# EAGLE board hw_DAA (EAGLE 7.6.0), part 1 of 9
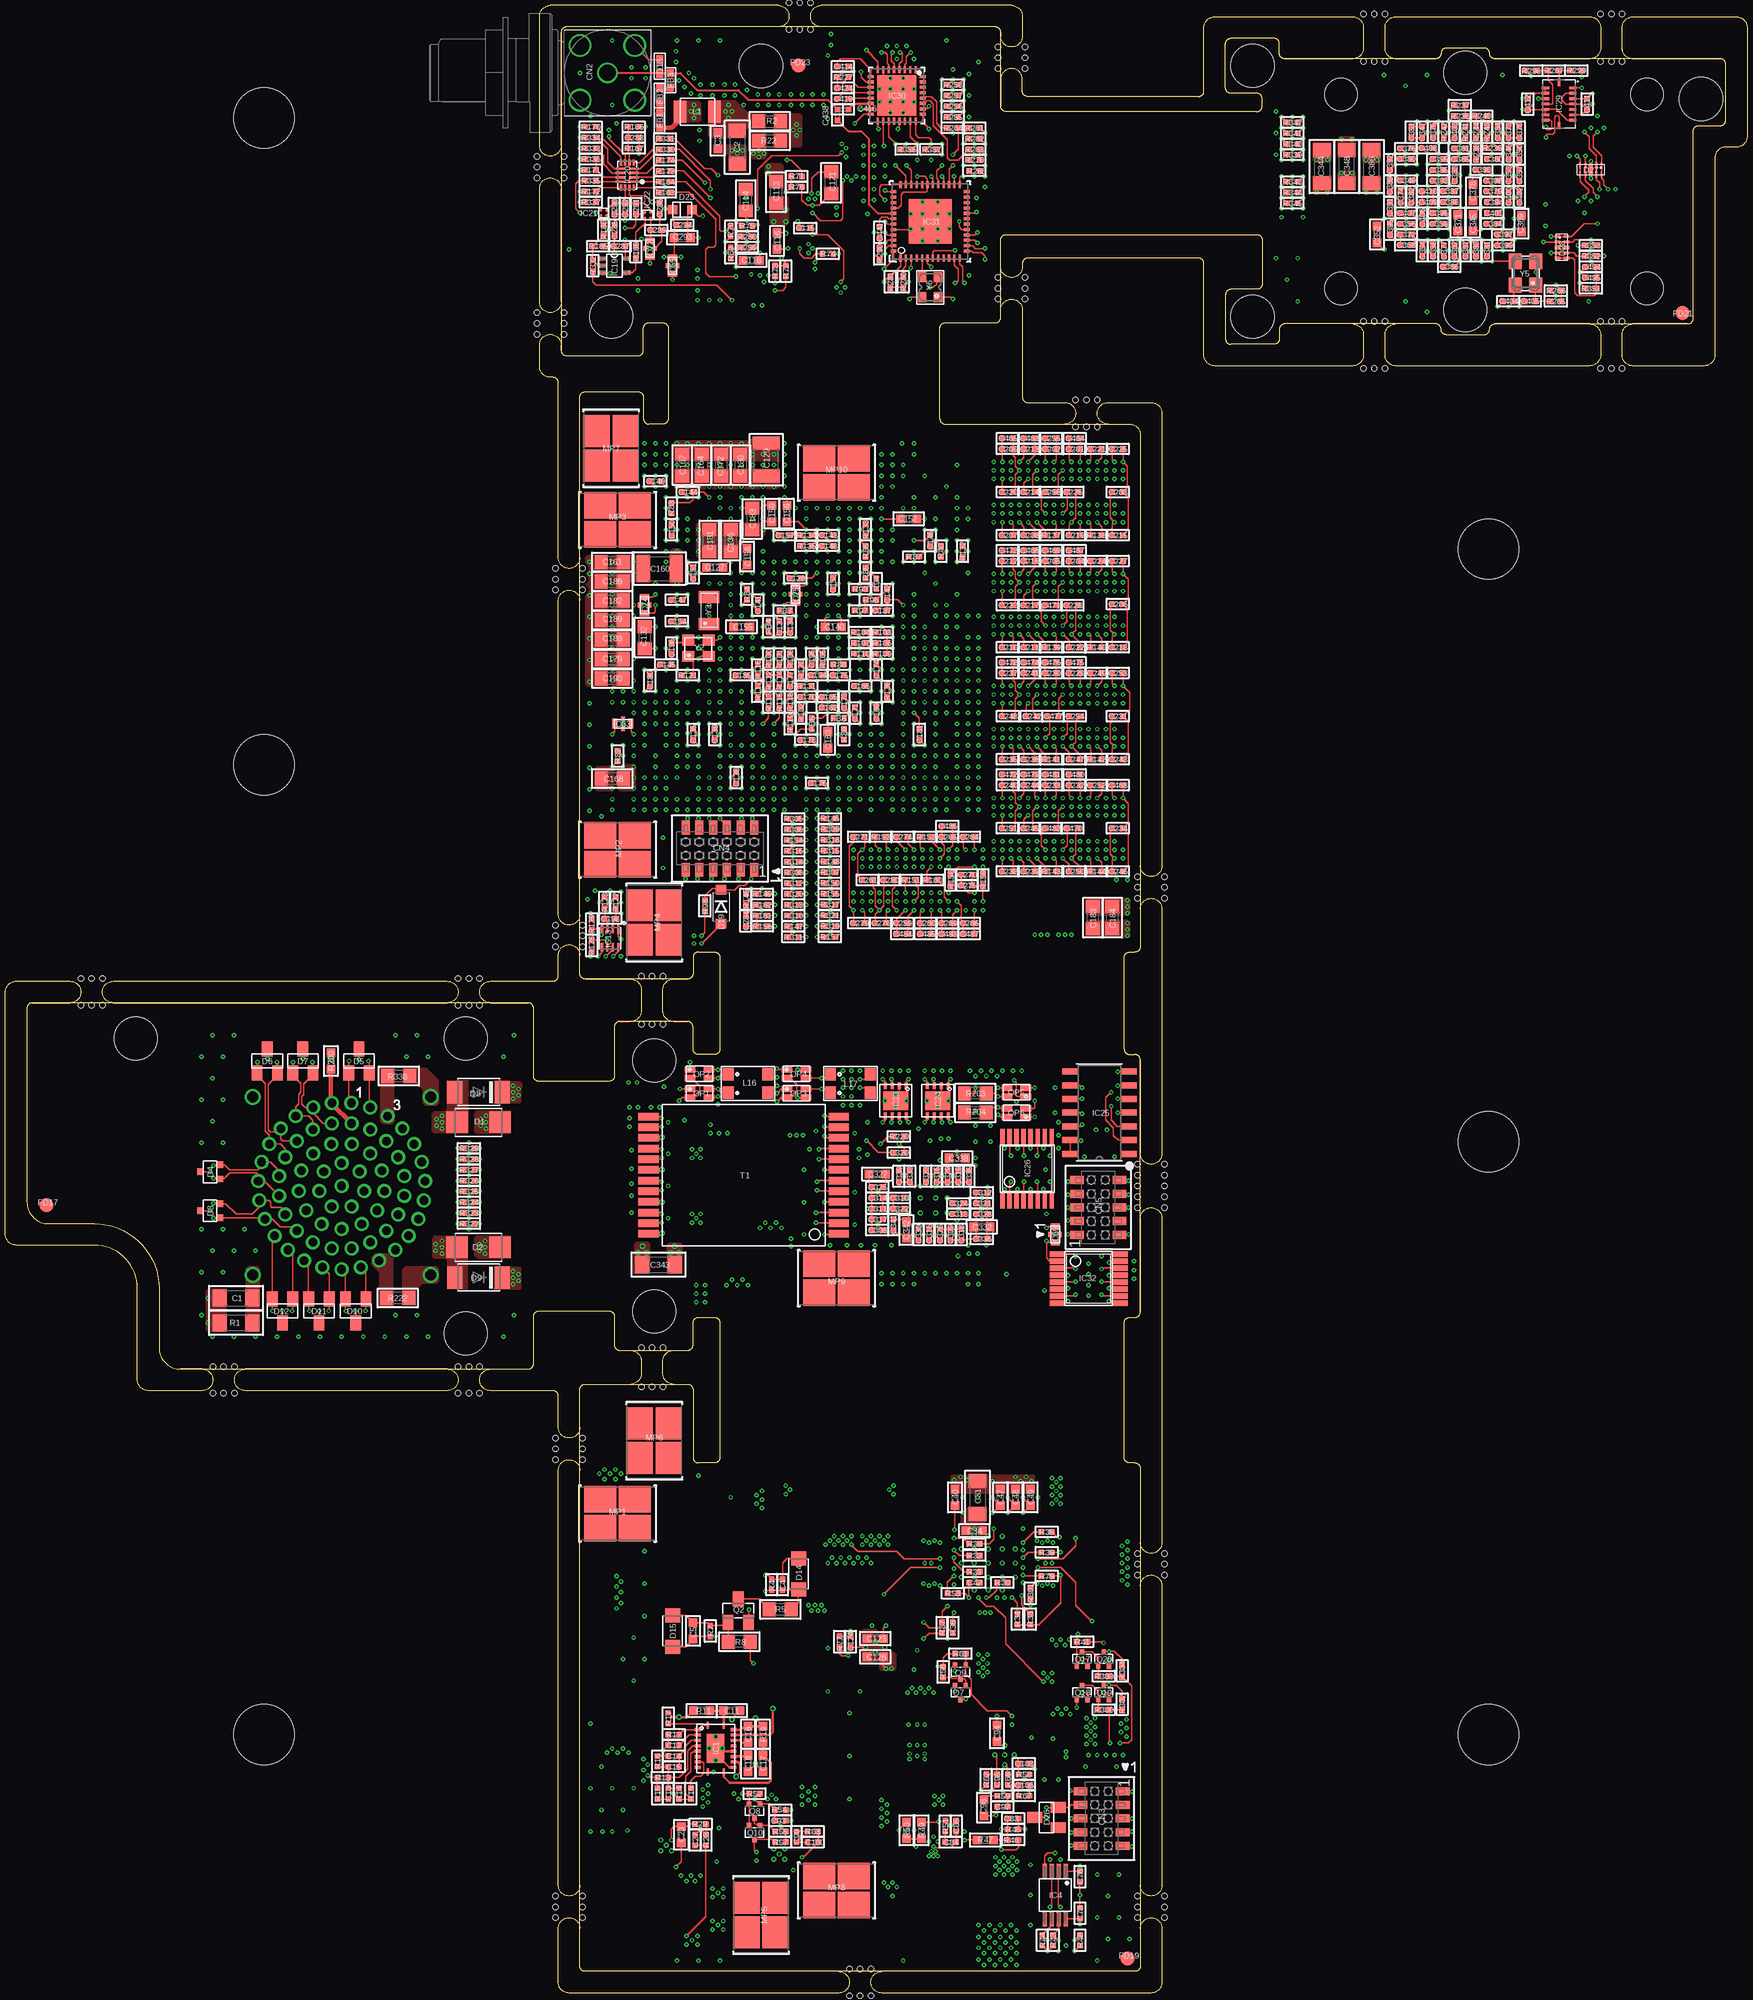
[diagram p34: board, top side]
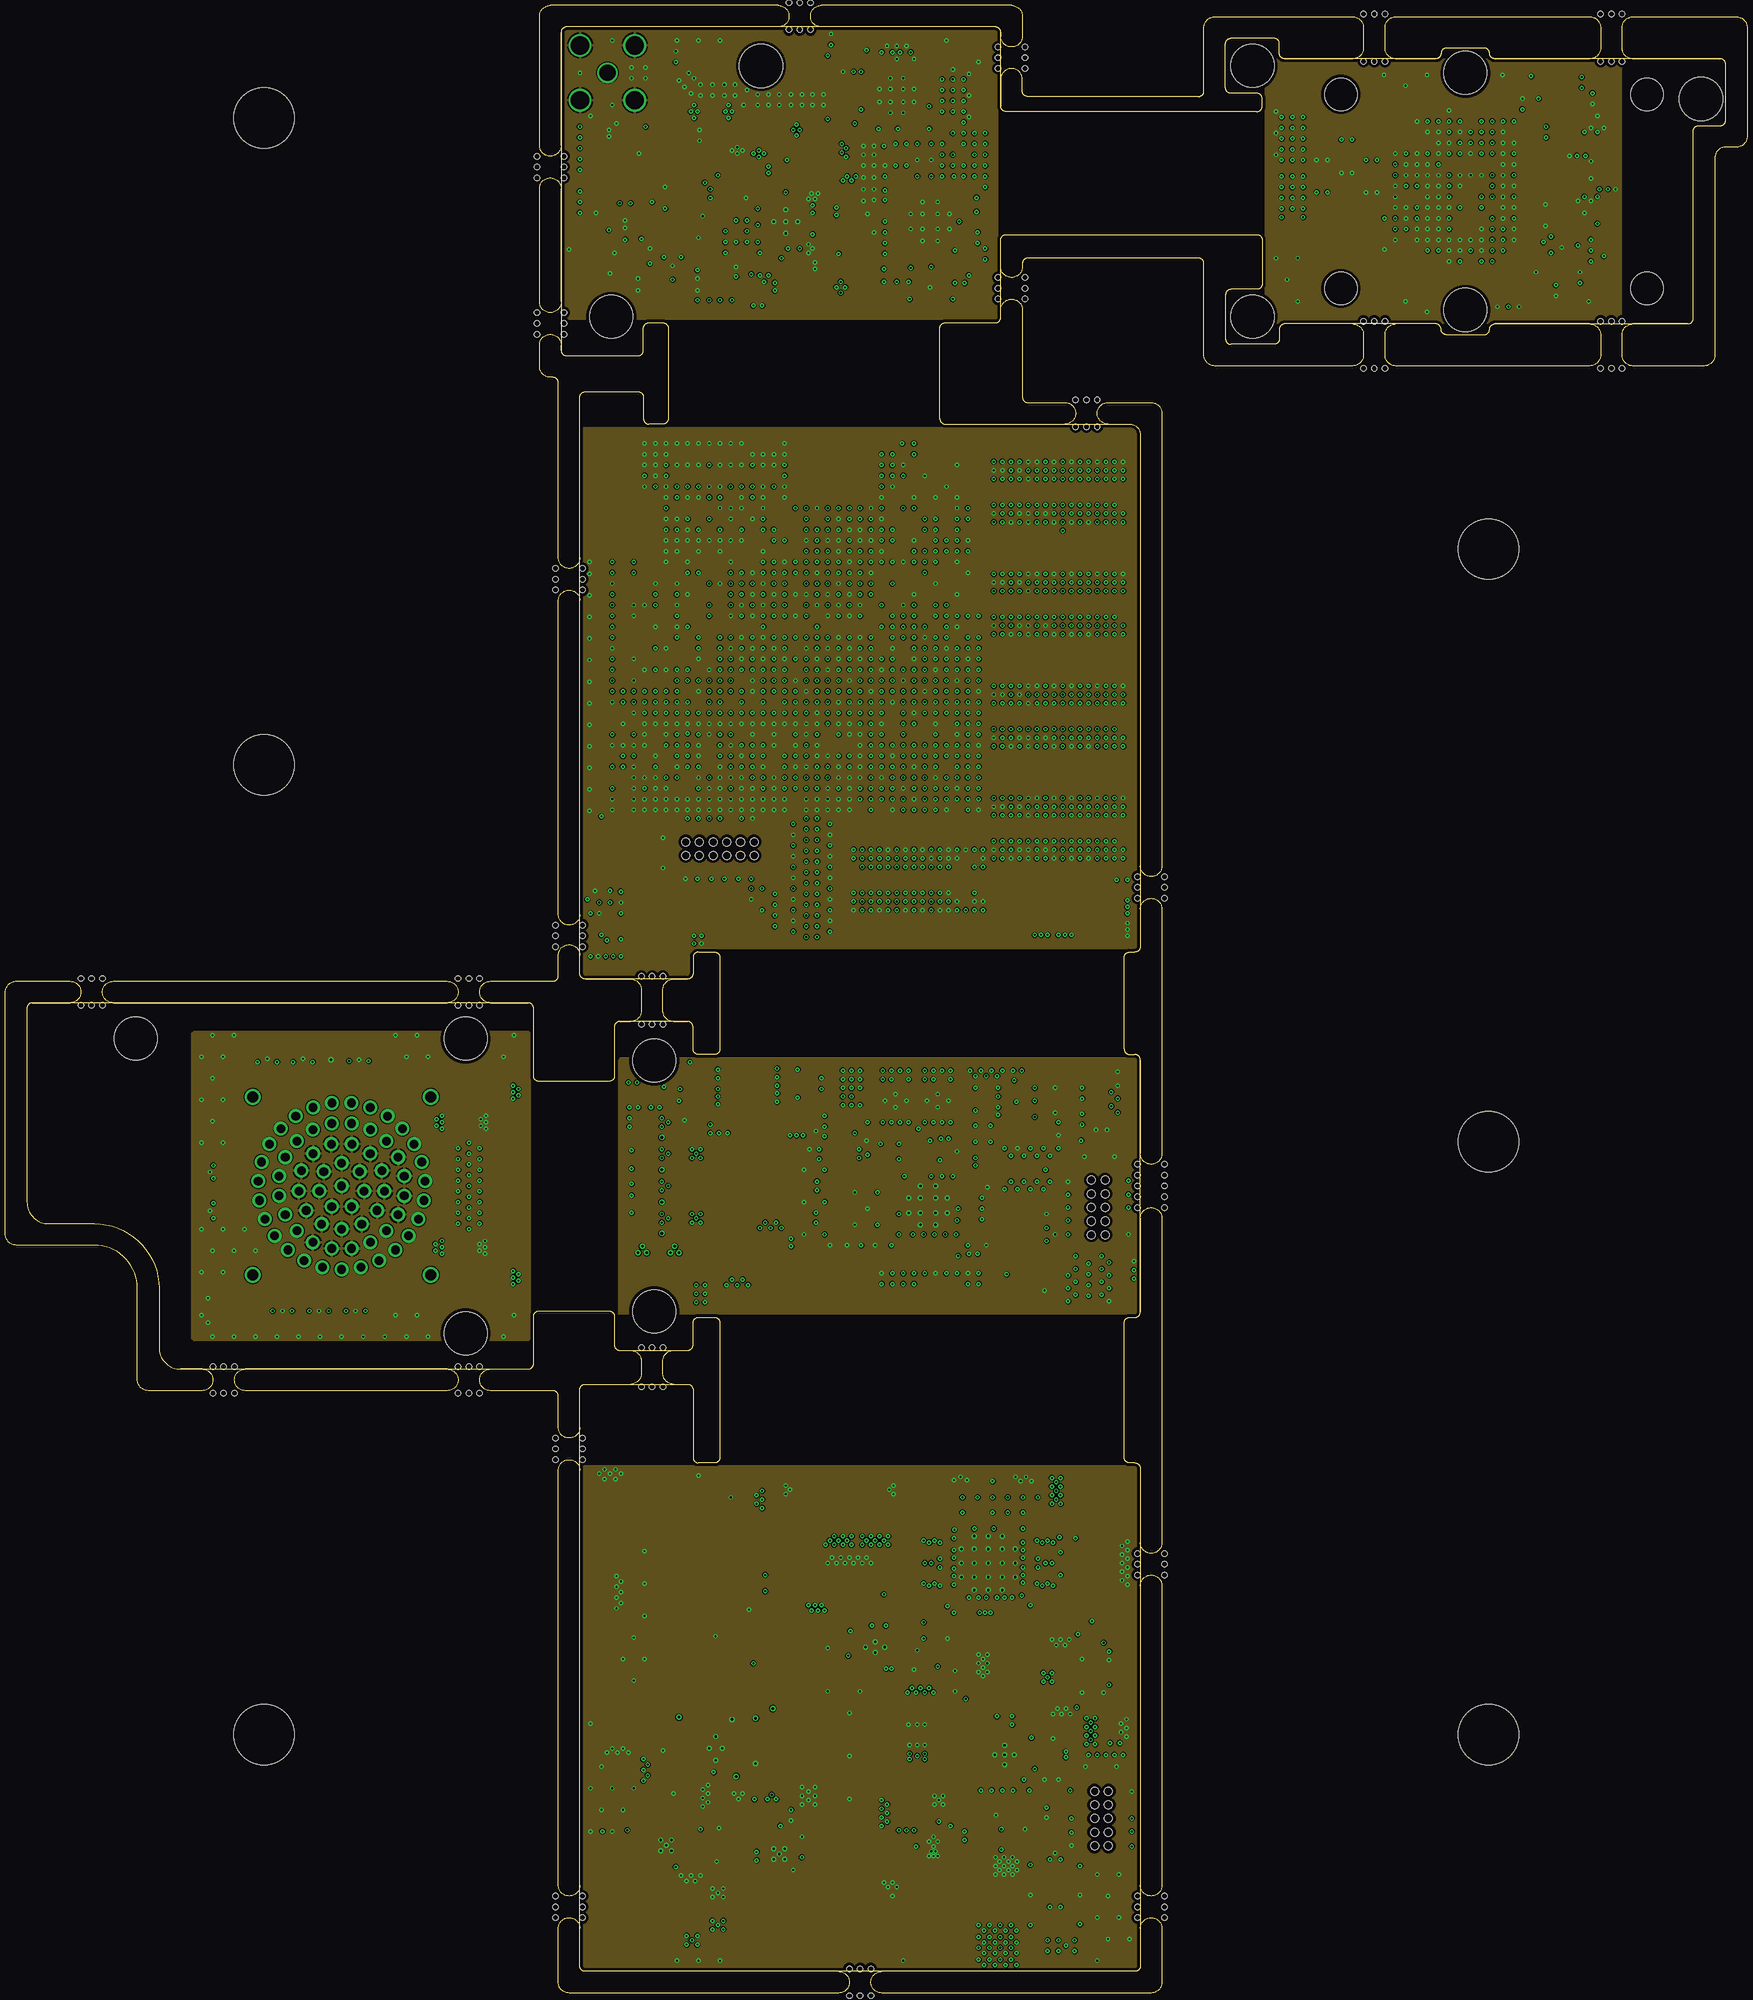
[diagram p35: board, inner layer GND2]
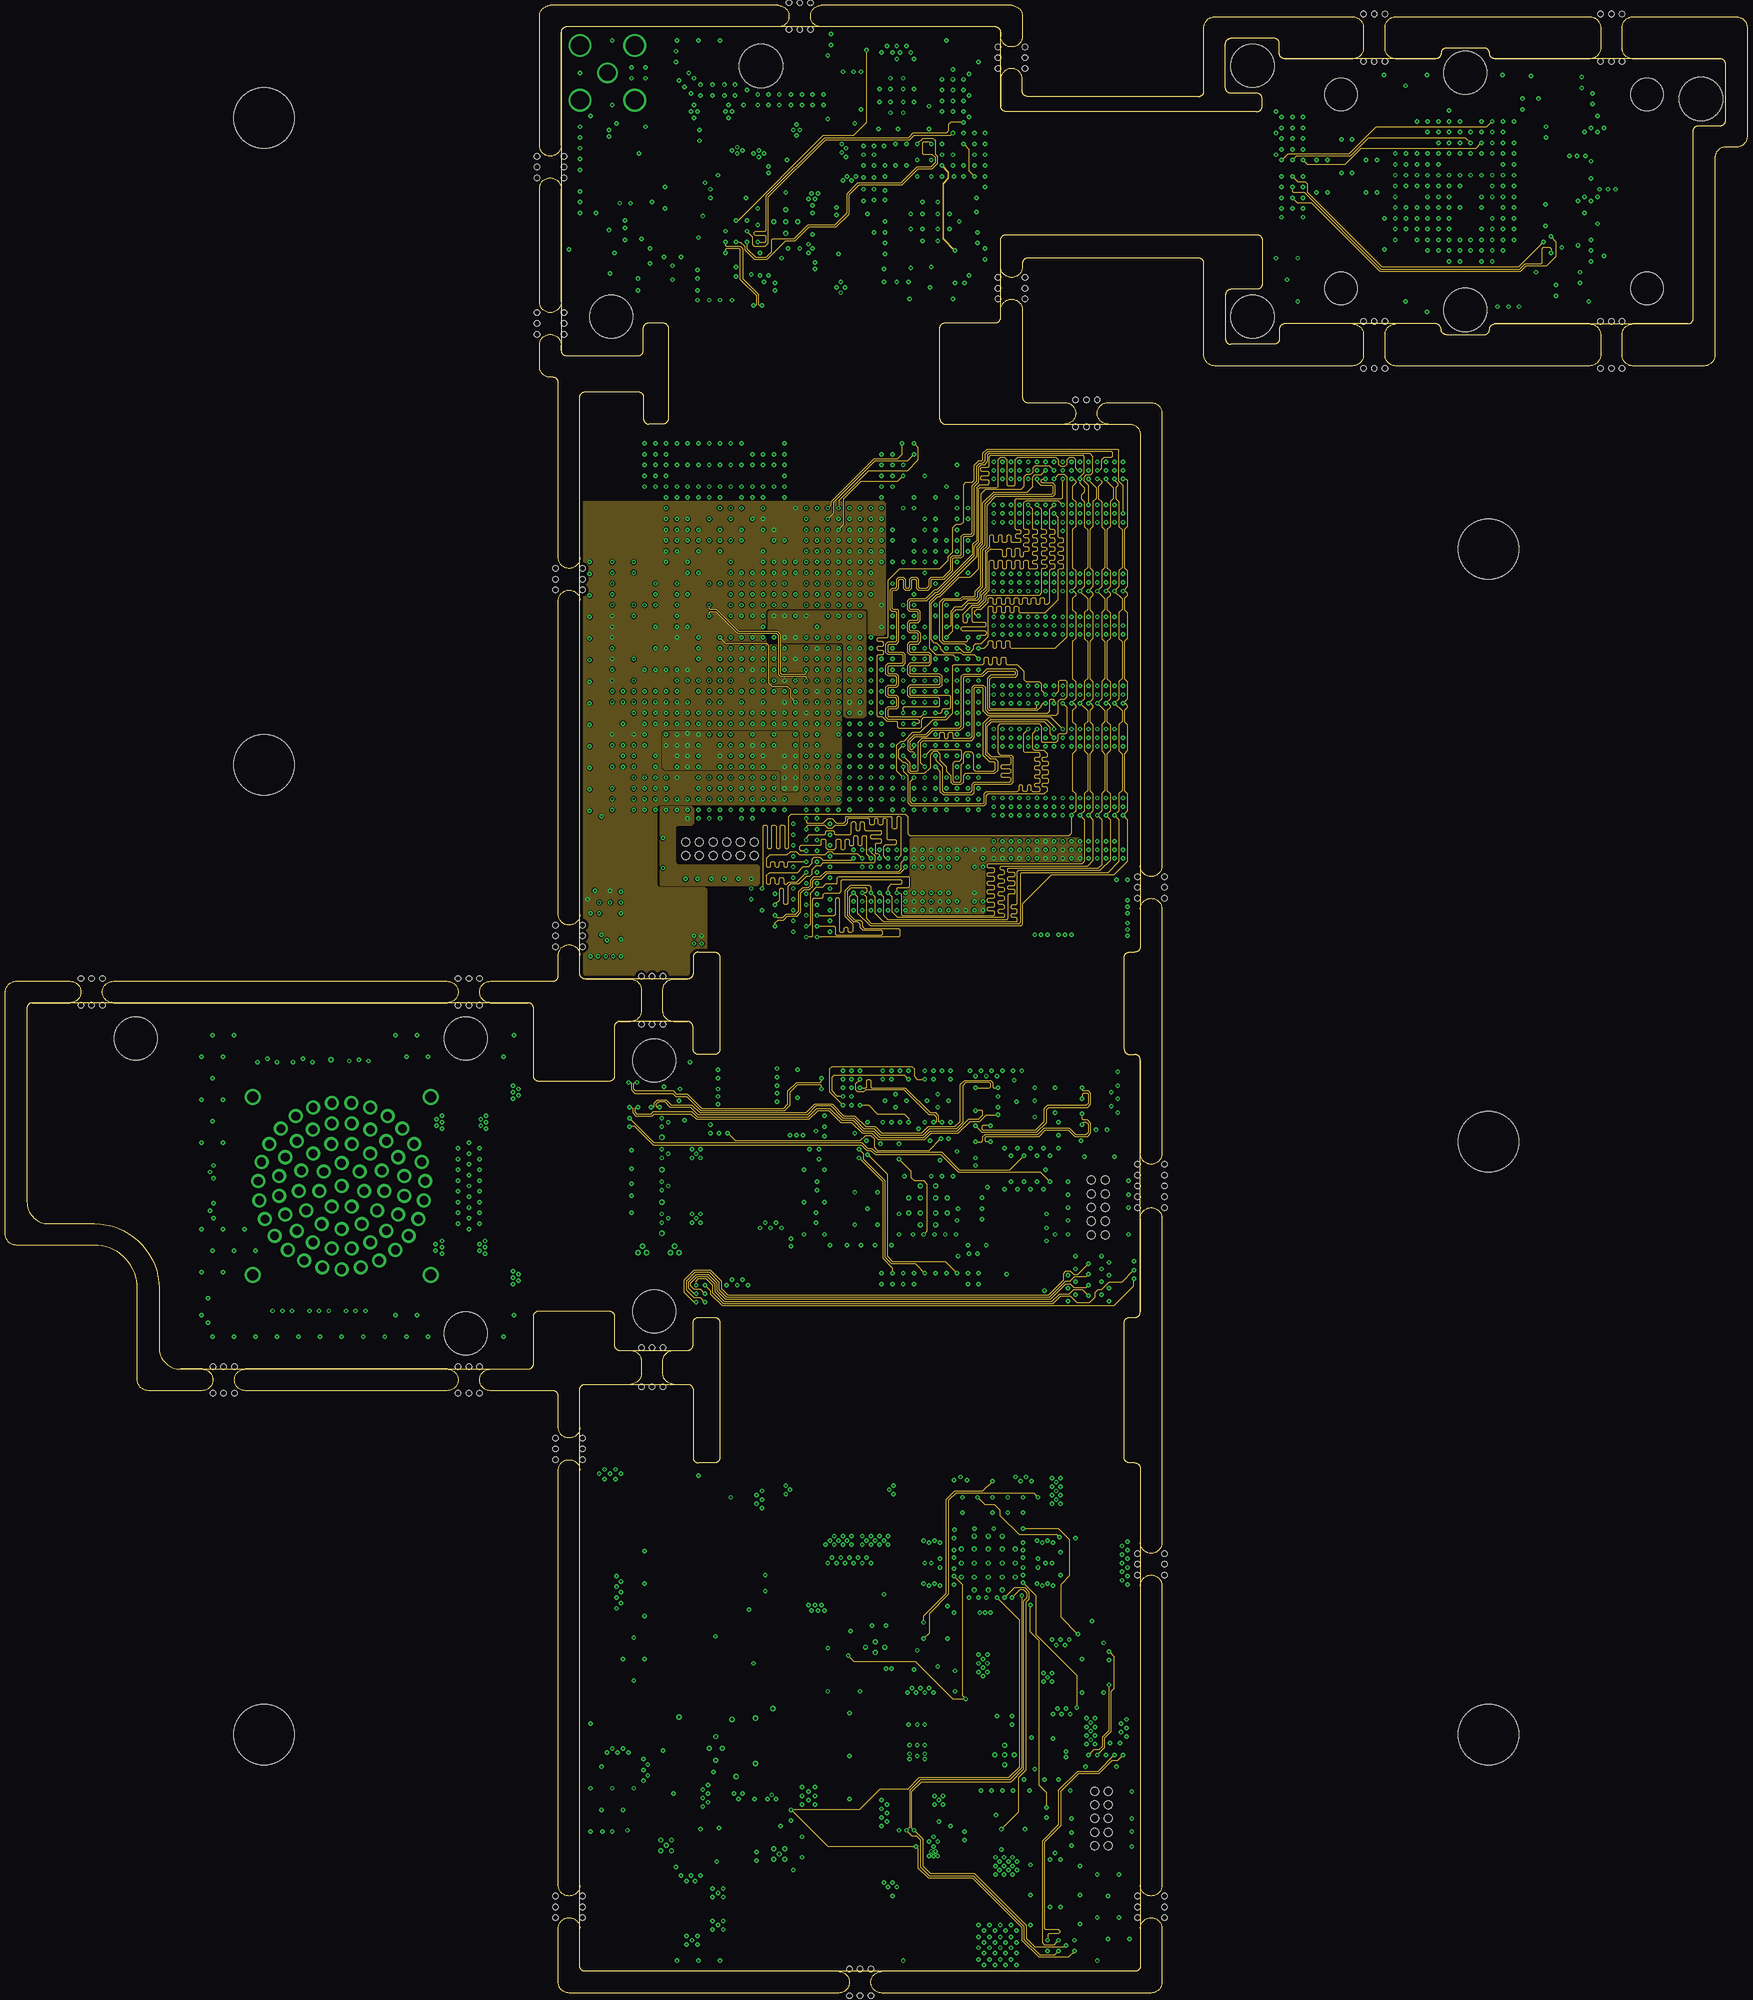
[diagram p36: board, inner layer SIG3]
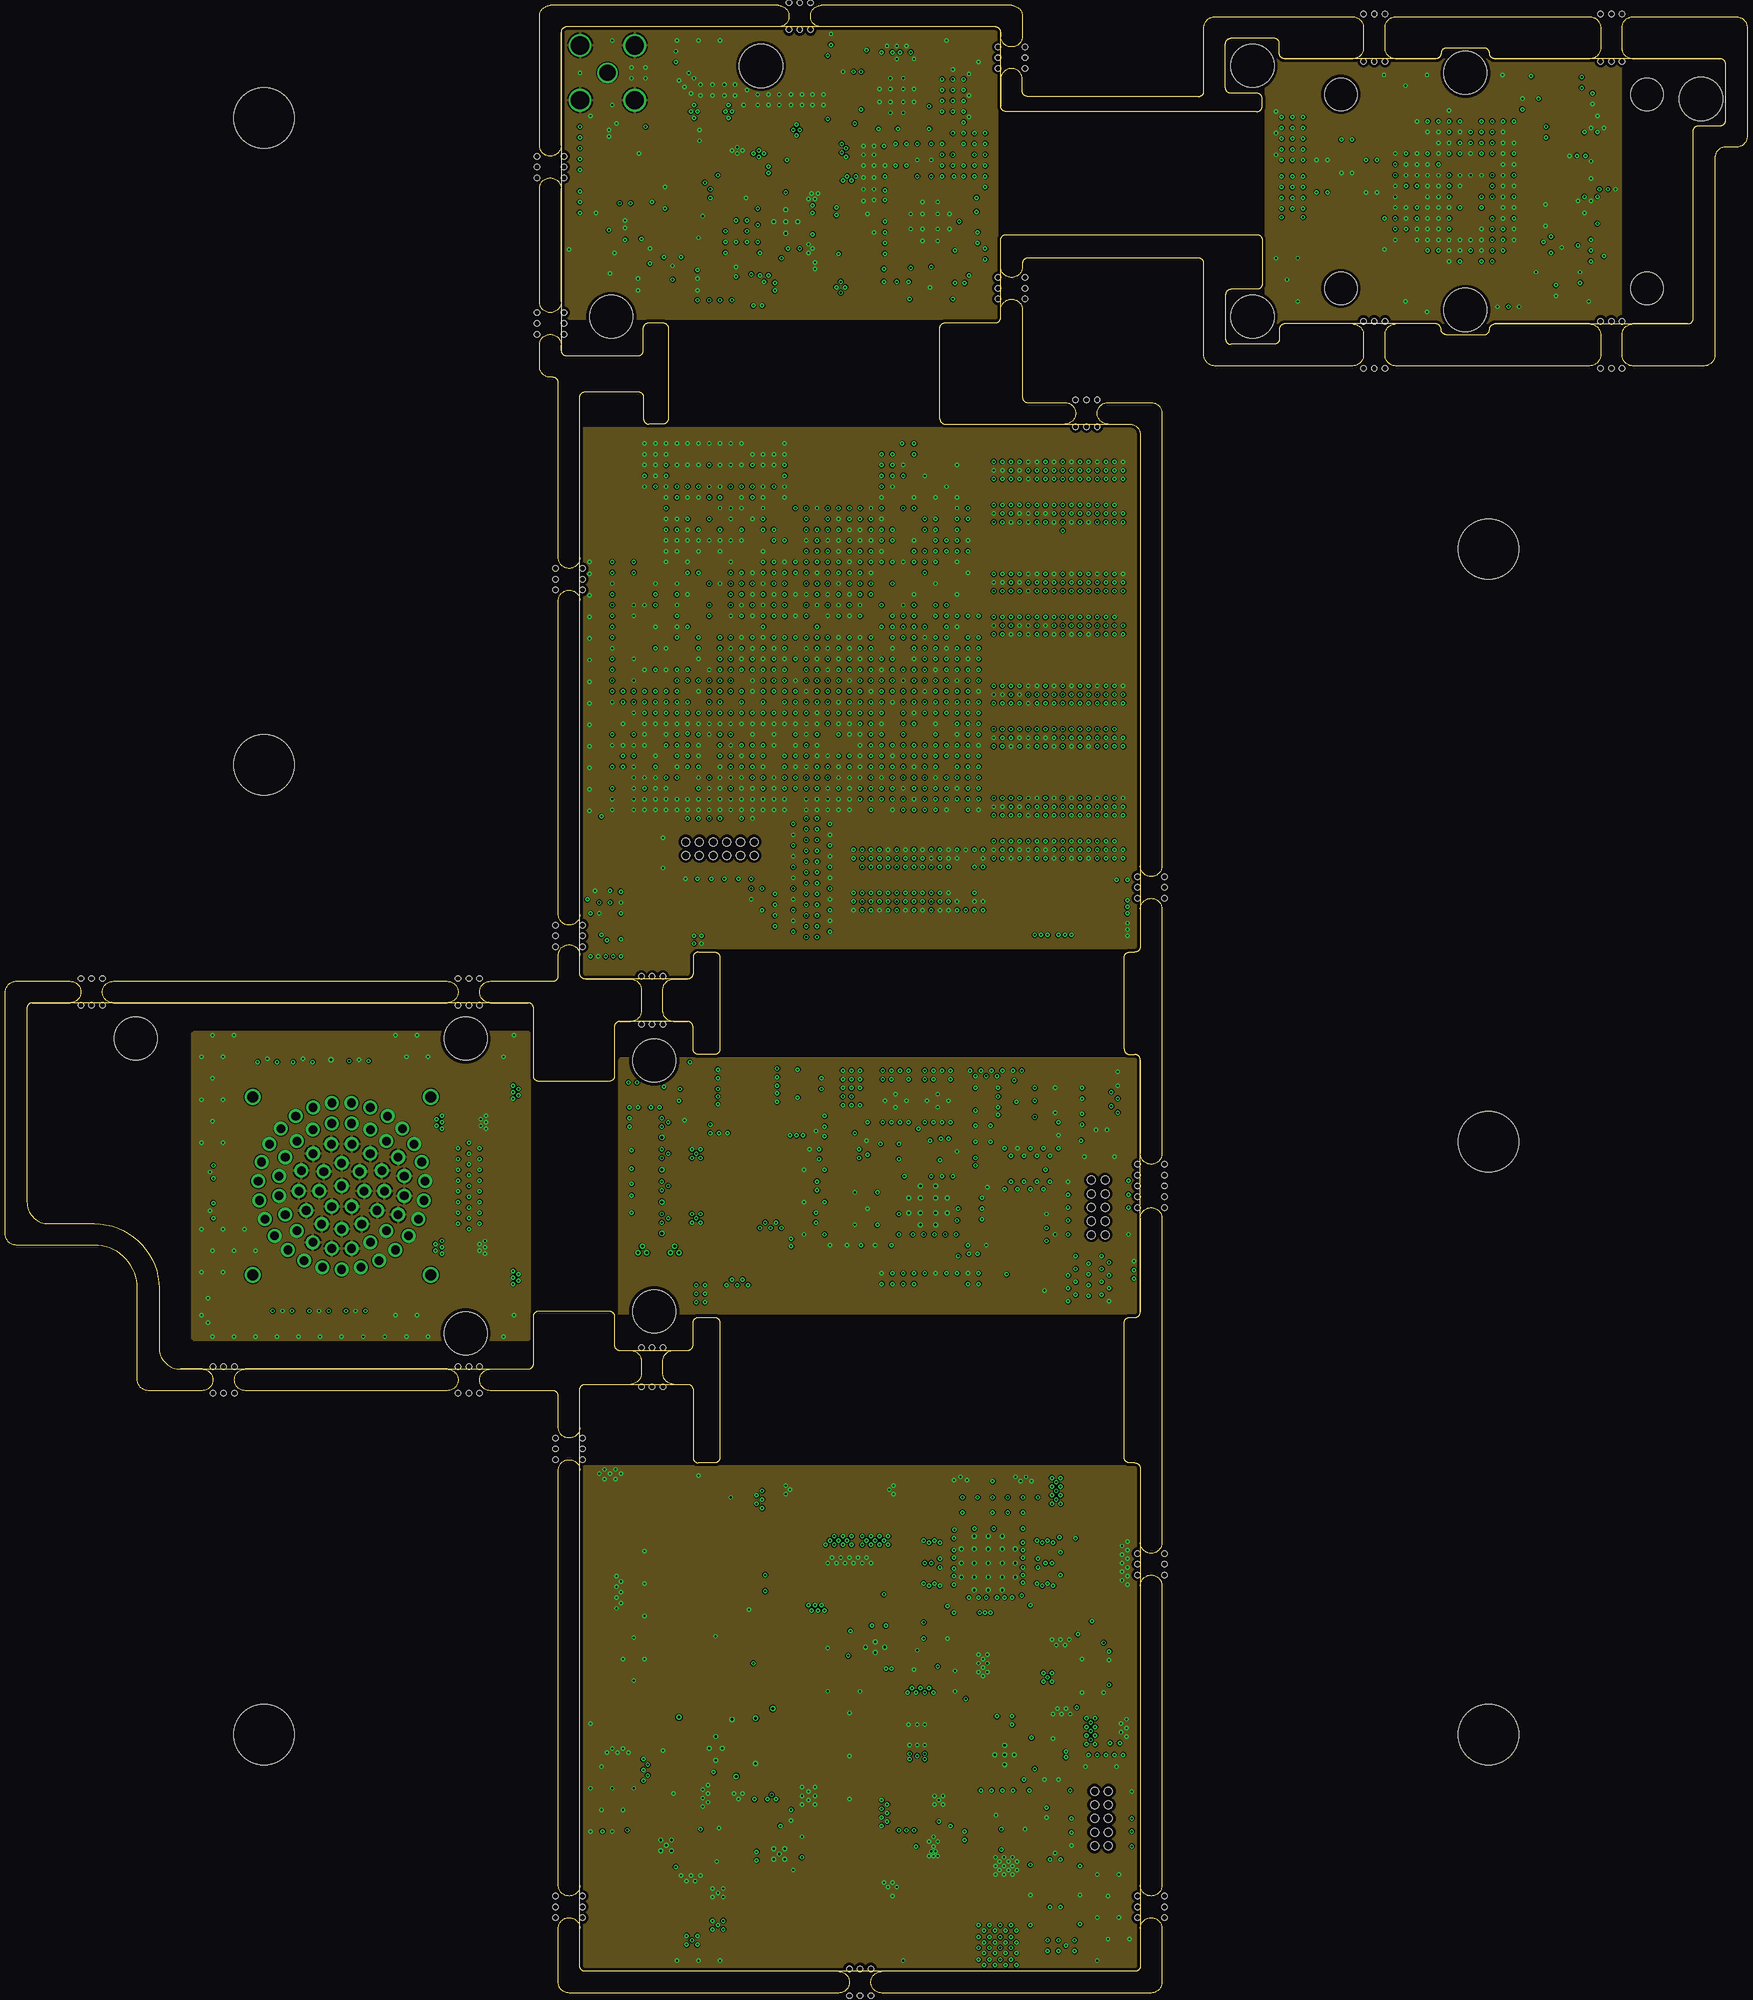
[diagram p37: board, inner layer GND4]
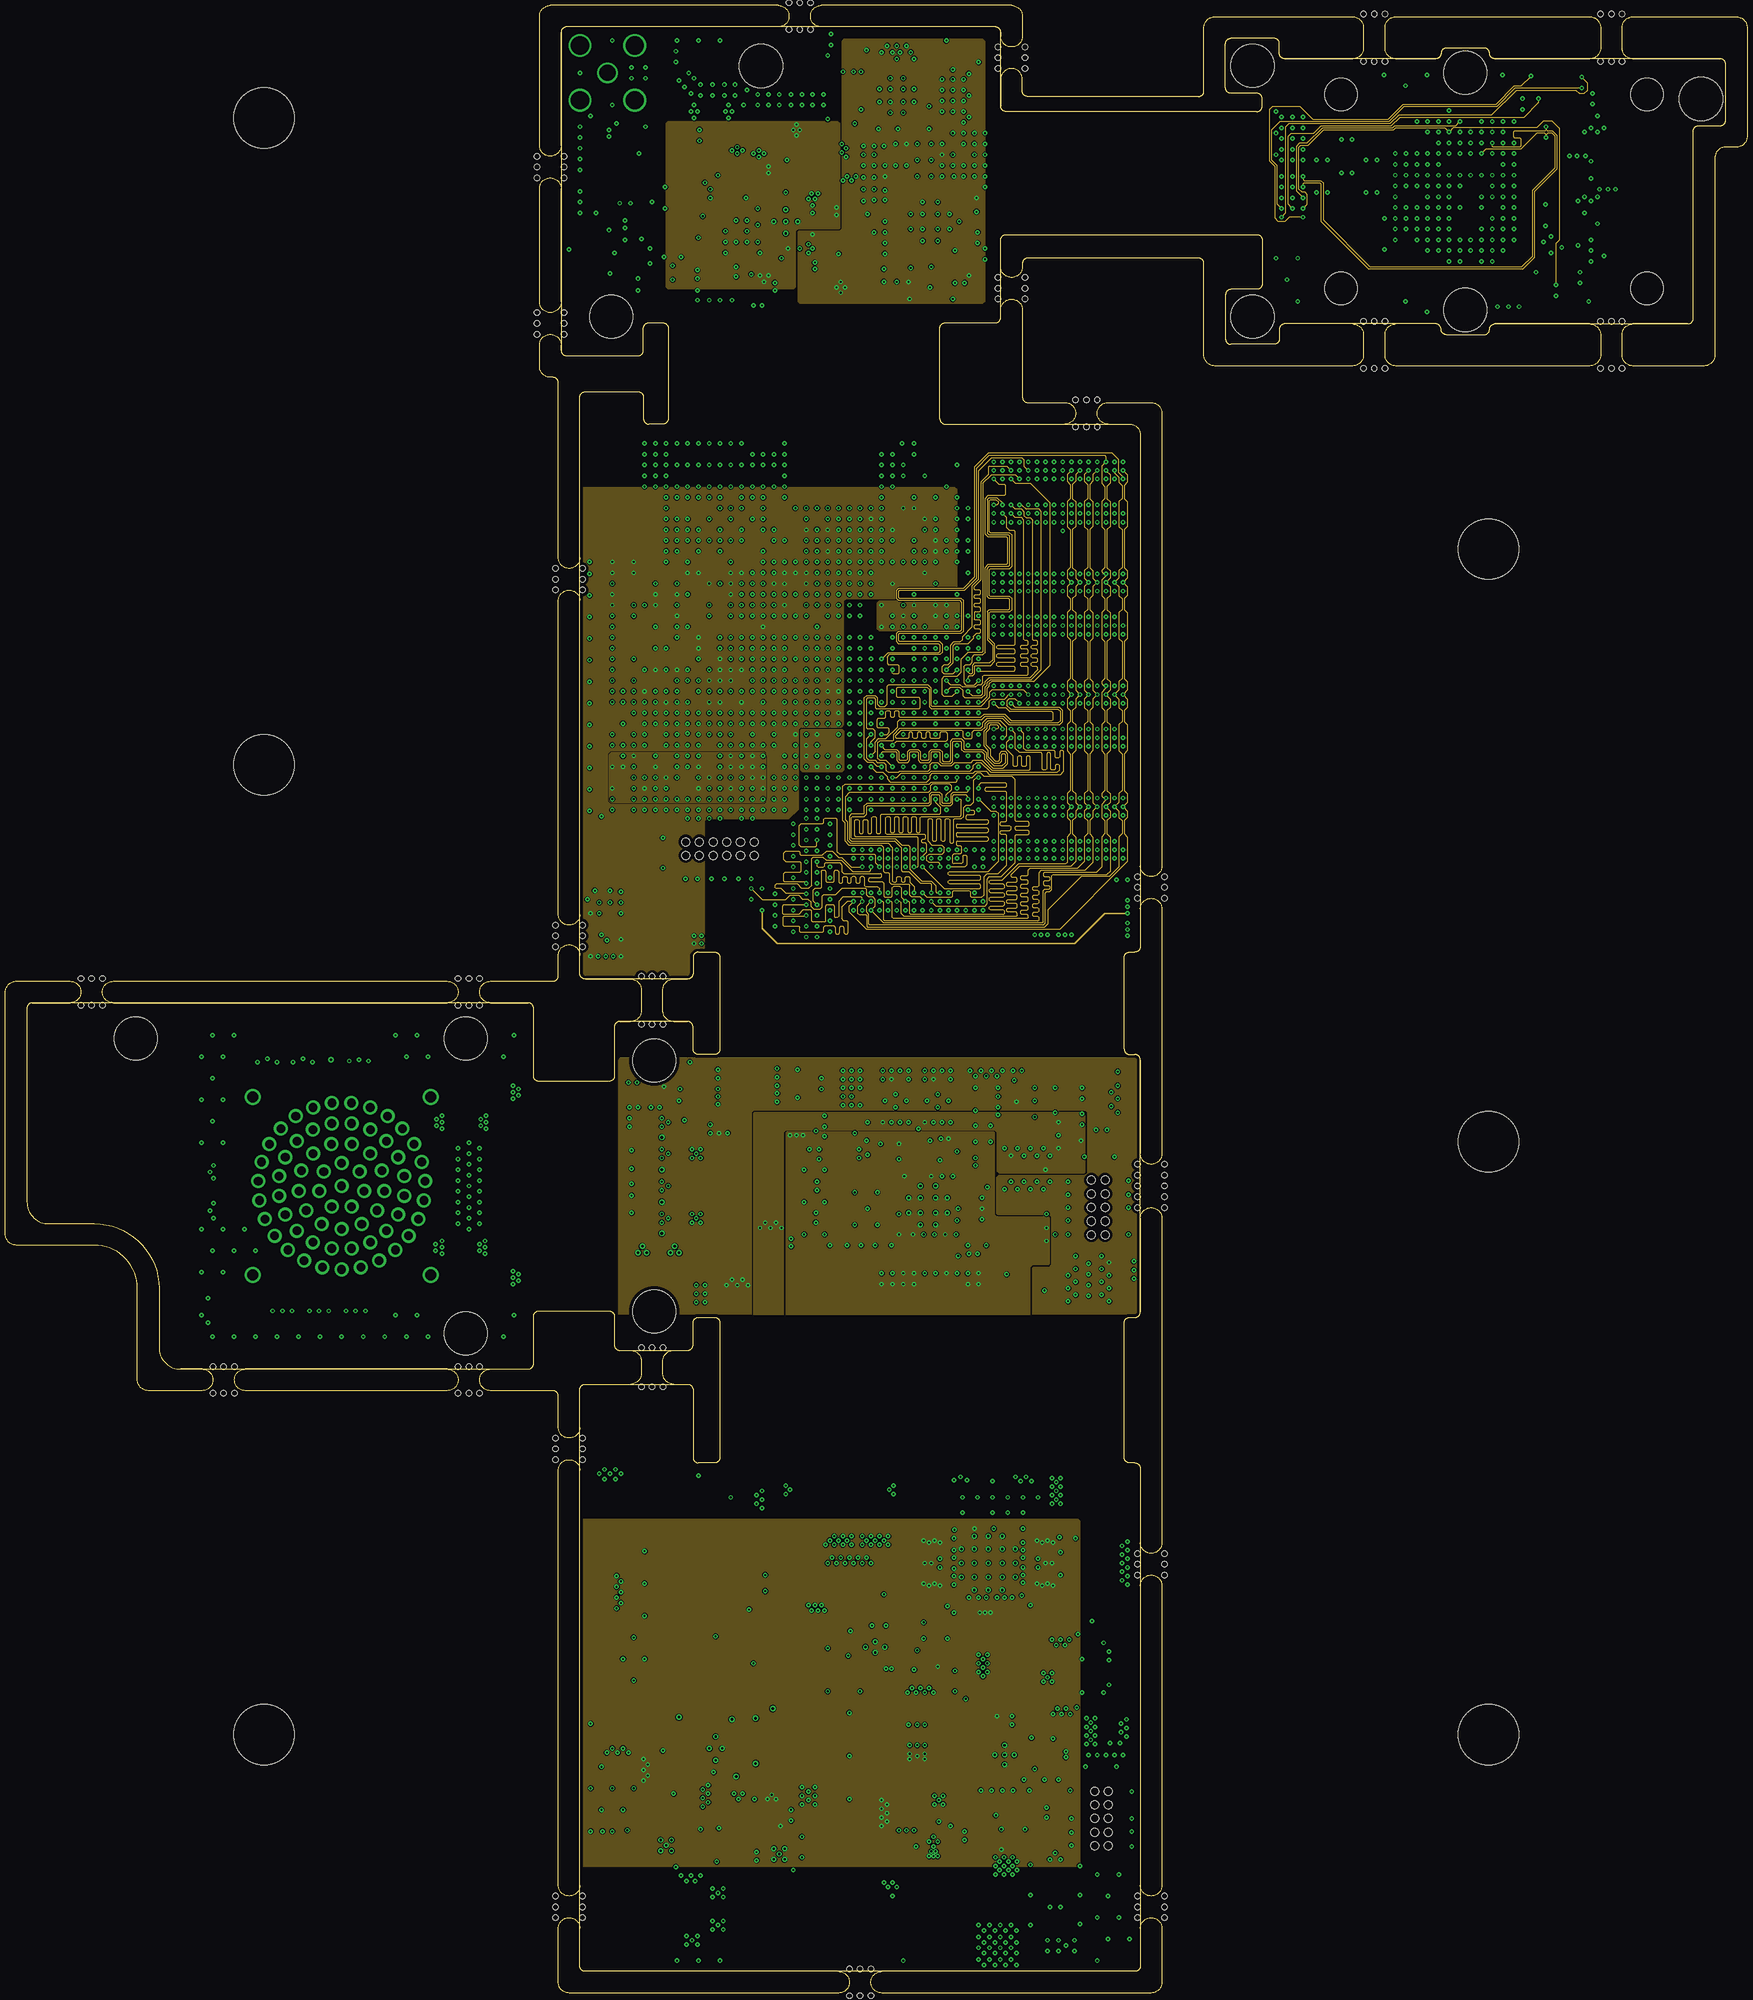
[diagram p38: board, inner layer SIG5]
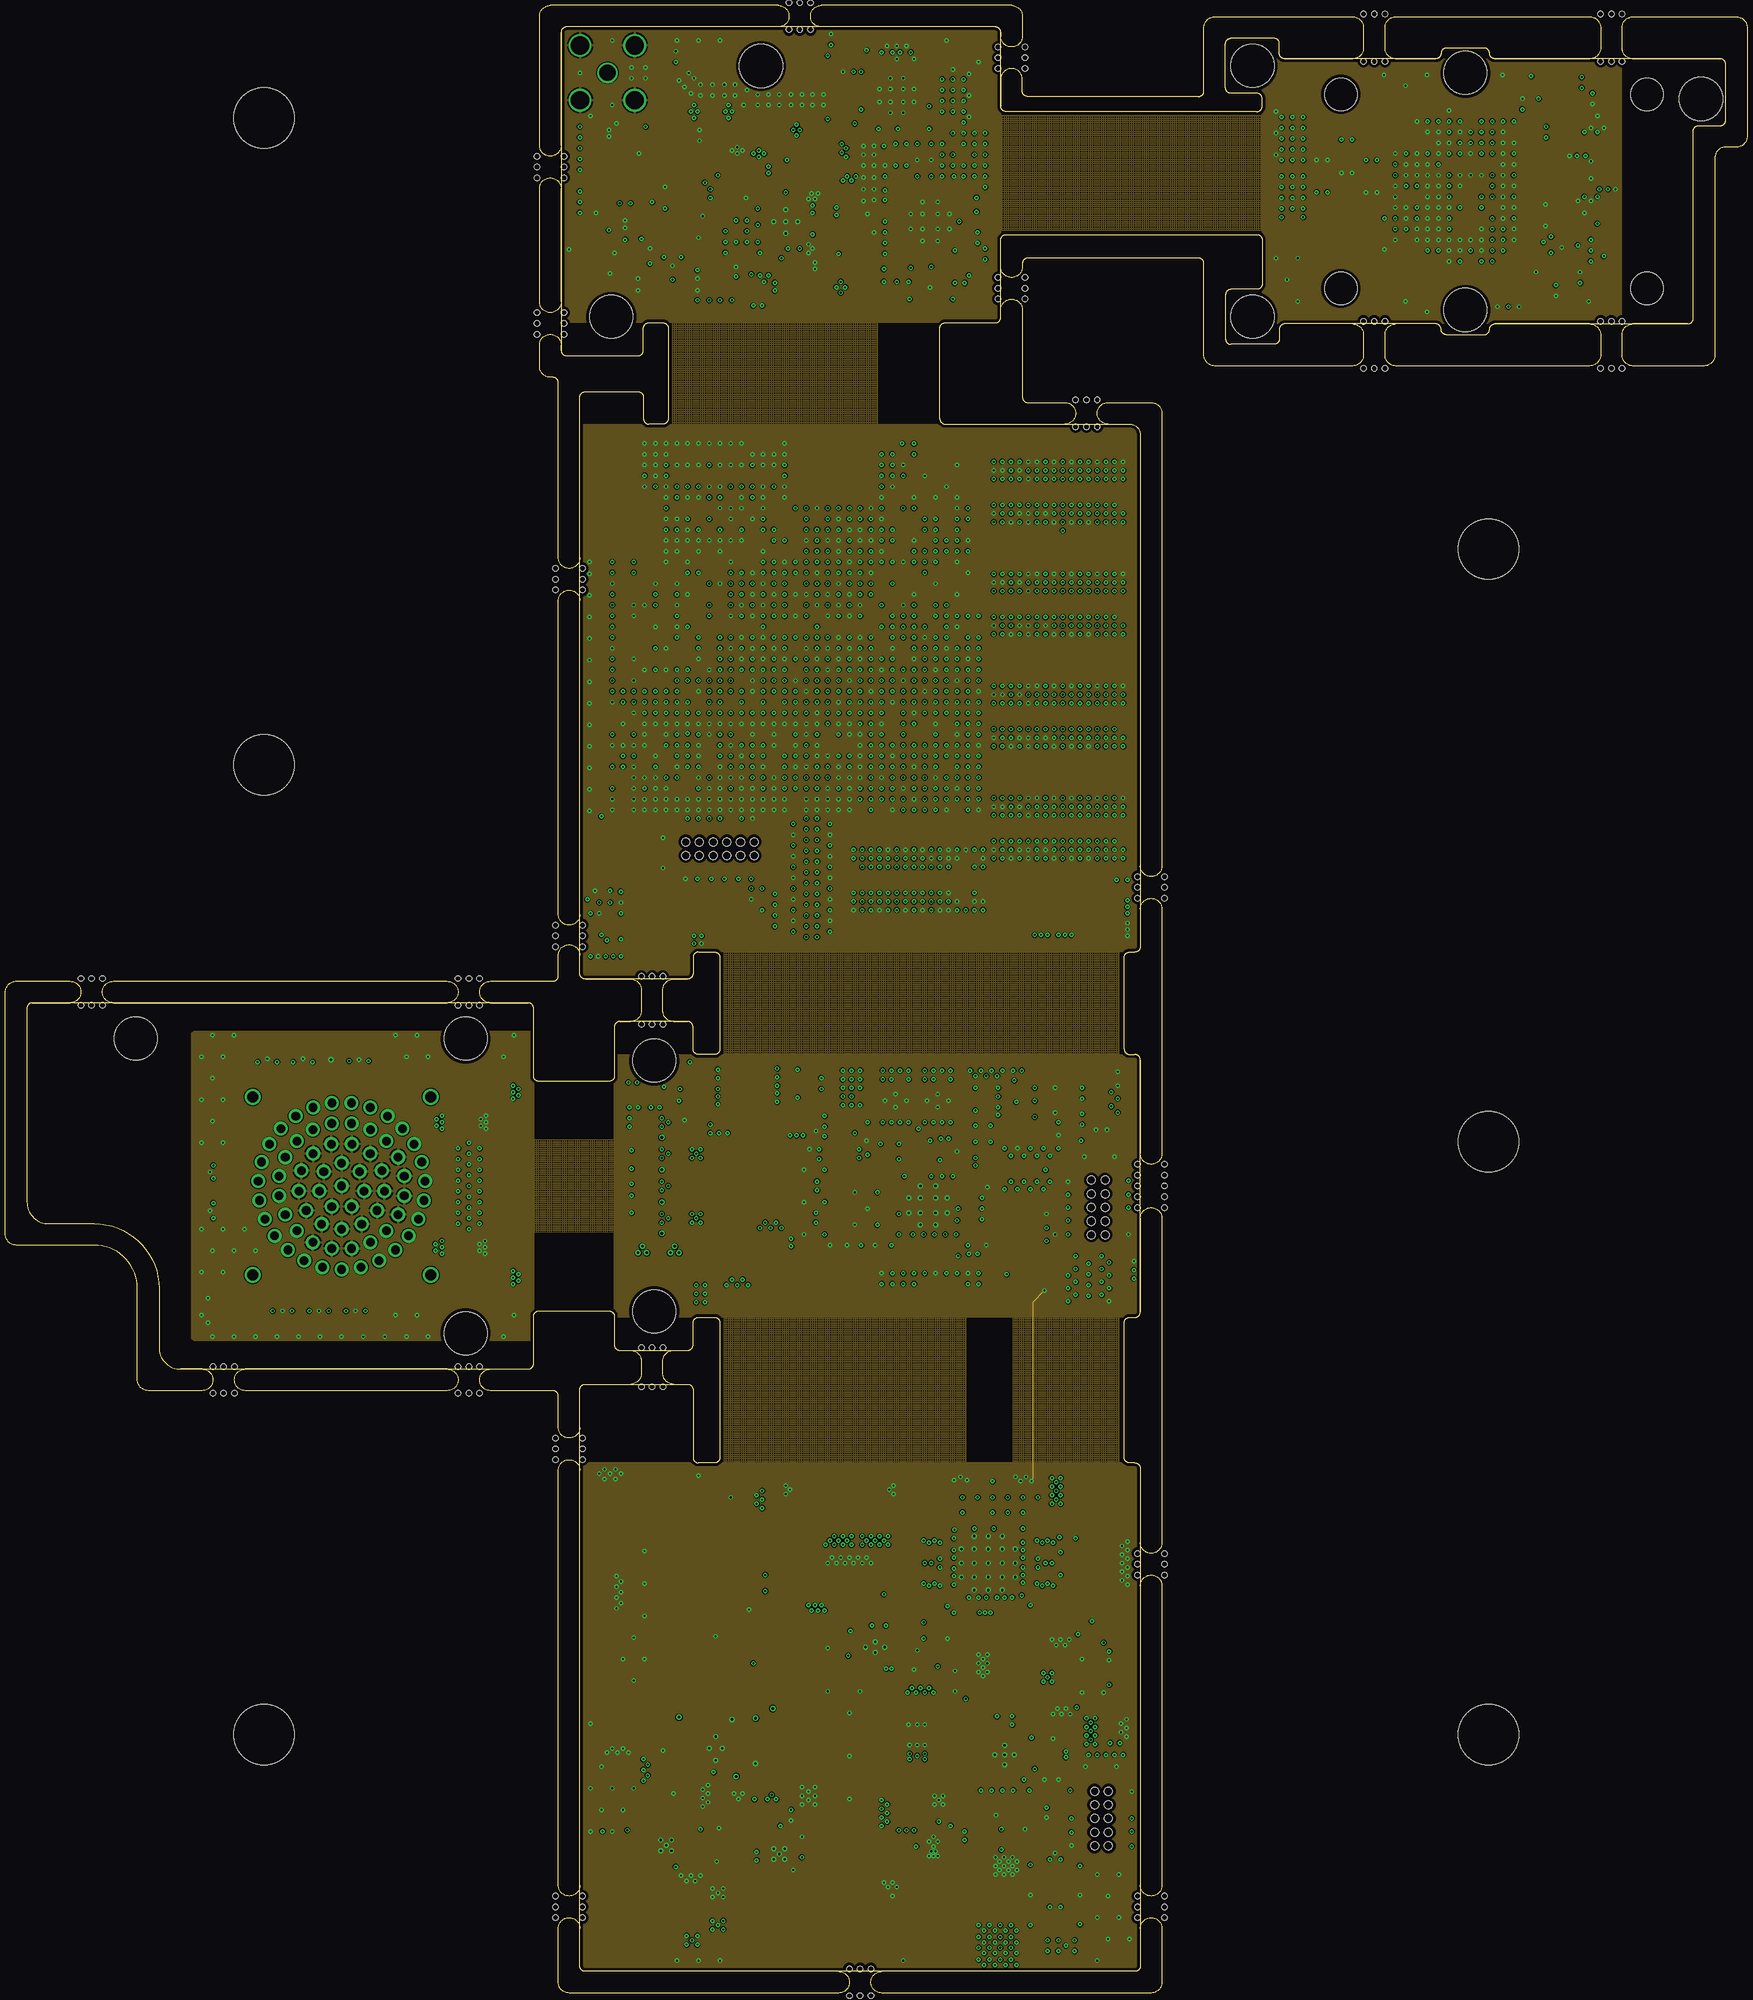
[diagram p39: board, inner layer GND6]
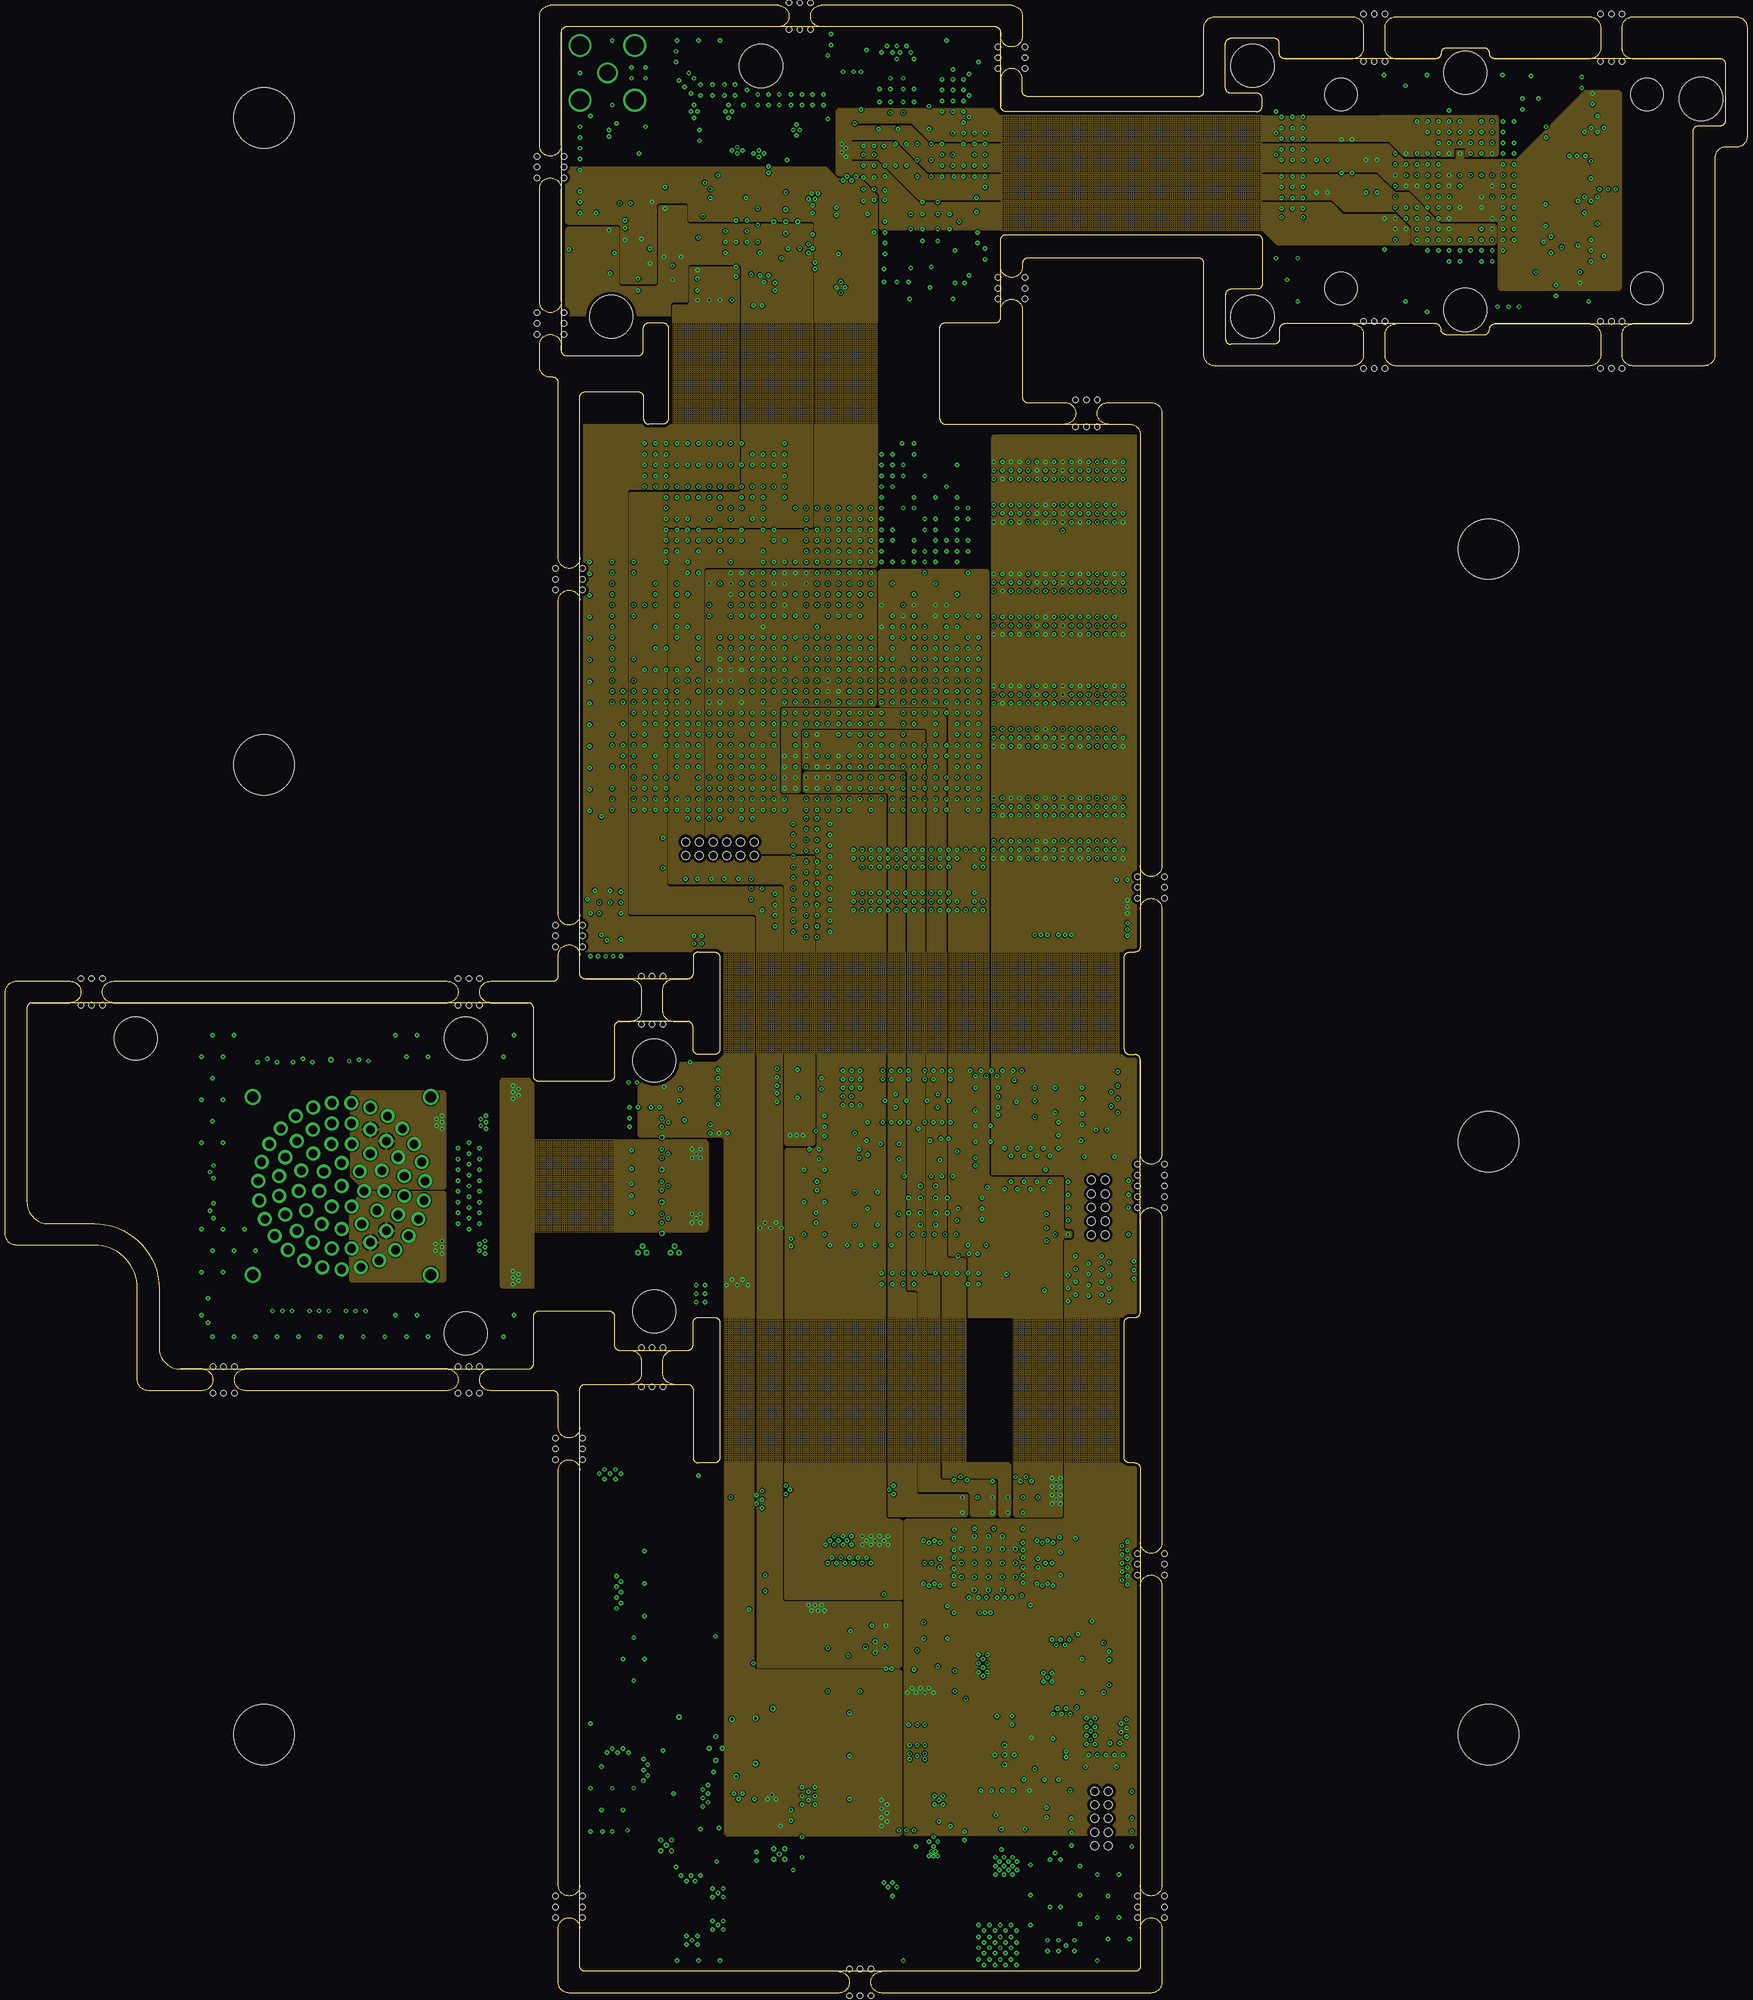
[diagram p40: board, inner layer PWR7]
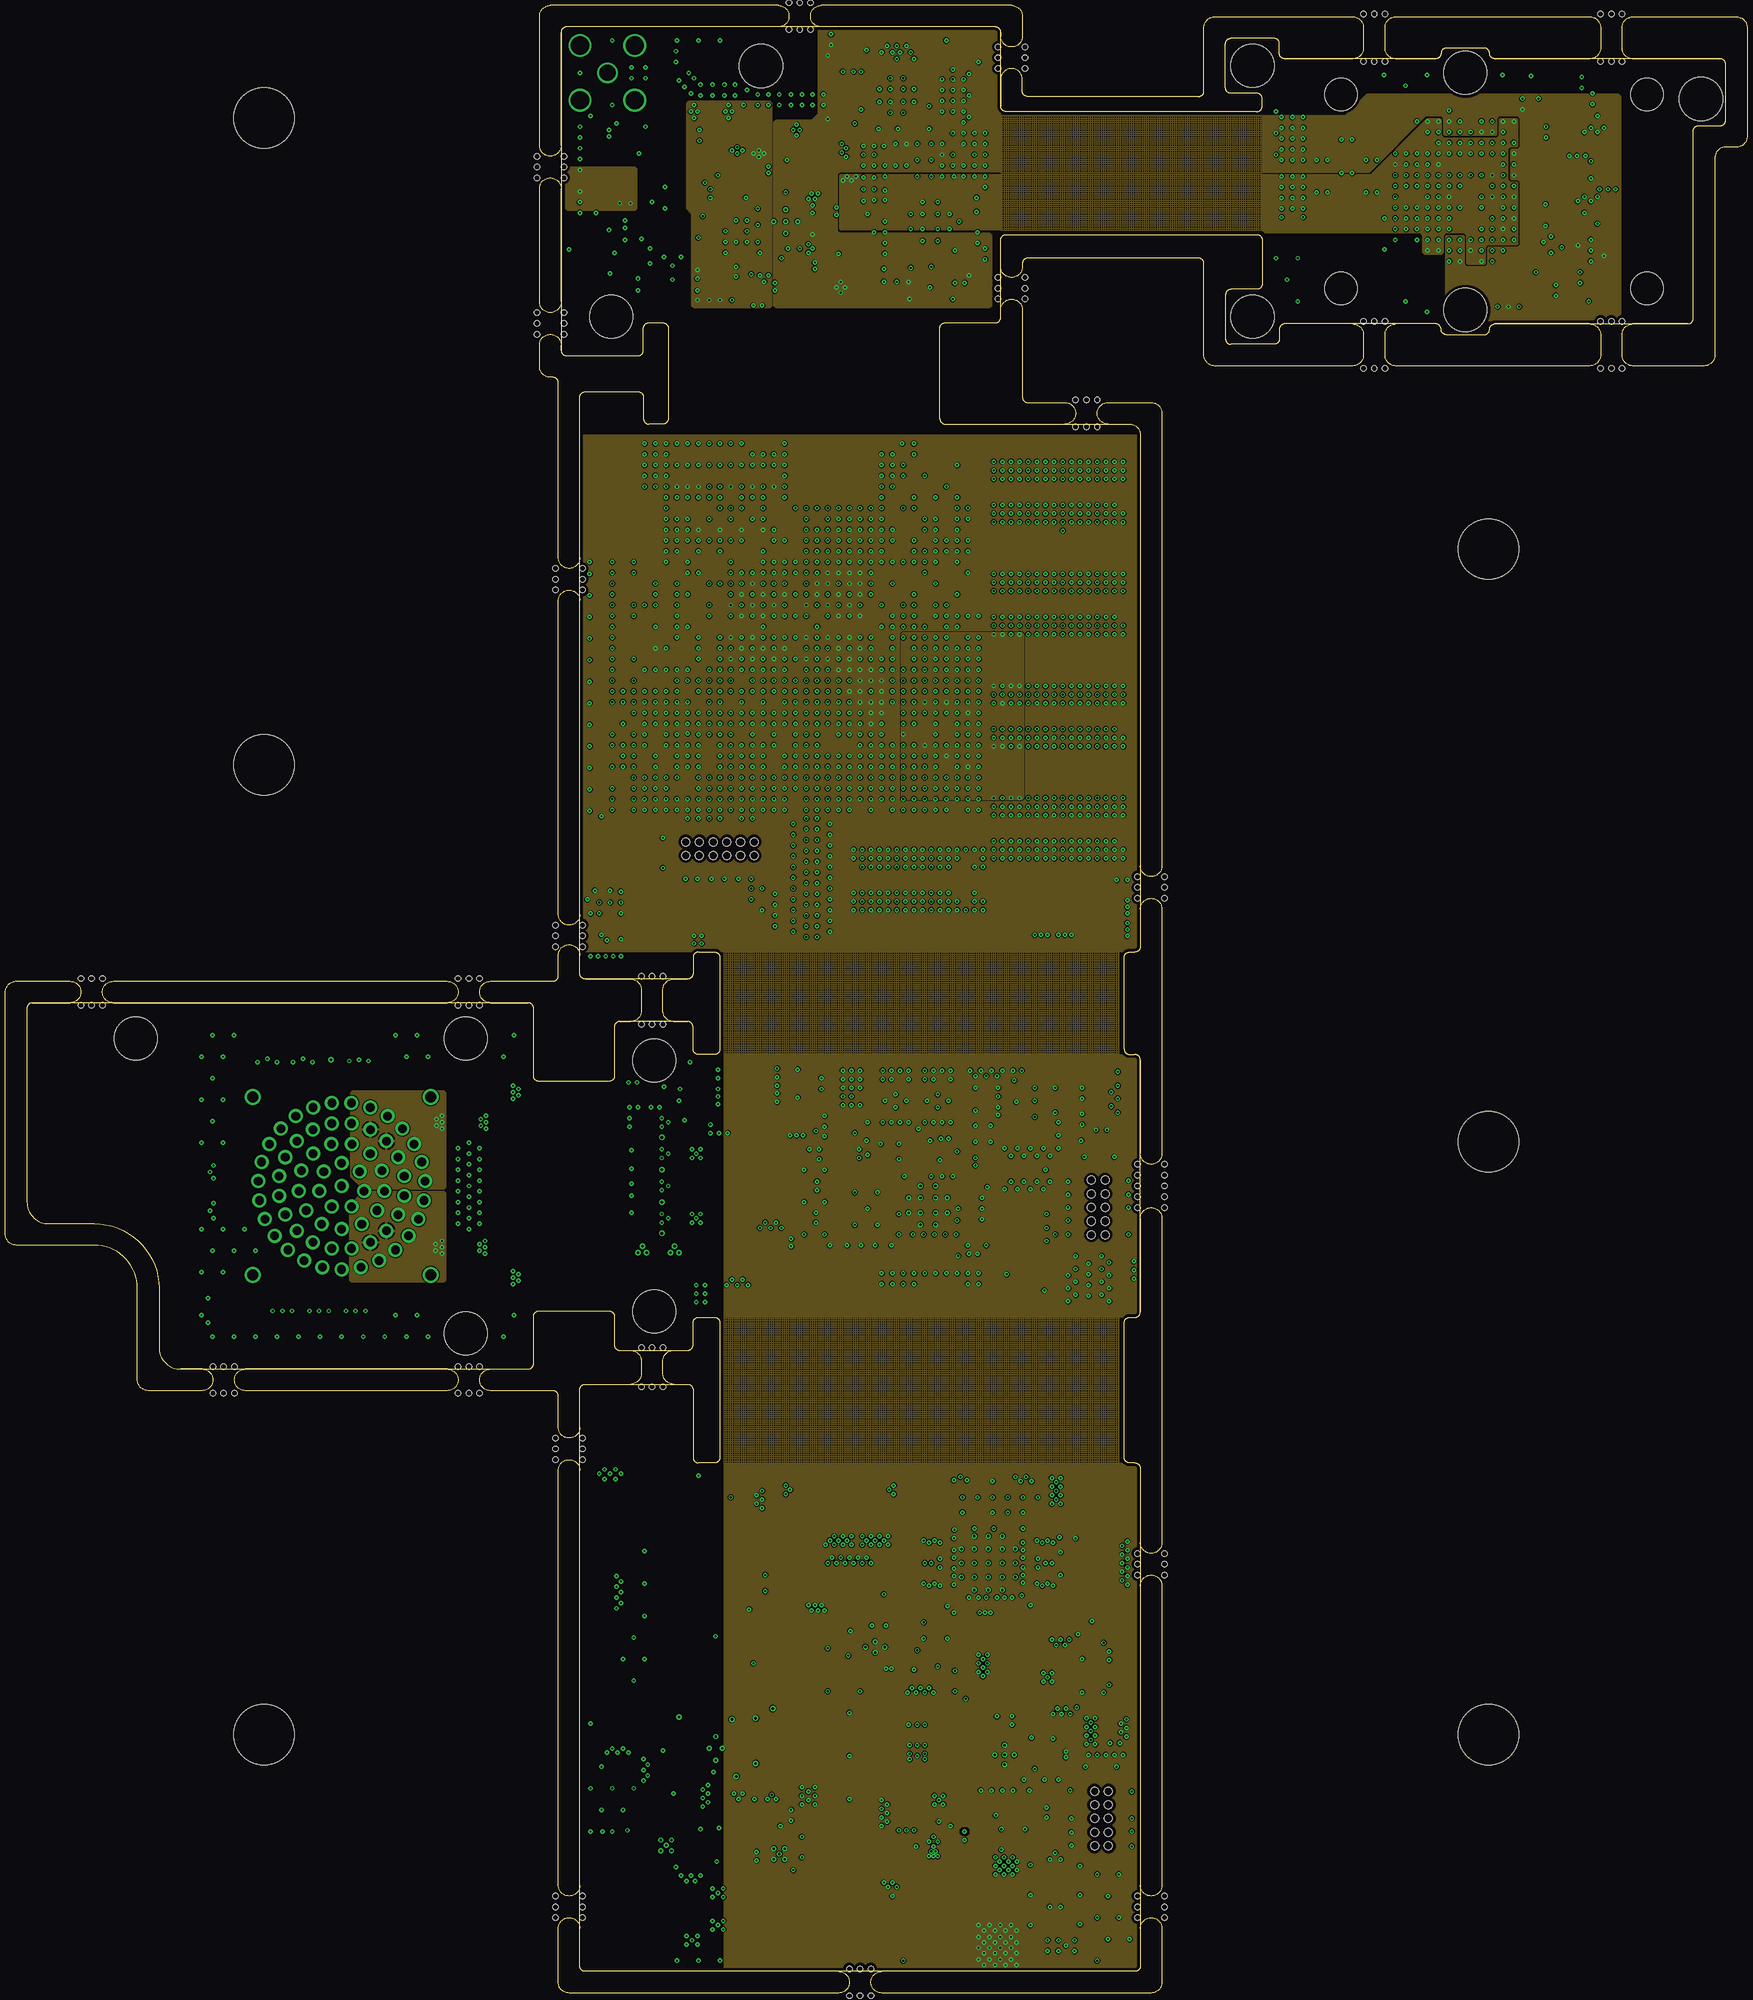
[diagram p41: board, inner layer PWR8]
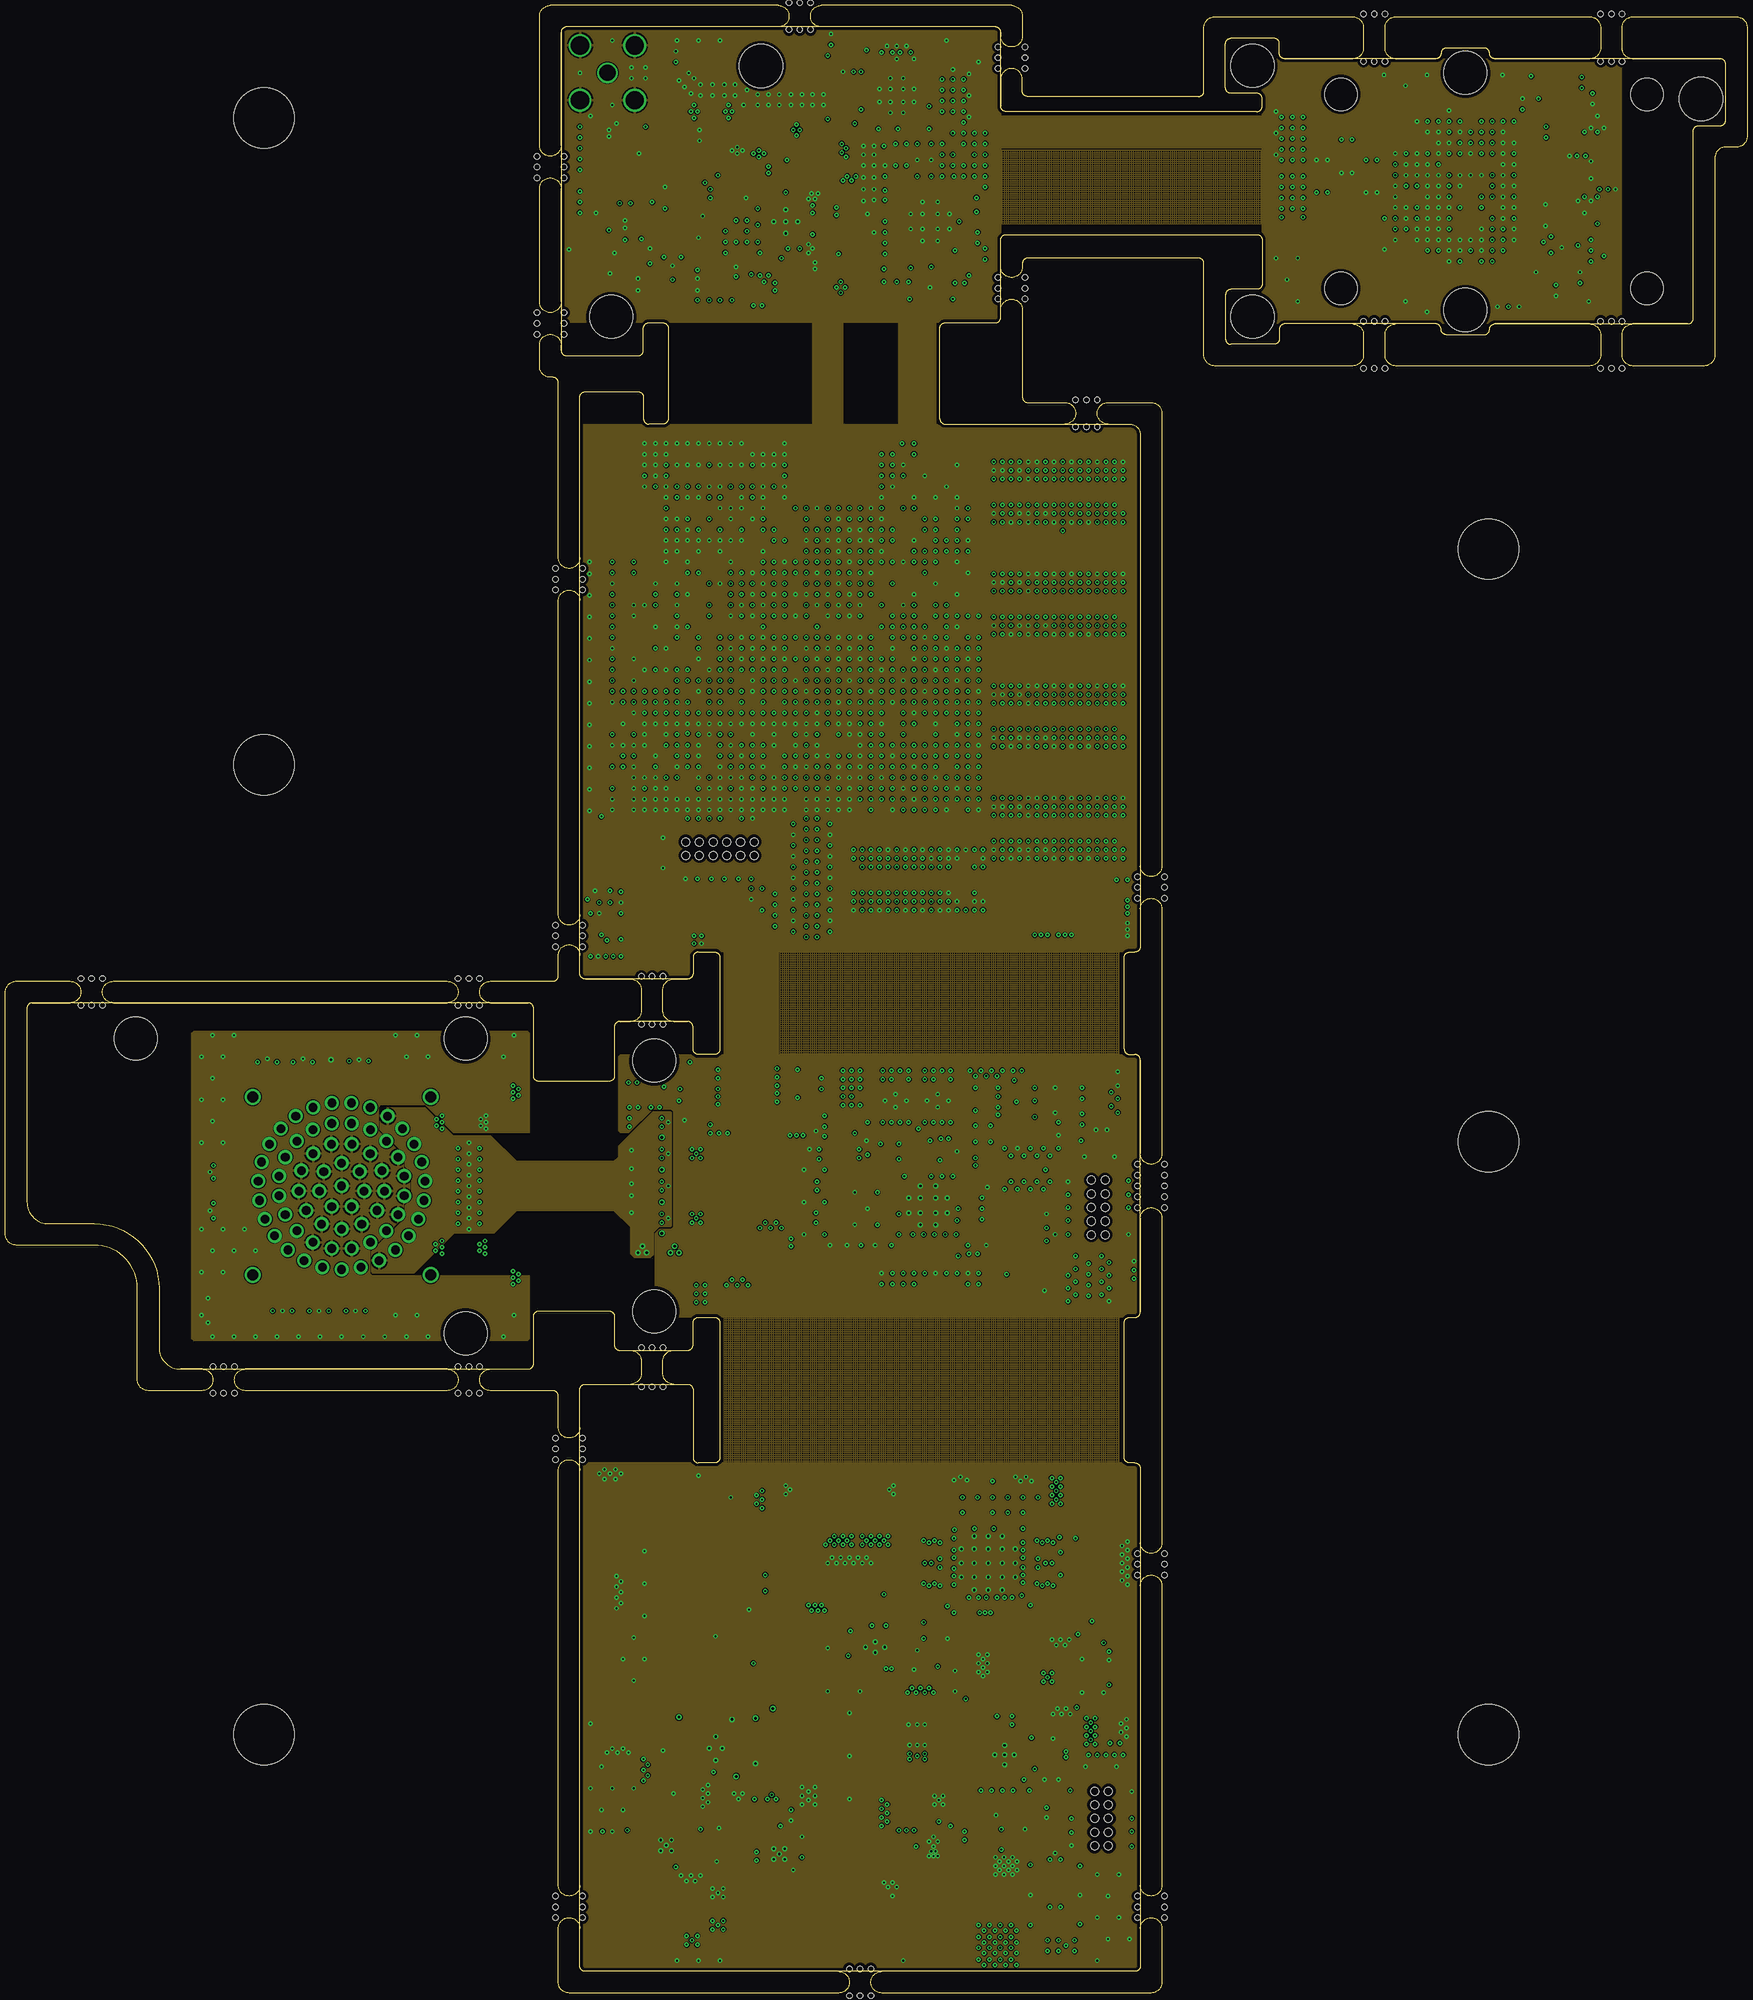
[diagram p42: board, inner layer GND9]
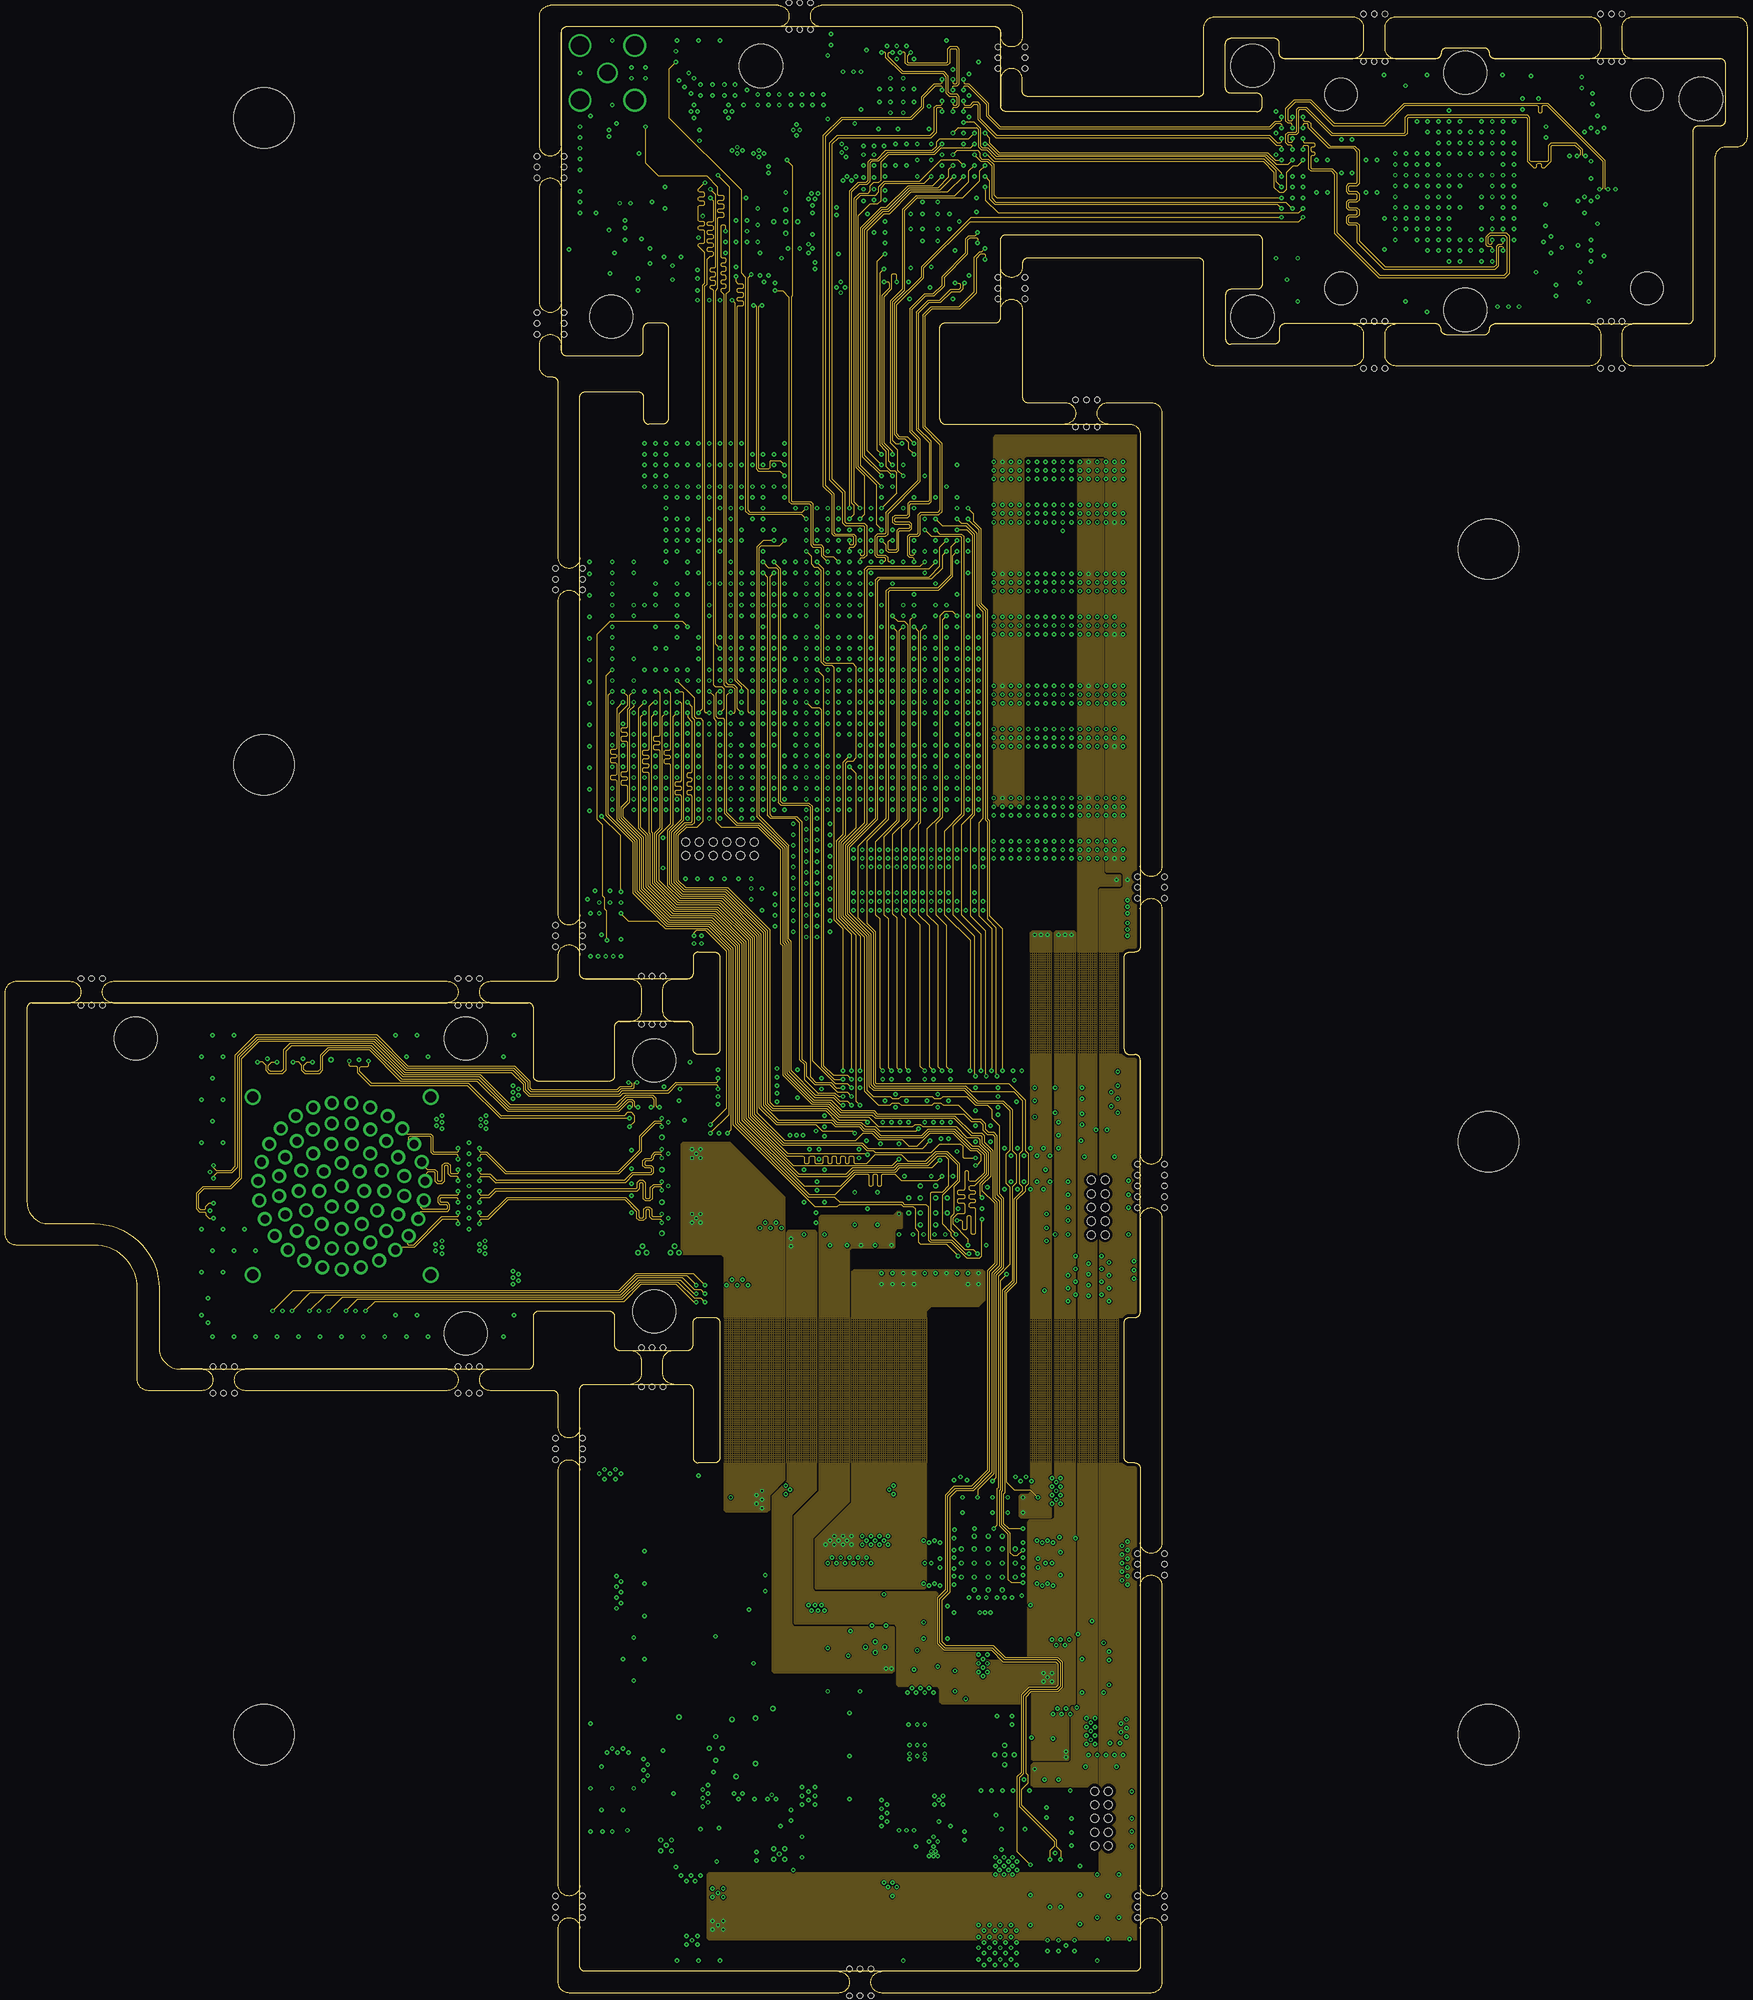
[diagram p43: board, inner layer SIG10]
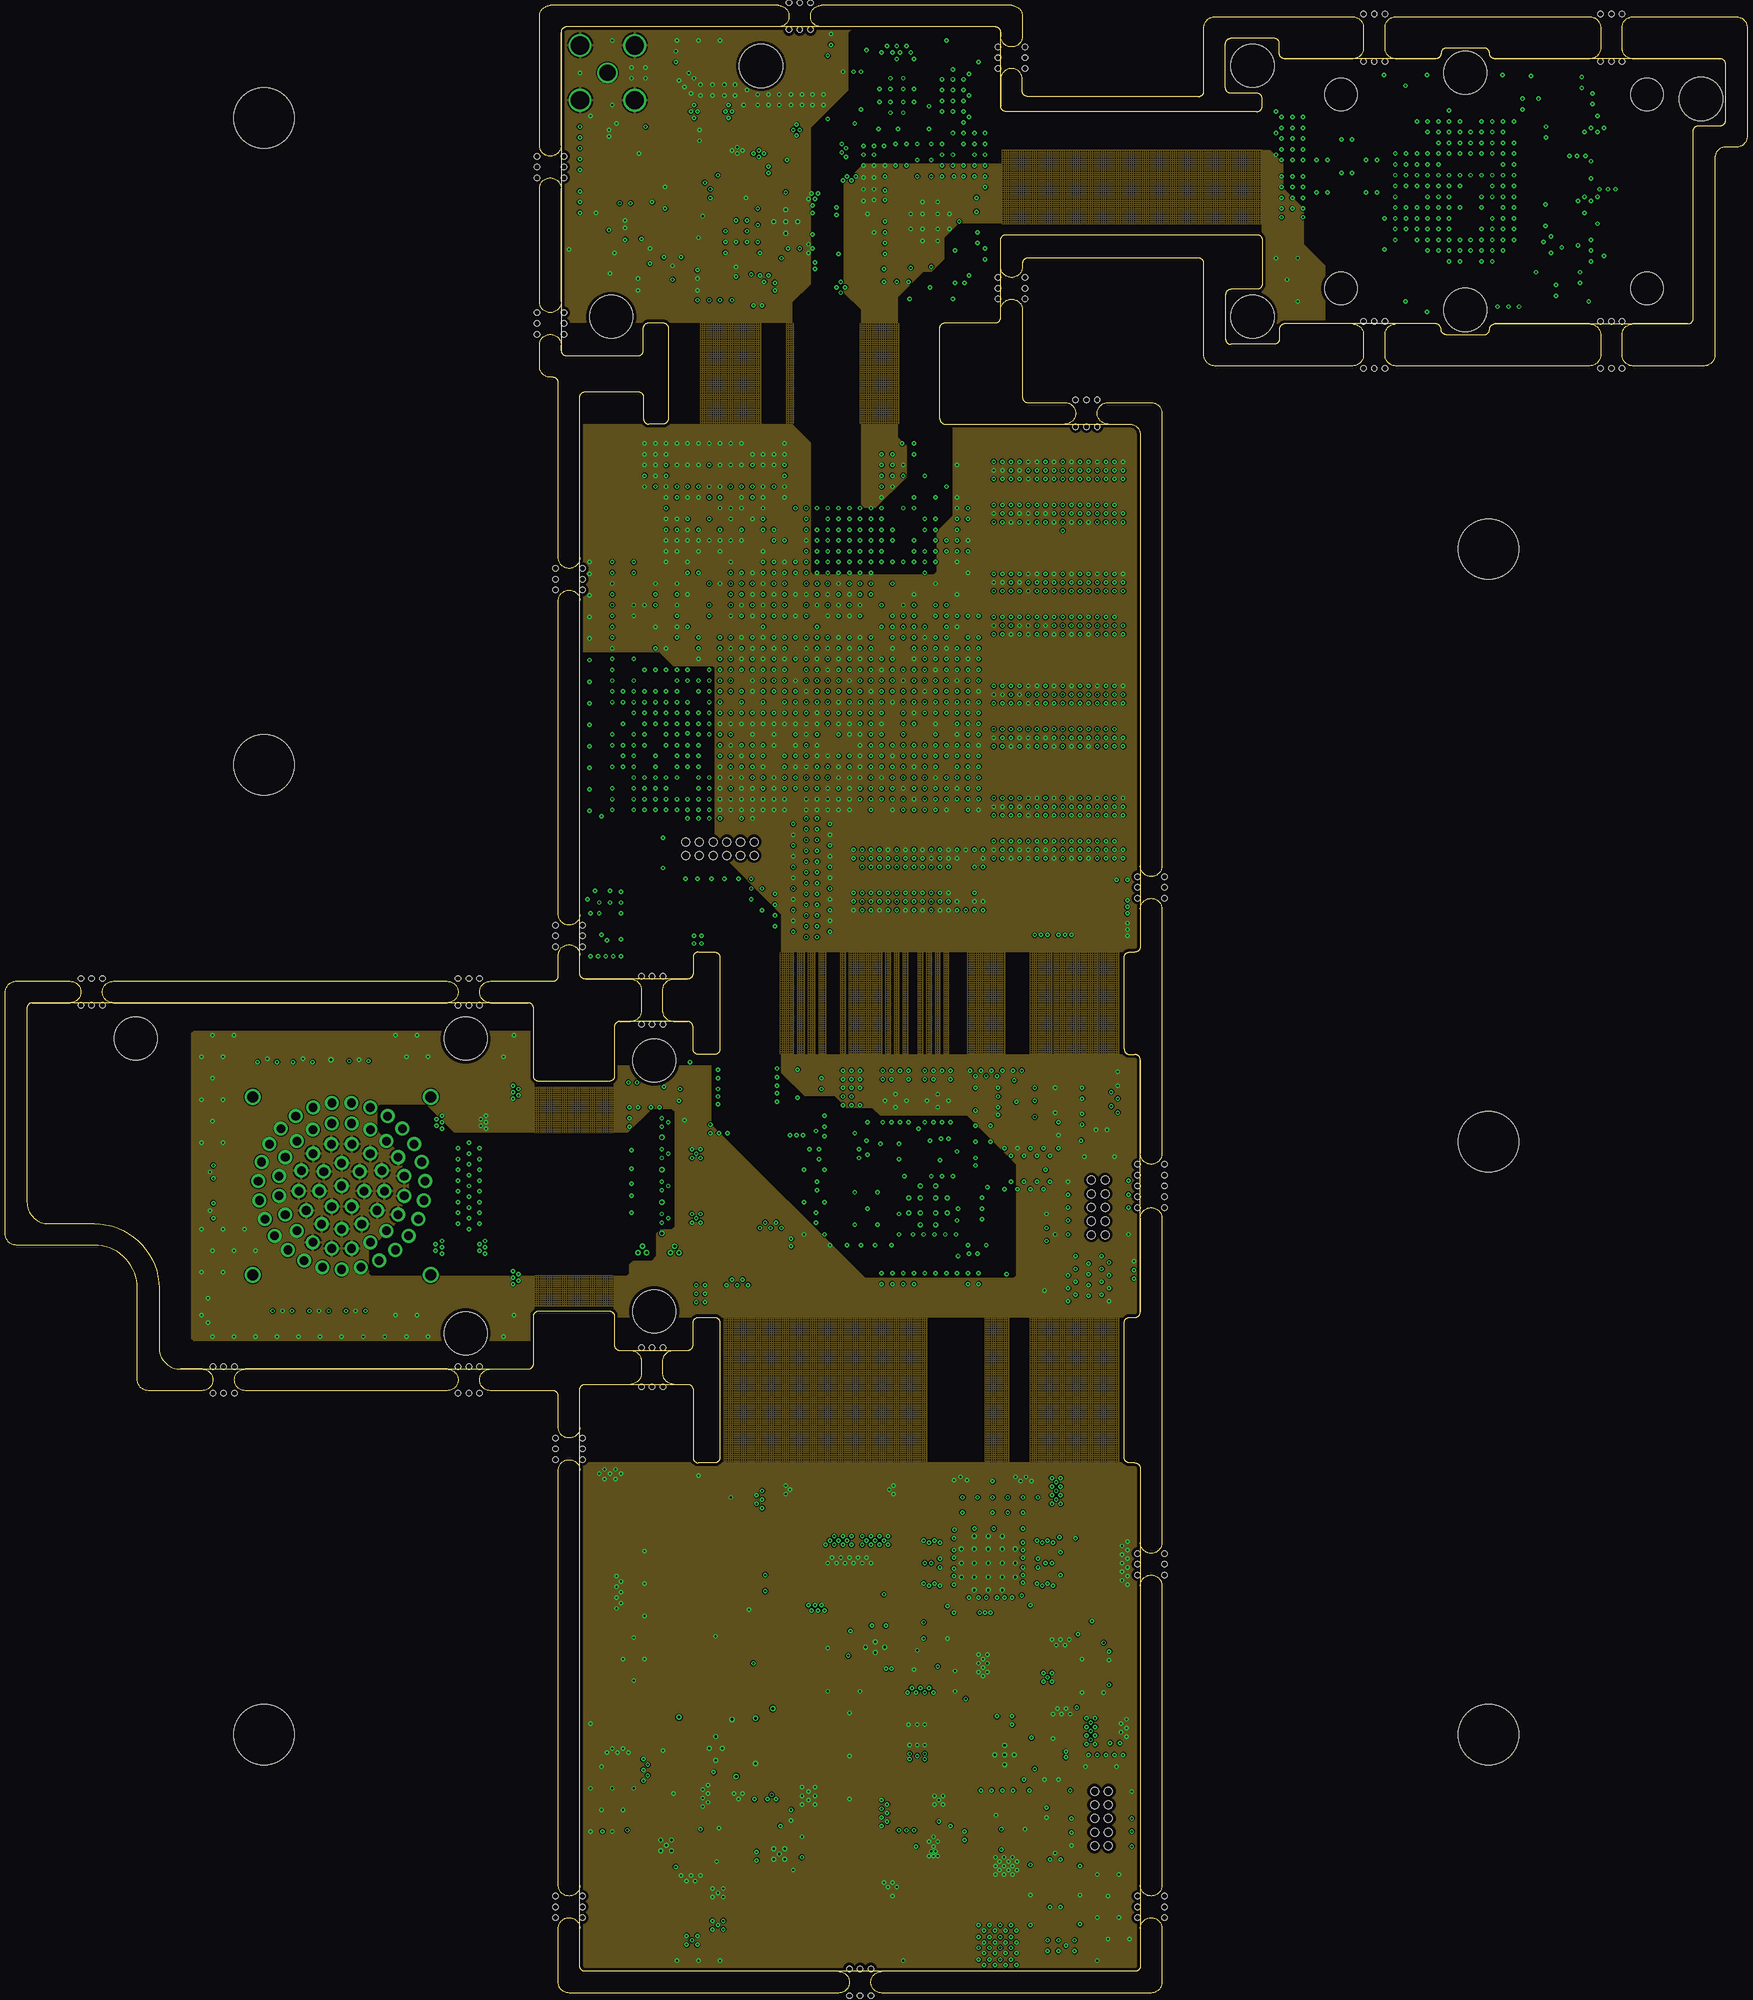
[diagram p44: board, inner layer GND11]
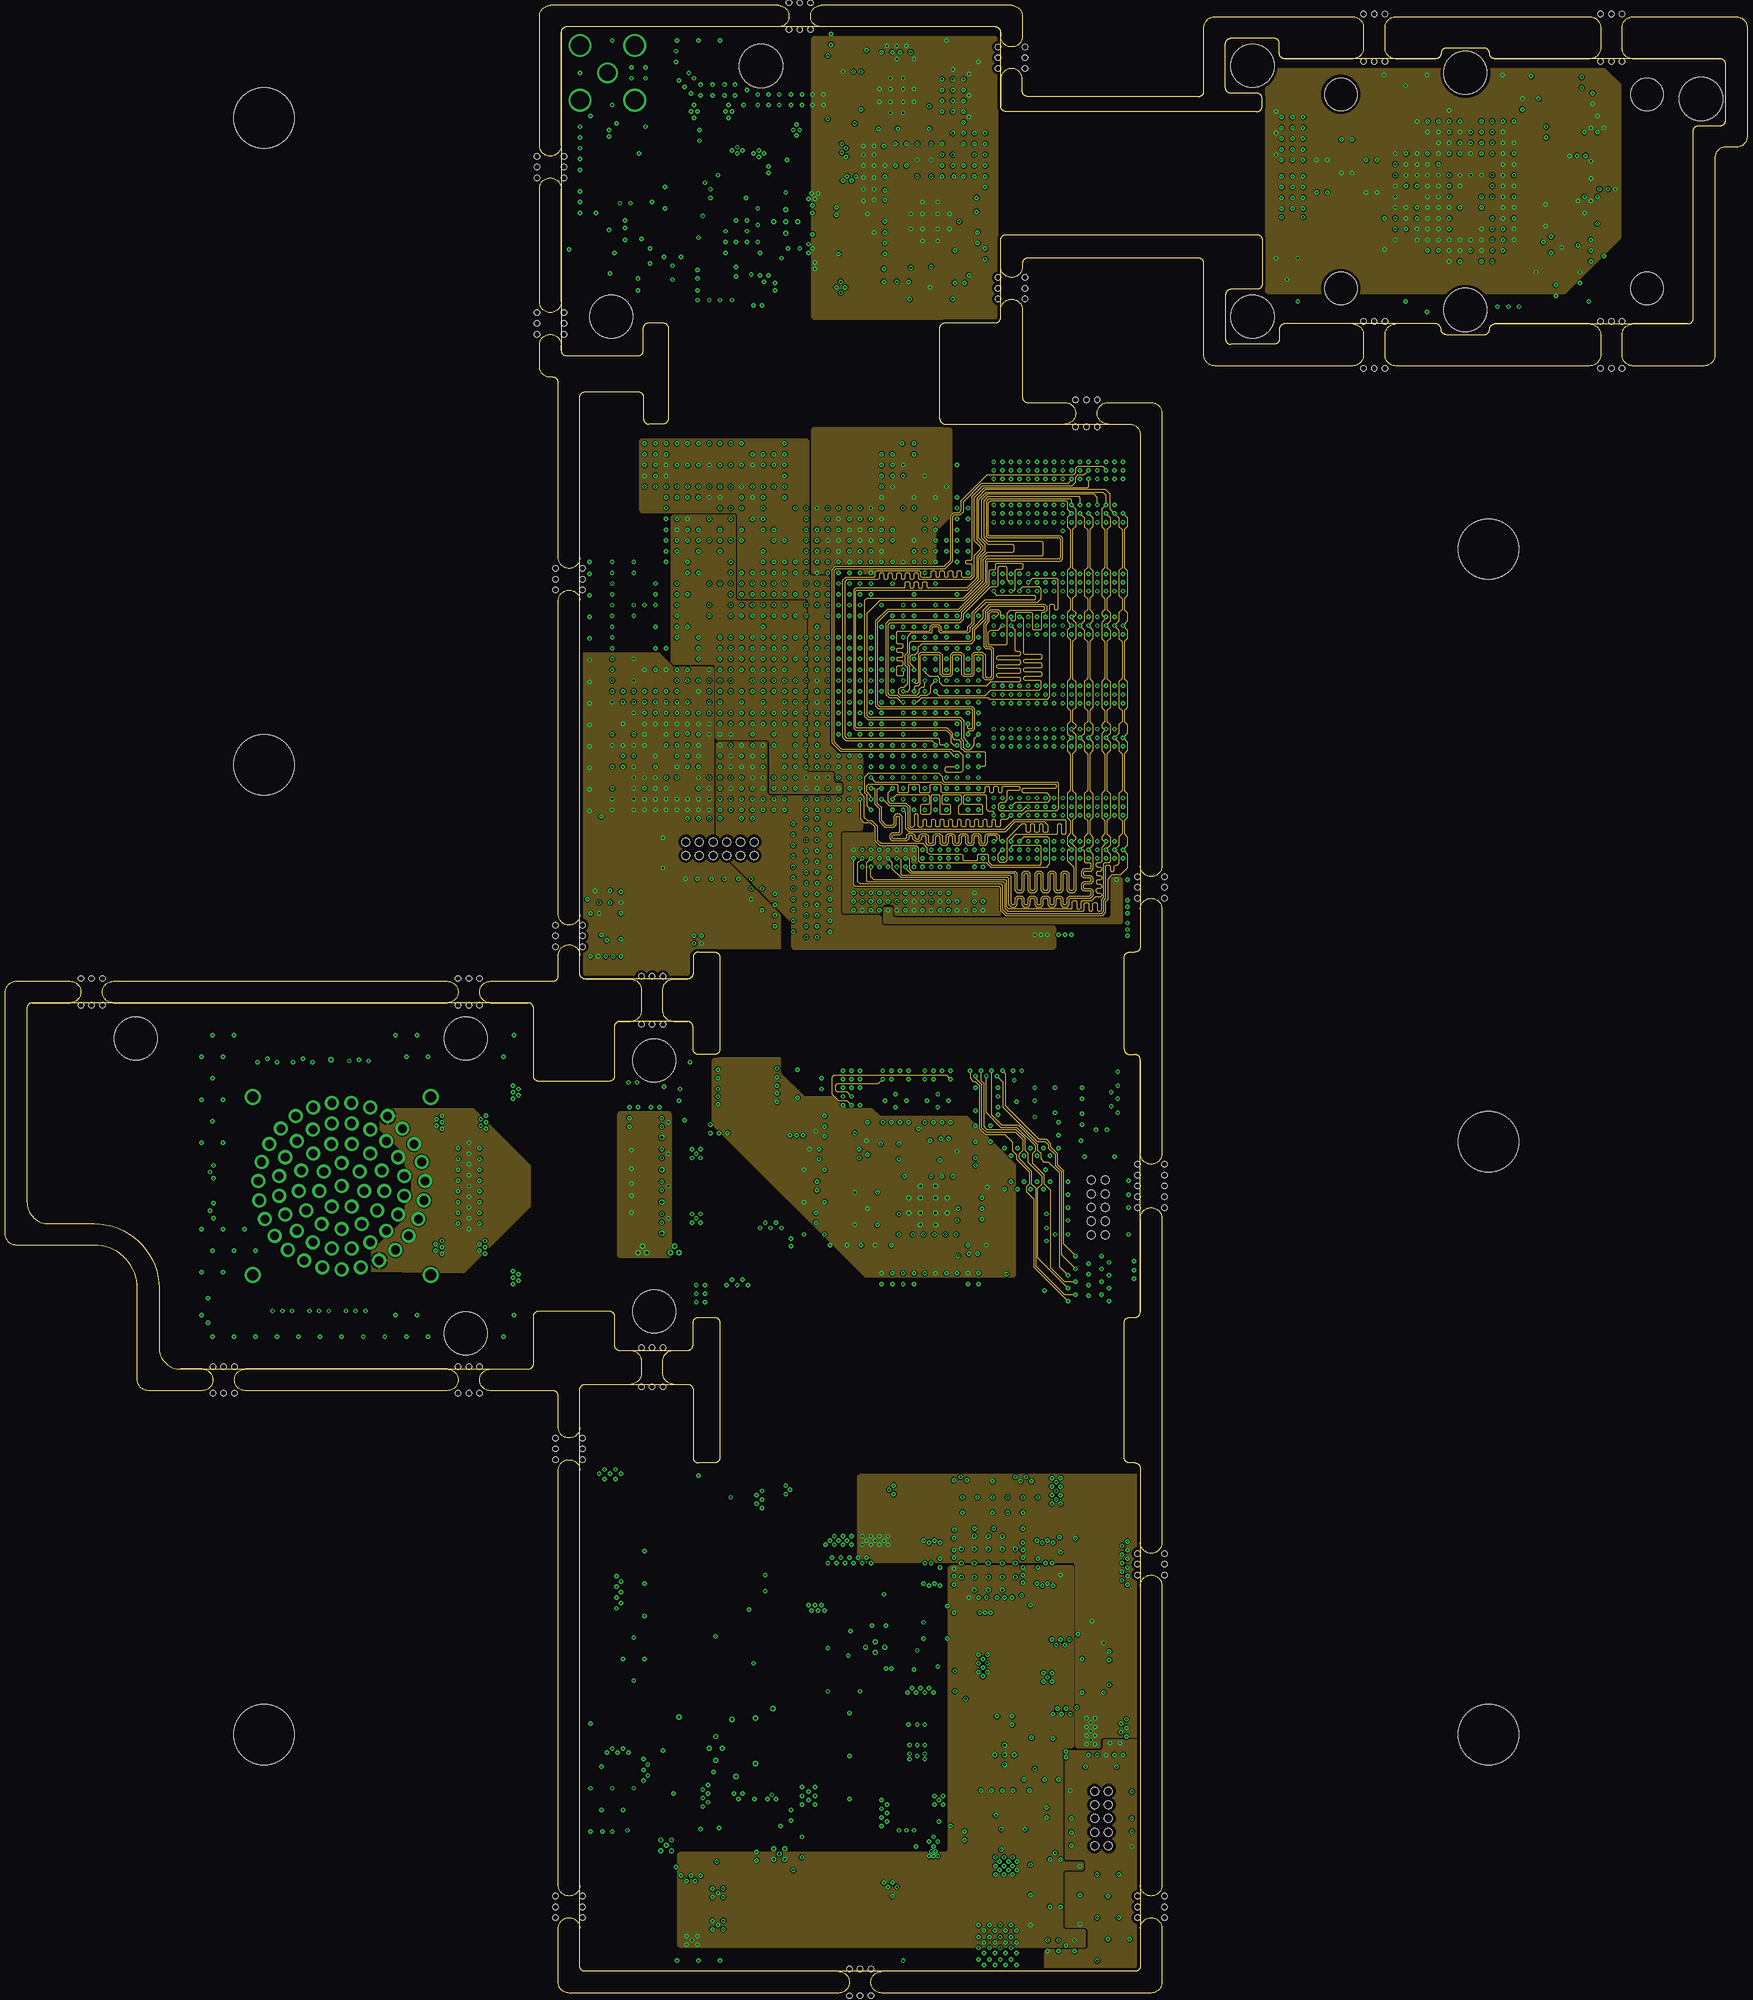
[diagram p45: board, inner layer SIG12]
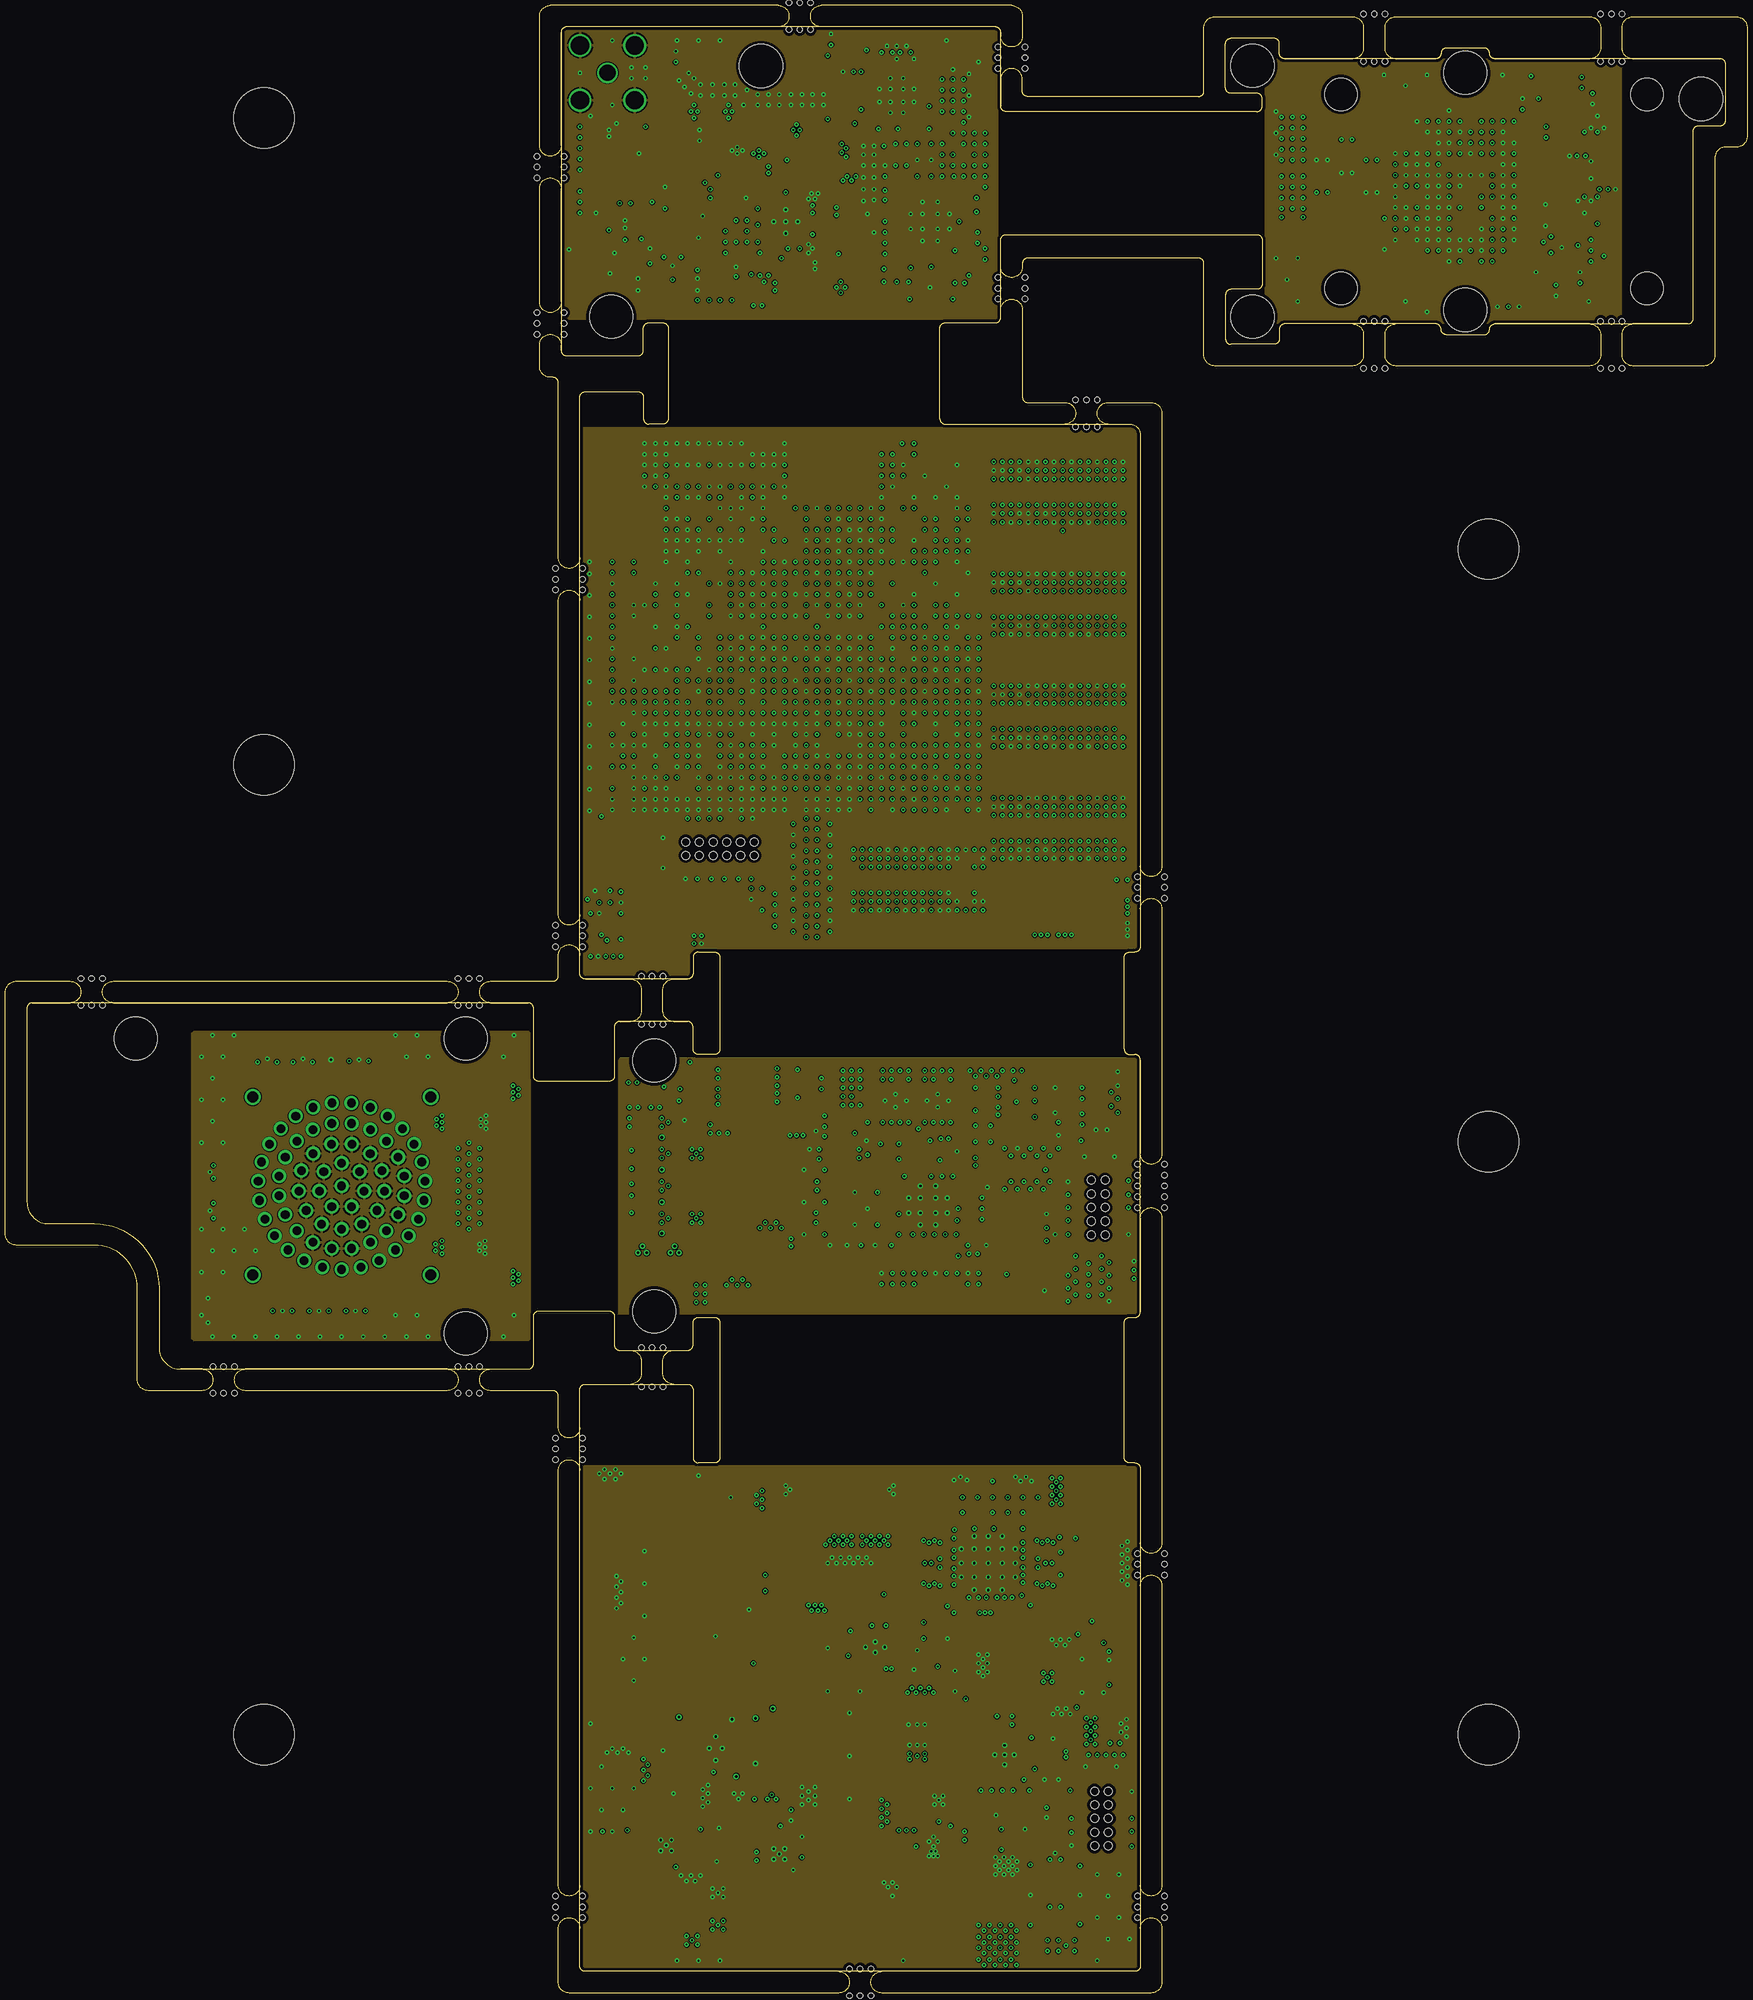
[diagram p46: board, inner layer GND13]
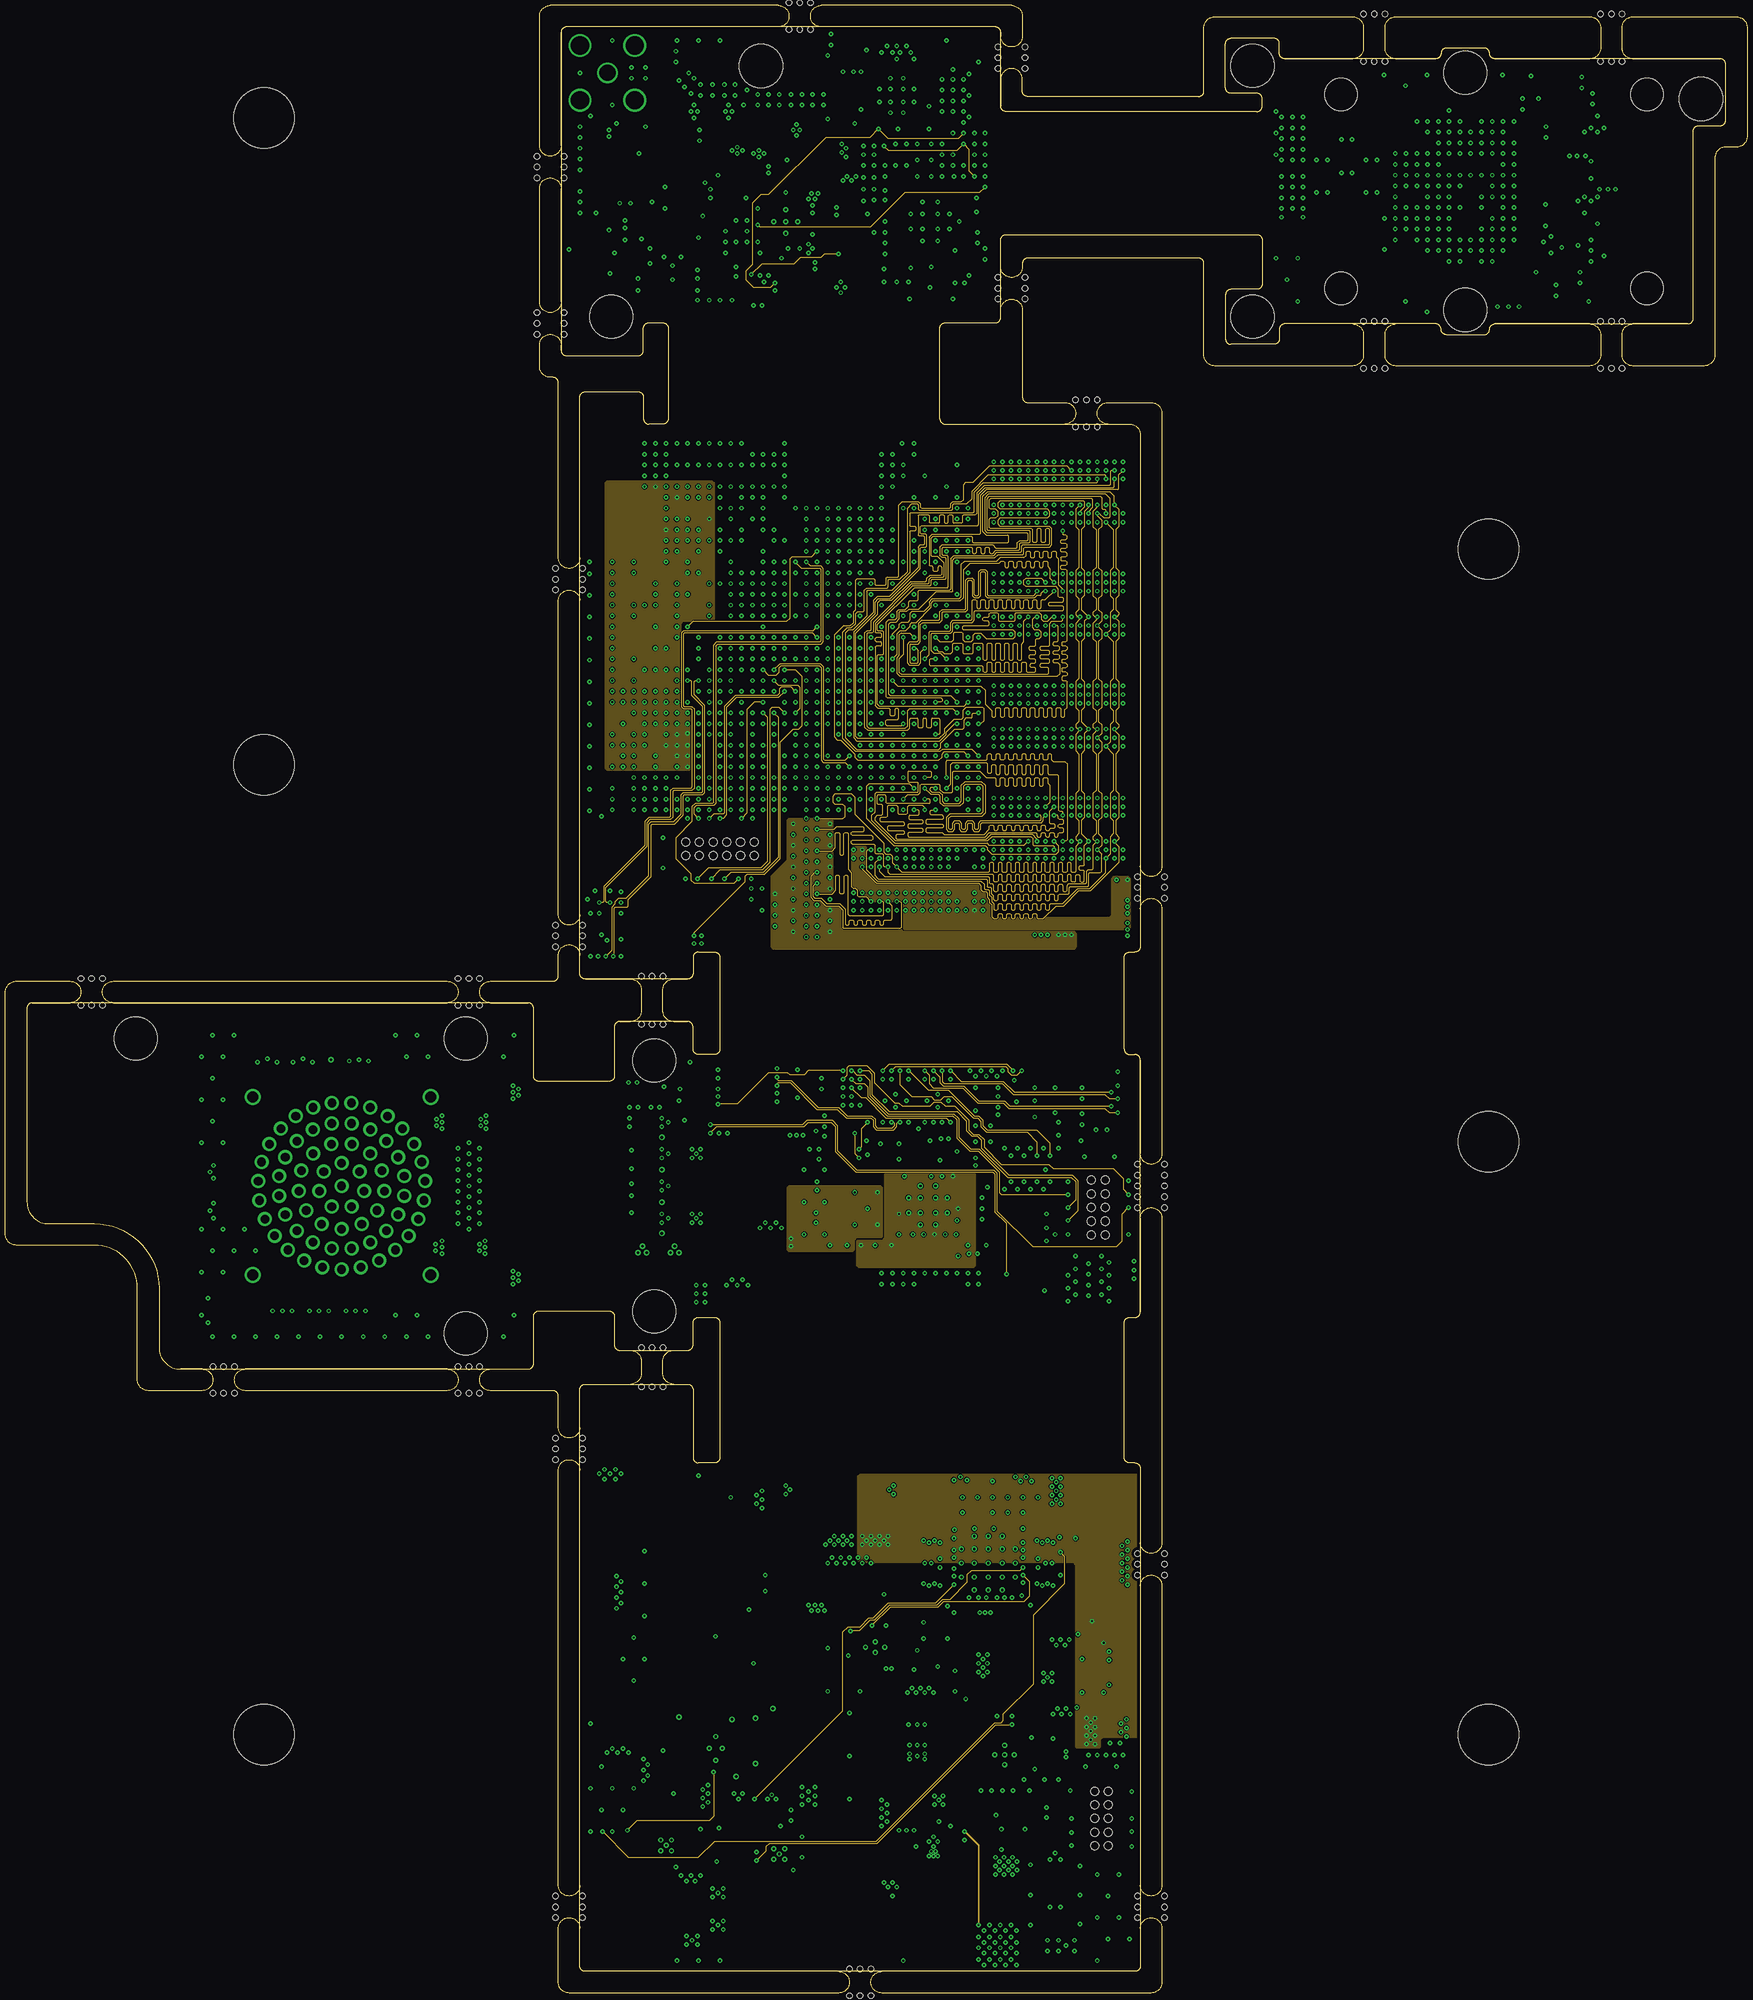
[diagram p47: board, inner layer SIG14]
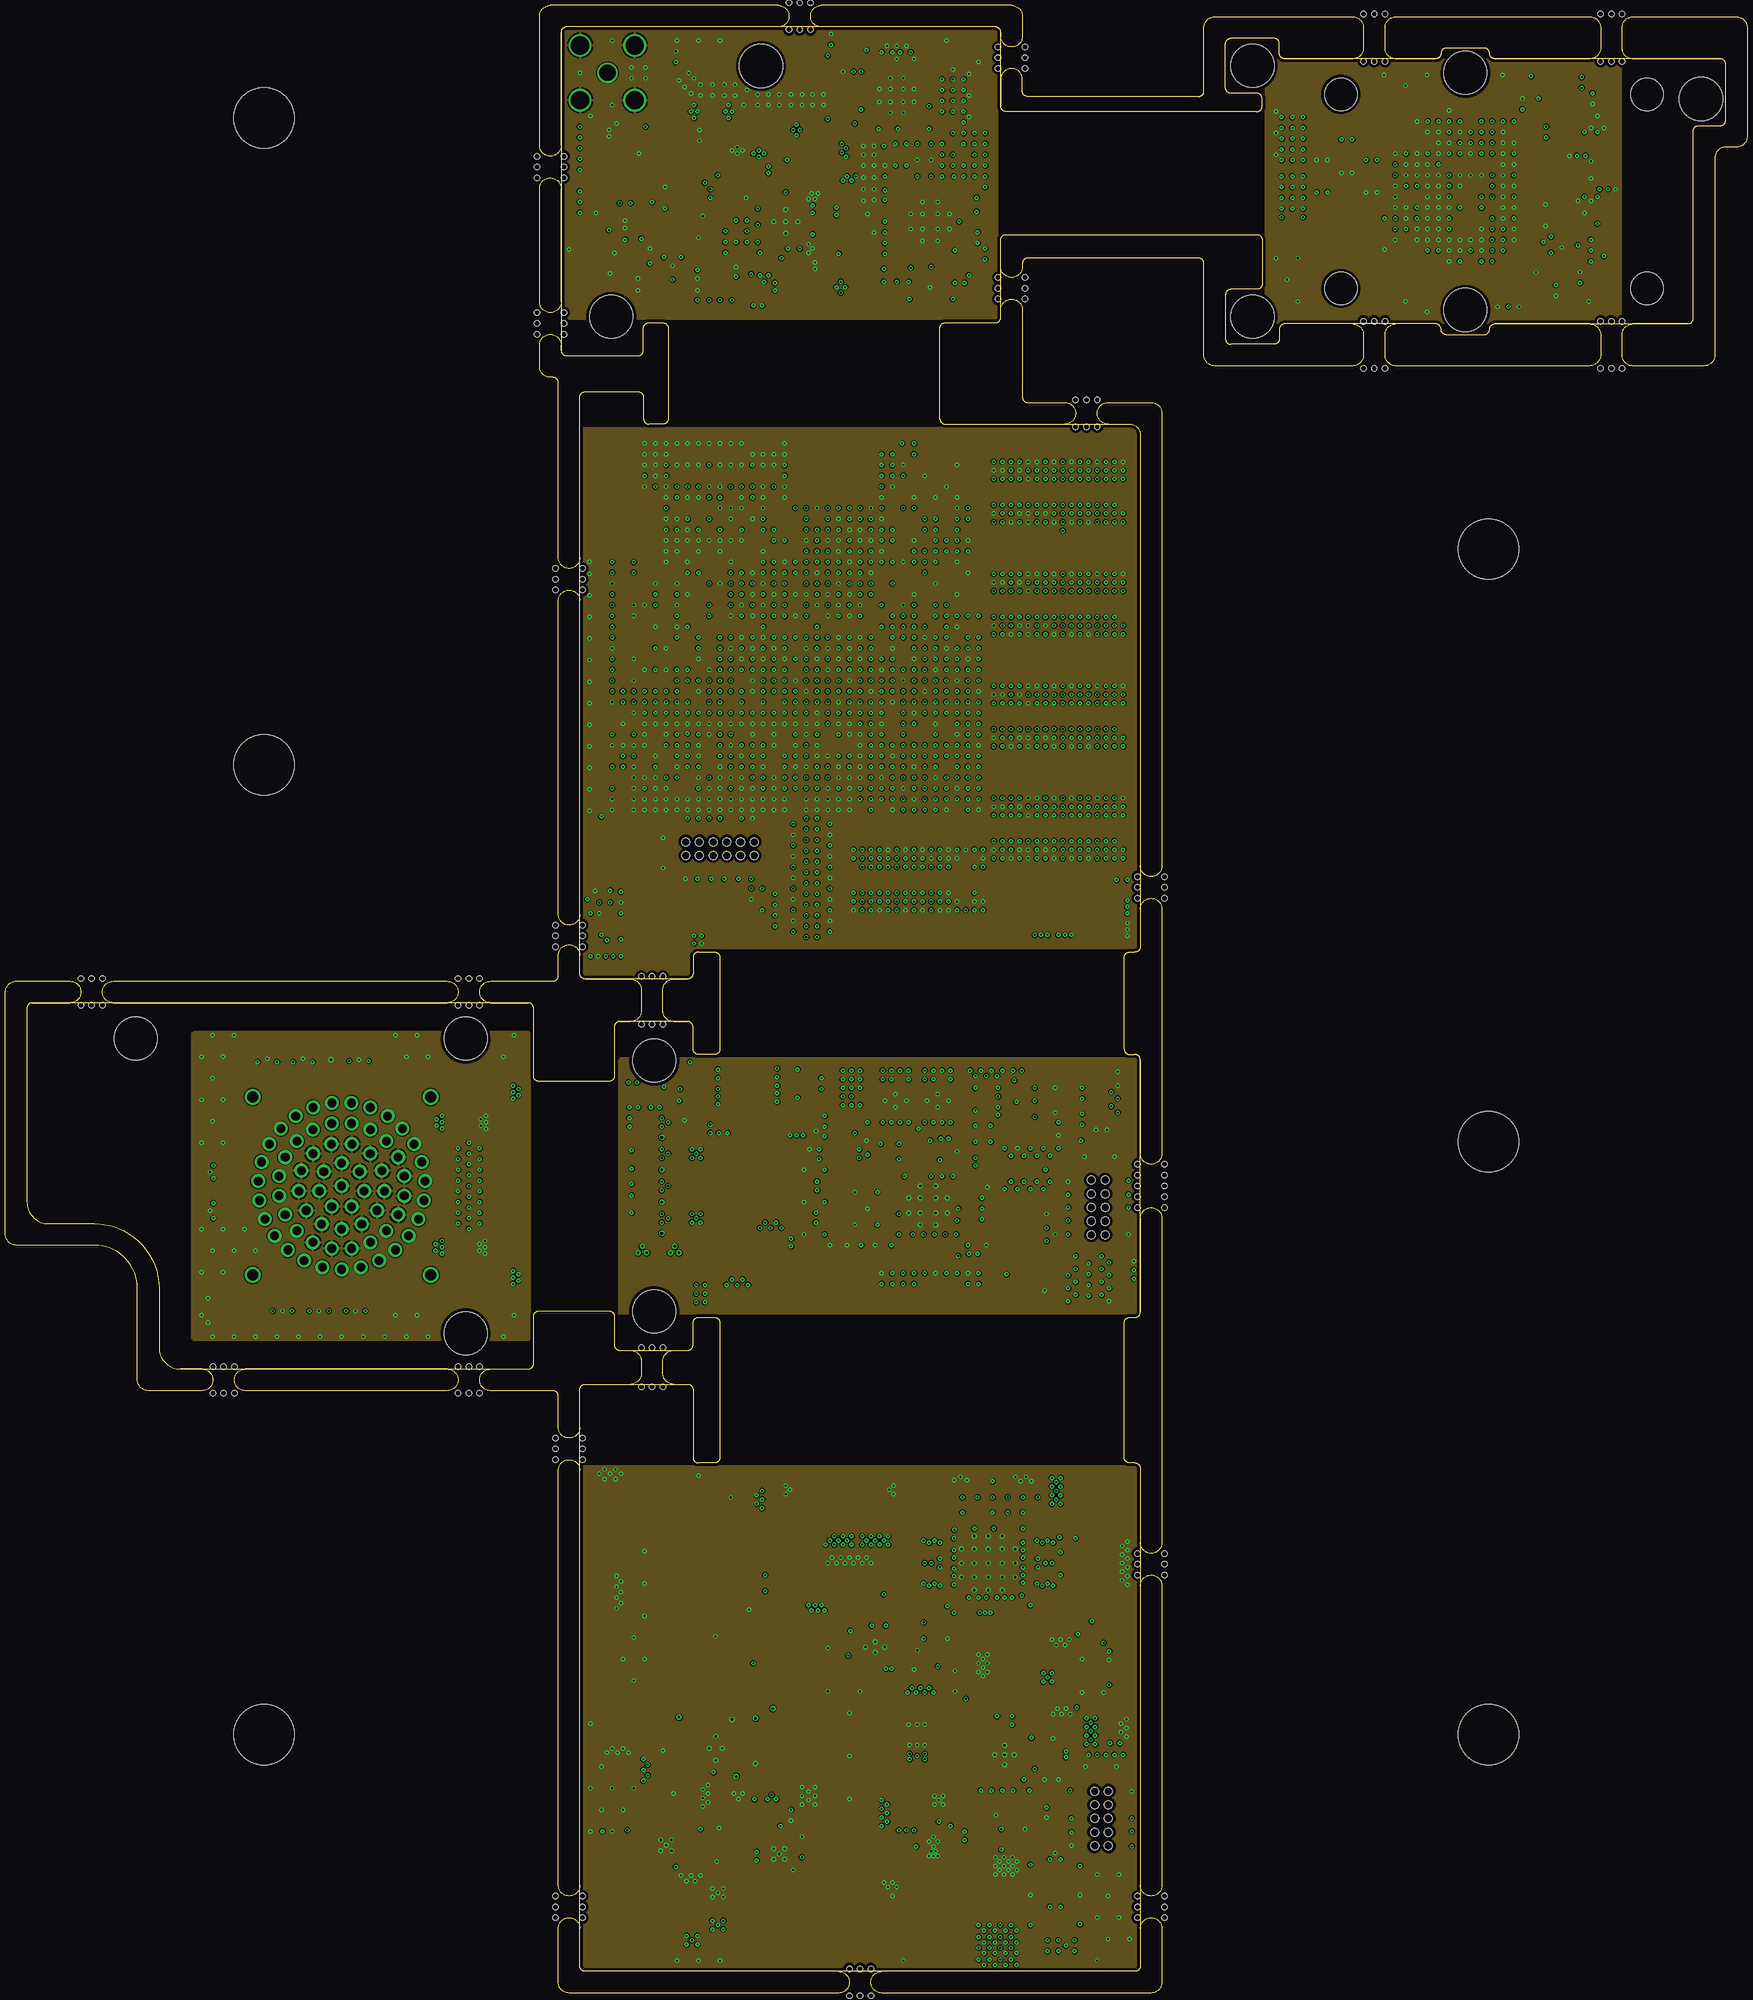
[diagram p48: board, inner layer GND15]
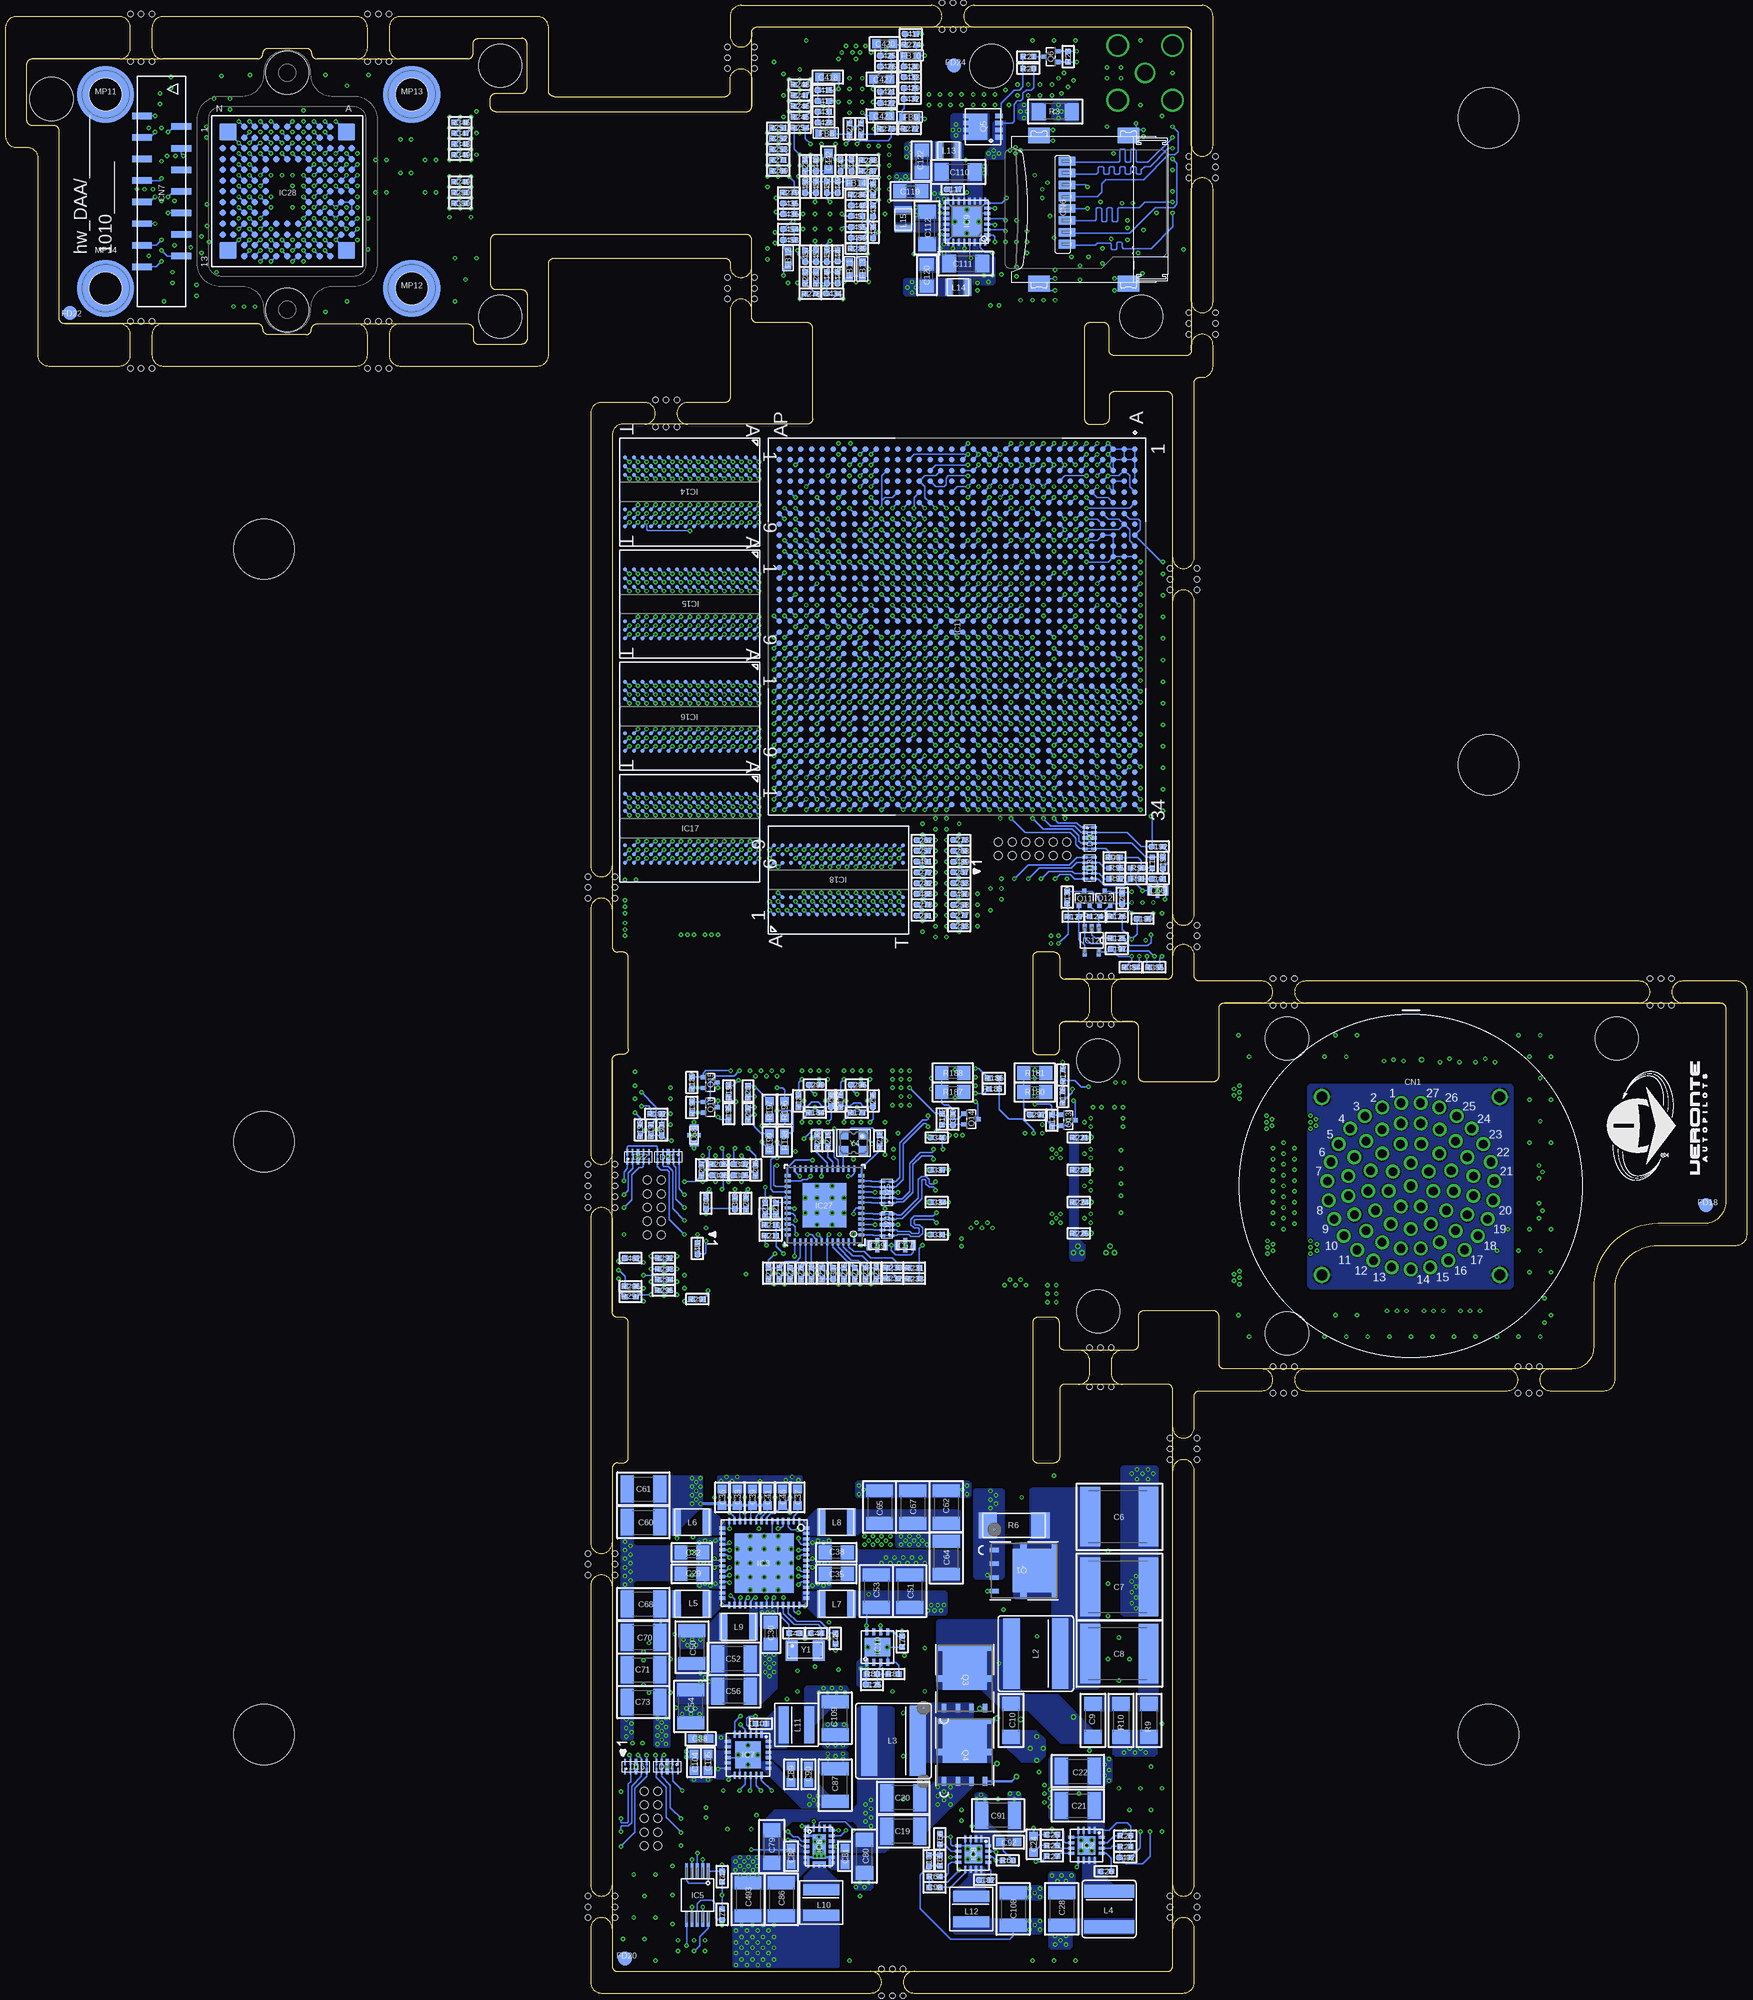
[diagram p49: board, bottom side, seen from below]

Size 157.6 x 180.46 mm. Coordinates in mm from the lower left corner, seen from the top.
Outline: 148 segments
Copper layers (1+2*3+4*5+6*7+8*9+10*11+12*13+14*15+16): Top 0.042mm / dielectric 0.13mm / GND2 0.017mm / dielectric 0.1mm / SIG3 0.017mm / dielectric 0.13mm / GND4 0.017mm / dielectric 0.1mm / SIG5 0.017mm / dielectric 0.13mm / GND6 0.017mm / dielectric 0.05mm / PWR7 0.017mm / dielectric 0.1mm / PWR8 0.017mm / dielectric 0.05mm / GND9 0.017mm / dielectric 0.1mm / SIG10 0.017mm / dielectric 0.05mm / GND11 0.017mm / dielectric 0.13mm / SIG12 0.017mm / dielectric 0.1mm / GND13 0.017mm / dielectric 0.13mm / SIG14 0.017mm / dielectric 0.1mm / GND15 0.017mm / dielectric 0.13mm / Bottom 0.042mm
Design rules "hw_DAA_Inner_Layers": minimum track width 0.075mm, minimum drill 0.15mm, track to track 0.075mm, track to pad 0.075mm, pad to pad 0.075mm, via to via 0.075mm, smd to smd 0mil, copper to edge 0.3mm, drill to drill 0.1mm, minimum pad ring 0.125mm, minimum via ring 0.13mm, stop-mask expansion 0mil, vias tented up to drill 0.3mm, thermal gap 0.15mm
Net classes: 1 DIFF100: width 0.075 mm; 4 COAX_50: width 0.2 mm; 6 DDR4_50: width 0.075 mm; 7 DDR4_90: width 0.075 mm
Holes 4 mm at 40.7,59.22 40.7,86.58 58.2,84.54 54.21,153.56 68.11,176.84 113.7,176.86 155.32,173.78 113.7,153.58 133.45,176.2 133.45,154.2 58.2,61.26 10.1,86.58
Holes 3.3 mm at -5,185.46 162.6,185.46 162.6,-5 -5,-5
Holes 5.6 mm at 22,172 135.6,132 135.6,77 135.6,22 22,22 22,112
Holes 0.5 mm at 57,92.35 58,92.35 59,92.35 58,87.91 59,87.91 57,87.91 49.05,96.1 51.55,96.1 51.55,97.1 51.55,95.1 49.05,97.1 49.05,95.1 49.05,48.5 51.55,48.5 51.55,49.5 51.55,47.5 49.05,49.5 49.05,47.5 41,89.65 41,92.15 40,92.15 42,92.15 40,89.65 42,89.65 6,89.65 6,92.15 5,92.15 7,92.15 5,89.65 7,89.65 18.25,53.65 18.25,56.15 17.25,56.15 19.25,56.15 17.25,53.65 19.25,53.65 41,53.65 41,56.15 40,56.15 42,56.15 40,53.65 42,53.65 58,54.25 58,57.9 57,57.9 59,57.9 57,54.25 59,54.25 51.55,6 49.05,6 49.05,5 49.05,7 51.55,5 51.55,7 77.3,0.25 77.3,-2.25 78.3,-2.25 76.3,-2.25 78.3,0.25 76.3,0.25 105.55,6 103.05,6 103.05,5 103.05,7 105.55,5 105.55,7 105.55,37.8 103.05,37.8 103.05,36.8 103.05,38.8 105.55,36.8 105.55,38.8 105.55,100.6 103.05,100.6 103.05,99.6 103.05,101.6 105.55,99.6 105.55,101.6 98.3,143.35 98.3,145.85 97.3,145.85 99.3,145.85 97.3,143.35 99.3,143.35 51.55,129.2 49.05,129.2 49.05,128.2 49.05,130.2 51.55,128.2 51.55,130.2 49.81,153.94 49.81,152.94 49.81,151.94 47.31,151.94 47.31,152.94 47.31,153.94 47.31,168.46 49.81,168.46 47.31,167.46 47.31,166.46 49.81,167.46 49.81,166.46 92.6,157.2 92.6,156.2 92.6,155.2 90.1,155.2 90.1,156.2 90.1,157.2 92.6,178.6 92.6,177.6 92.6,176.6 90.1,176.6 90.1,177.6 90.1,178.6 105.55,72.9 103.05,72.9 103.05,71.9 103.05,73.9 105.55,71.9 105.55,73.9 103.05,70.9 103.05,74.9 105.55,74.9 105.55,70.9 125,181.65 125,177.25 126,177.25 124,177.25 126,181.65 124,181.65 147,181.65 147,177.25 148,177.25 146,177.25 148,181.65 146,181.65 147,153.15 147,148.75 148,148.75 146,148.75 148,153.15 146,153.15 125,153.15 125,148.75 126,148.75 124,148.75 126,153.15 124,153.15 71.7,182.71 71.7,180.21 72.7,180.21 70.7,180.21 72.7,182.71 70.7,182.71
bKeepout: area 63,57.9 to 67,61.9
tRestrict: area 56.2,82.5 to 60.2,86.5; area 52.2,151.6 to 56.2,155.6; area 66.1,174.8 to 70.1,178.8; area 63.3,46.2 to 103.3,47.2; area 46,61.7 to 47,82.2; area 54.5,60.1 to 55.5,83.5; area 58.5,142.7 to 86.9,143.6; area 63.3,60.7 to 103.3,61.7; area 63.3,84.1 to 103.3,85.1; area 63.3,94.6 to 103.3,95.6; area 58.4,153 to 86.8,154; area 89.4,160.7 to 90.4,172.7; 23 more areas; 1 lines
bRestrict: area 38.7,84.6 to 42.7,88.6; area 38.7,57.2 to 42.7,61.2; area 111.7,174.9 to 115.7,178.9; area 153.3,171.8 to 157.3,175.8; area 114.6,160.2 to 115.6,173.2; area 46,61.7 to 47,82.2; area 54.5,60.1 to 55.5,83.5; area 63.3,84.1 to 103.3,85.1; area 63.3,60.7 to 103.3,61.7; area 63.3,46.2 to 103.3,47.2; area 63.3,94.6 to 103.3,95.6; area 58.4,153 to 86.8,154; 9 more areas
Milling: 322 lines

## Footprints (pad centres in the part's own frame; a part is rotated, then mirrored left to right if it is on the bottom)
C1206 = smd 1.3 x 1.6: 1 -1.524,0; 2 1.524,0
C0603 = smd 0.8 x 0.8: 1 -0.762,0; 2 0.762,0
C0402 = smd 0.5 x 0.5: 1 -0.508,0; 2 0.508,0
C2220K = smd 1.85 x 5.5: 1 -2.54,0; 2 2.857,0
C1210 = smd 1.2 x 2.5: 1 -1.524,0; 2 1.524,0
C0805 = smd 1.2 x 1.3: 1 -1.016,0; 2 1.016,0
NFM18HC106 = smd 0.5 x 0.9: 1 -0.75,0; 3 0.75,0 | smd 0.4 x 0.4: 2 0,-0.45; 4 0,0.45
HEW.LM.368.XLNP = drill 0.8 pad 1.3: 1 -0.9,7.698; 2 -2.651,7.283; 3 -4.259,6.475; 4 -5.637,5.318; 5 -6.712,3.875; 6 -7.424,2.223; 7 -7.737,0.451; 8 -7.632,-1.346; 9 -7.116,-3.07; 10 -6.216,-4.628; 11 -4.982,-5.937; 12 -3.478,-6.926; 13 -1.787,-7.541; 14 0,-7.75; 15 1.787,-7.541; 16 3.478,-6.926; 17 4.982,-5.937; 18 6.216,-4.628; 19 7.116,-3.07; 20 7.632,-1.346; 21 7.737,0.451; 22 7.424,2.223; 23 6.712,3.875; 24 5.637,5.318; 25 4.259,6.475; 26 2.651,7.283; 27 0.9,7.698; 28 -0.919,5.803; 29 -2.667,5.235; 30 -4.154,4.154; 31 -5.235,2.667; 32 -5.803,0.919; 33 -5.803,-0.919; 34 -5.235,-2.667; 35 -4.154,-4.154; 36 -2.667,-5.235; 37 -0.919,-5.803; 38 0.919,-5.803; 39 2.667,-5.235; 40 4.154,-4.154; 41 5.235,-2.667; 42 5.803,-0.919; 43 5.803,0.919; 44 5.235,2.667; 45 4.154,4.154; 46 2.667,5.235; 47 0.919,5.803; 48 -0.957,3.884; 49 -2.652,2.994; 50 -3.74,1.418; 51 -3.971,-0.482; 52 -3.292,-2.272; 53 -1.859,-3.542; 54 0,-4; 55 1.859,-3.542; 56 3.292,-2.272; 57 3.971,-0.482; 58 3.74,1.418; 59 2.652,2.994; 60 0.957,3.884; 61 0,2.125; 62 -1.661,1.325; 63 -2.072,-0.473; 64 -0.922,-1.915; 65 0.922,-1.915; 66 2.072,-0.473; 67 1.661,1.325; 68 0,0 | drill 1 pad 1.5: SH1 -8.255,-8.255; SH2 8.255,-8.255; SH3 8.255,8.255; SH4 -8.255,8.255
132203-18 = drill 1.7: GND1 2.54,2.54; GND2 2.54,-2.54; GND3 -2.54,-2.54; GND4 -2.54,2.54 | drill 1.5: RF 0,0
CLP-105-02-X-D-BE = smd 0.74 x 1.27: 1 -2.54,1.967; 2 -2.54,-1.967; 3 -1.27,1.967; 4 -1.27,-1.967; 5 0,1.967; 6 0,-1.967; 7 1.27,1.967; 8 1.27,-1.967; 9 2.54,1.967; 10 2.54,-1.967 | hole 0.74: -1.27,0.635; 0,0.635; 1.27,0.635; -1.27,-0.635; 0,-0.635; 1.27,-0.635; -2.54,0.635; -2.54,-0.635; 2.54,0.635; 2.54,-0.635
CLP-106-02-X-D-BE = smd 0.74 x 1.27: 1 -3.175,1.967; 2 -3.175,-1.967; 3 -1.905,1.967; 4 -1.905,-1.967; 5 -0.635,1.967; 6 -0.635,-1.967; 7 0.635,1.967; 8 0.635,-1.967; 9 1.905,1.967; 10 1.905,-1.967; 11 3.175,1.967; 12 3.175,-1.967 | hole 0.74: -1.905,0.635; -0.635,0.635; -1.905,-0.635; -0.635,-0.635; -3.175,0.635; -3.175,-0.635; 1.905,0.635; 3.175,0.635; 1.905,-0.635; 3.175,-0.635; 0.635,0.635; 0.635,-0.635
SD-LATCH = smd 0.8 x 1.5: 1 3.3,0; 2 2.2,0; 3 1.1,0; 4 0,0; 5 -1.1,0; 6 -2.2,0; 7 -3.3,0; 8 -4.4,0 | smd 1.45 x 2: G1 6.97,-2.6; G2 6.97,5.7; G3 -6.78,5.7; G4 -6.78,-2.6
SFW15S-2STE1LF = smd 0.6 x 1.85: 1 -7,-1.825; 2 -6,1.825; 3 -5,-1.825; 4 -4,1.825; 5 -3,-1.825; 6 -2,1.825; 7 -1,-1.825; 8 0,1.825; 9 1,-1.825; 10 2,1.825; 11 3,-1.825; 12 4,1.825; 13 5,-1.825; 14 6,1.825; 15 7,-1.825
SMA_BI = smd 2 x 2: 1 -2,0; 2 2,0
SOT323-3 = smd 0.6 x 0.55: 1 -0.65,-0.925; 2 0.65,-0.925; 3 0,0.925
SOT-23-3 = smd 1 x 1.4: 1 -0.95,-1.1; 2 0.95,-1.1; 3 0,1.1
SOD128 = smd 1.4 x 2.1: A -2.2,0; K 2.2,0
PESD0402-140 = smd 0.85 x 0.65: P$1 -0.625,0; P$2 0.625,0
DO-219AB-2 = smd 1.3 x 1.4: A 1.45,0; K -1.45,0
USON-10 = smd 0.565 x 0.2: 1 -0.417,1; 2 -0.417,0.5; 4 -0.417,-0.5; 5 -0.417,-1; 6 0.417,-1; 7 0.417,-0.5; 9 0.417,0.5; 10 0.417,1 | smd 0.565 x 0.3: 3 -0.417,0; 8 0.417,0 | smd 0.8 x 0.4: 38 0,0
SOD123 = smd 0.9 x 0.95: A 1.575,0; C -1.575,0
SOD-323 = smd 0.9 x 0.8: A 0.9,0; K -0.9,0
L0603 = smd 0.65 x 0.7: 1 -0.675,0; 2 0.675,0
L0402 = smd 0.5 x 0.5: 1 -0.508,0; 2 0.508,0
FIDU = smd 1.3 x 1.3: P$1 0,0
VQFN-20 = smd 0.25 x 0.6: 1 -0.75,2.15; 10 -0.75,-2.15; 11 0.75,-2.15; 20 0.75,2.15 | smd 0.6 x 0.25: 2 -1.65,1.75; 3 -1.65,1.25; 4 -1.65,0.75; 5 -1.65,0.25; 6 -1.65,-0.25; 7 -1.65,-0.75; 8 -1.65,-1.25; 9 -1.65,-1.75; 12 1.65,-1.75; 13 1.65,-1.25; 14 1.65,-0.75; 15 1.65,-0.25; 16 1.65,0.25; 17 1.65,0.75; 18 1.65,1.25; 19 1.65,1.75 | smd 1.7 x 2.7: 21 0,0
WQFN-16 = smd 0.6 x 0.24: 1 -1.4,0.75; 2 -1.4,0.25; 3 -1.4,-0.25; 4 -1.4,-0.75; 9 1.4,-0.75; 10 1.4,-0.25; 11 1.4,0.25; 12 1.4,0.75 | smd 0.24 x 0.6: 5 -0.75,-1.4; 6 -0.25,-1.4; 7 0.25,-1.4; 8 0.75,-1.4; 13 0.75,1.4; 14 0.25,1.4; 15 -0.25,1.4; 16 -0.75,1.4 | smd 1.68 x 1.68: 17 0,0
VQFN-56 = smd 0.6 x 0.25: 1 -3.897,3.25; 2 -3.897,2.75; 3 -3.897,2.25; 4 -3.897,1.75; 5 -3.897,1.25; 6 -3.897,0.75; 7 -3.897,0.25; 8 -3.897,-0.25; 9 -3.897,-0.75; 10 -3.897,-1.25; 11 -3.897,-1.75; 12 -3.897,-2.25; 13 -3.897,-2.75; 14 -3.897,-3.25; 29 3.897,-3.25; 30 3.897,-2.75; 31 3.897,-2.25; 32 3.897,-1.75; 33 3.897,-1.25; 34 3.897,-0.75; 35 3.897,-0.25; 36 3.897,0.25; 37 3.897,0.75; 38 3.897,1.25; 39 3.897,1.75; 40 3.897,2.25; 41 3.897,2.75; 42 3.897,3.25 | smd 0.25 x 0.6: 15 -3.25,-3.897; 16 -2.75,-3.897; 17 -2.25,-3.897; 18 -1.75,-3.897; 19 -1.25,-3.897; 20 -0.75,-3.897; 21 -0.25,-3.897; 22 0.25,-3.897; 23 0.75,-3.897; 24 1.25,-3.897; 25 1.75,-3.897; 26 2.25,-3.897; 27 2.75,-3.897; 28 3.25,-3.897; 43 3.25,3.897; 44 2.75,3.897; 45 2.25,3.897; 46 1.75,3.897; 47 1.25,3.897; 48 0.75,3.897; 49 0.25,3.897; 50 -0.25,3.897; 51 -0.75,3.897; 52 -1.25,3.897; 53 -1.75,3.897; 54 -2.25,3.897; 55 -2.75,3.897; 56 -3.25,3.897 | smd 5.5 x 5.5: 57 0,0
VSSOP-8(TEXAS) = smd 1.45 x 0.45: 1 -2.2,0.975; 2 -2.2,0.325; 3 -2.2,-0.325; 4 -2.2,-0.975; 5 2.2,-0.975; 6 2.2,-0.325; 7 2.2,0.325; 8 2.2,0.975
VSSOP-10 = smd 1.45 x 0.3: 1 -2.2,1; 2 -2.2,0.5; 3 -2.2,0; 4 -2.2,-0.5; 5 -2.2,-1; 6 2.2,-1; 7 2.2,-0.5; 8 2.2,0; 9 2.2,0.5; 10 2.2,1
VQFN-16_RXS = smd 0.6 x 0.25: 1A -1.175,1.5; 2 -1.175,1; 3 -1.175,0.5; 4 -1.175,0; 5 -1.175,-0.5; 6A -1.175,-1; 6B -1.175,-1.5; 8B 1.175,-1.5; 8C 1.175,-1; 9 1.175,-0.5; 10 1.175,0; 11 1.175,0.5; 12 1.175,1; 13A 1.175,1.5 | smd 0.25 x 0.6: 1B -1,1.675; 7A -0.5,-1.675; 7B 0,-1.675; 7C 0.5,-1.675; 13B 1,1.675; 14 0.5,1.675; 15 0,1.675; 16 -0.5,1.675 | smd 0.25 x 1.1: 6C -1,-1.425; 8A 1,-1.425 | smd 1.25 x 0.275: 7D 0,-1.512 | smd 1.25 x 2.25: 17 0,0
WQFN-24 = smd 0.6 x 0.24: 1 -1.9,1.25; 2 -1.9,0.75; 3 -1.9,0.25; 4 -1.9,-0.25; 5 -1.9,-0.75; 6 -1.9,-1.25; 13 1.9,-1.25; 14 1.9,-0.75; 15 1.9,-0.25; 16 1.9,0.25; 17 1.9,0.75; 18 1.9,1.25 | smd 0.24 x 0.6: 7 -1.25,-1.9; 8 -0.75,-1.9; 9 -0.25,-1.9; 10 0.25,-1.9; 11 0.75,-1.9; 12 1.25,-1.9; 19 1.25,1.9; 20 0.75,1.9; 21 0.25,1.9; 22 -0.25,1.9; 23 -0.75,1.9; 24 -1.25,1.9 | smd 2.45 x 2.45: 25 0,0
VQFN-24 = smd 0.6 x 0.25: 1 -1.9,1.25; 2 -1.9,0.75; 3 -1.9,0.25; 4 -1.9,-0.25; 5 -1.9,-0.75; 6 -1.9,-1.25; 13 1.9,-1.25; 14 1.9,-0.75; 15 1.9,-0.25; 16 1.9,0.25; 17 1.9,0.75; 18 1.9,1.25 | smd 0.25 x 0.6: 7 -1.25,-1.9; 8 -0.75,-1.9; 9 -0.25,-1.9; 10 0.25,-1.9; 11 0.75,-1.9; 12 1.25,-1.9; 19 1.25,1.9; 20 0.75,1.9; 21 0.25,1.9; 22 -0.25,1.9; 23 -0.75,1.9; 24 -1.25,1.9 | smd 2.8 x 2.8: 25 0,0 | smd 0.58 x 0.2: A11 -1.91,1.72; A21 -1.91,-1.72; A32 1.91,-1.72; A41 1.91,1.72 | smd 0.2 x 0.58: A12 -1.72,1.91; A22 -1.72,-1.91; A31 1.72,-1.91; A42 1.72,1.91
VSON-8 = smd 0.6 x 0.31: 1 -1.4,0.975; 2 -1.4,0.325; 3 -1.4,-0.325; 4 -1.4,-0.975; 5 1.4,-0.975; 6 1.4,-0.325; 7 1.4,0.325; 8 1.4,0.975 | smd 1.65 x 2.4: 9 0,0
FFVB1156_NSMD = smd 0.53 x 0.53: A1 -16.5,16.5; A2 -15.5,16.5; A3 -14.5,16.5; A4 -13.5,16.5; A5 -12.5,16.5; A6 -11.5,16.5; A7 -10.5,16.5; A8 -9.5,16.5; A9 -8.5,16.5; A10 -7.5,16.5; A11 -6.5,16.5; A12 -5.5,16.5; A13 -4.5,16.5; A14 -3.5,16.5; A15 -2.5,16.5; A16 -1.5,16.5; A17 -0.5,16.5; A18 0.5,16.5; A19 1.5,16.5; A20 2.5,16.5; A21 3.5,16.5; A22 4.5,16.5; A23 5.5,16.5; A24 6.5,16.5; A25 7.5,16.5; A26 8.5,16.5; A27 9.5,16.5; A28 10.5,16.5; A29 11.5,16.5; A30 12.5,16.5; A31 13.5,16.5; A32 14.5,16.5; A33 15.5,16.5; A34 16.5,16.5; AA1 -16.5,-3.5; AA2 -15.5,-3.5; AA3 -14.5,-3.5; AA4 -13.5,-3.5; AA5 -12.5,-3.5; AA6 -11.5,-3.5; AA7 -10.5,-3.5; AA8 -9.5,-3.5; AA9 -8.5,-3.5; AA10 -7.5,-3.5; AA11 -6.5,-3.5; AA12 -5.5,-3.5; AA13 -4.5,-3.5; AA14 -3.5,-3.5; AA15 -2.5,-3.5; AA16 -1.5,-3.5; AA17 -0.5,-3.5; AA18 0.5,-3.5; AA19 1.5,-3.5; AA20 2.5,-3.5; AA21 3.5,-3.5; AA22 4.5,-3.5; AA23 5.5,-3.5; AA24 6.5,-3.5; AA25 7.5,-3.5; AA26 8.5,-3.5; AA27 9.5,-3.5; AA28 10.5,-3.5; AA29 11.5,-3.5; AA30 12.5,-3.5; AA31 13.5,-3.5; AA32 14.5,-3.5; AA33 15.5,-3.5; AA34 16.5,-3.5; AB1 -16.5,-4.5; AB2 -15.5,-4.5; AB3 -14.5,-4.5; AB4 -13.5,-4.5; AB5 -12.5,-4.5; AB6 -11.5,-4.5; AB7 -10.5,-4.5; AB8 -9.5,-4.5; AB9 -8.5,-4.5; AB10 -7.5,-4.5; AB11 -6.5,-4.5; AB12 -5.5,-4.5; AB13 -4.5,-4.5; AB14 -3.5,-4.5; AB15 -2.5,-4.5; AB16 -1.5,-4.5; AB17 -0.5,-4.5; AB18 0.5,-4.5; AB19 1.5,-4.5; AB20 2.5,-4.5; AB21 3.5,-4.5; AB22 4.5,-4.5; AB23 5.5,-4.5; AB24 6.5,-4.5; AB25 7.5,-4.5; AB26 8.5,-4.5; AB27 9.5,-4.5; AB28 10.5,-4.5; AB29 11.5,-4.5; AB30 12.5,-4.5; AB31 13.5,-4.5; AB32 14.5,-4.5; AB33 15.5,-4.5; AB34 16.5,-4.5; AC1 -16.5,-5.5; AC2 -15.5,-5.5; AC3 -14.5,-5.5; AC4 -13.5,-5.5; AC5 -12.5,-5.5; AC6 -11.5,-5.5; AC7 -10.5,-5.5; AC8 -9.5,-5.5; AC9 -8.5,-5.5; AC10 -7.5,-5.5; AC11 -6.5,-5.5; AC12 -5.5,-5.5; AC13 -4.5,-5.5; AC14 -3.5,-5.5; AC15 -2.5,-5.5; AC16 -1.5,-5.5; AC17 -0.5,-5.5; AC18 0.5,-5.5; AC19 1.5,-5.5; AC20 2.5,-5.5; AC21 3.5,-5.5; AC22 4.5,-5.5; AC23 5.5,-5.5; AC24 6.5,-5.5; AC25 7.5,-5.5; AC26 8.5,-5.5; AC27 9.5,-5.5; AC28 10.5,-5.5; AC29 11.5,-5.5; AC30 12.5,-5.5; AC31 13.5,-5.5; AC32 14.5,-5.5; AC33 15.5,-5.5; AC34 16.5,-5.5; AD1 -16.5,-6.5; AD2 -15.5,-6.5; AD3 -14.5,-6.5; AD4 -13.5,-6.5; AD5 -12.5,-6.5; AD6 -11.5,-6.5; AD7 -10.5,-6.5; AD8 -9.5,-6.5; AD9 -8.5,-6.5; AD10 -7.5,-6.5; AD11 -6.5,-6.5; AD12 -5.5,-6.5; AD13 -4.5,-6.5; AD14 -3.5,-6.5; AD15 -2.5,-6.5; AD16 -1.5,-6.5; AD17 -0.5,-6.5; AD18 0.5,-6.5; AD19 1.5,-6.5; AD20 2.5,-6.5; AD21 3.5,-6.5; AD22 4.5,-6.5; AD23 5.5,-6.5; AD24 6.5,-6.5; AD25 7.5,-6.5; AD26 8.5,-6.5; AD27 9.5,-6.5; AD28 10.5,-6.5; AD29 11.5,-6.5; AD30 12.5,-6.5; AD31 13.5,-6.5; AD32 14.5,-6.5; AD33 15.5,-6.5; AD34 16.5,-6.5; AE1 -16.5,-7.5; AE2 -15.5,-7.5; AE3 -14.5,-7.5; AE4 -13.5,-7.5; AE5 -12.5,-7.5; AE6 -11.5,-7.5; AE7 -10.5,-7.5; AE8 -9.5,-7.5; AE9 -8.5,-7.5; AE10 -7.5,-7.5; AE11 -6.5,-7.5; AE12 -5.5,-7.5; AE13 -4.5,-7.5; AE14 -3.5,-7.5; AE15 -2.5,-7.5; AE16 -1.5,-7.5; AE17 -0.5,-7.5; AE18 0.5,-7.5; AE19 1.5,-7.5; AE20 2.5,-7.5; AE21 3.5,-7.5; AE22 4.5,-7.5; AE23 5.5,-7.5; AE24 6.5,-7.5; AE25 7.5,-7.5; AE26 8.5,-7.5; AE27 9.5,-7.5; AE28 10.5,-7.5; AE29 11.5,-7.5; AE30 12.5,-7.5; AE31 13.5,-7.5; AE32 14.5,-7.5; AE33 15.5,-7.5; AE34 16.5,-7.5; AF1 -16.5,-8.5; AF2 -15.5,-8.5; AF3 -14.5,-8.5; AF4 -13.5,-8.5; AF5 -12.5,-8.5; AF6 -11.5,-8.5; AF7 -10.5,-8.5; AF8 -9.5,-8.5; AF9 -8.5,-8.5; AF10 -7.5,-8.5; AF11 -6.5,-8.5; AF12 -5.5,-8.5; AF13 -4.5,-8.5; AF14 -3.5,-8.5; AF15 -2.5,-8.5; AF16 -1.5,-8.5; AF17 -0.5,-8.5; AF18 0.5,-8.5; AF19 1.5,-8.5; AF20 2.5,-8.5; AF21 3.5,-8.5; AF22 4.5,-8.5; AF23 5.5,-8.5; AF24 6.5,-8.5; AF25 7.5,-8.5; AF26 8.5,-8.5; AF27 9.5,-8.5; AF28 10.5,-8.5; AF29 11.5,-8.5; AF30 12.5,-8.5; AF31 13.5,-8.5; AF32 14.5,-8.5; AF33 15.5,-8.5; AF34 16.5,-8.5; AG1 -16.5,-9.5; AG2 -15.5,-9.5; AG3 -14.5,-9.5; AG4 -13.5,-9.5; AG5 -12.5,-9.5; AG6 -11.5,-9.5; AG7 -10.5,-9.5; AG8 -9.5,-9.5; AG9 -8.5,-9.5; AG10 -7.5,-9.5; AG11 -6.5,-9.5; AG12 -5.5,-9.5; AG13 -4.5,-9.5; AG14 -3.5,-9.5; AG15 -2.5,-9.5; AG16 -1.5,-9.5; AG17 -0.5,-9.5; AG18 0.5,-9.5; AG19 1.5,-9.5; AG20 2.5,-9.5; AG21 3.5,-9.5; AG22 4.5,-9.5; AG23 5.5,-9.5; AG24 6.5,-9.5; AG25 7.5,-9.5; AG26 8.5,-9.5; AG27 9.5,-9.5; AG28 10.5,-9.5; AG29 11.5,-9.5; AG30 12.5,-9.5; AG31 13.5,-9.5; AG32 14.5,-9.5; AG33 15.5,-9.5; AG34 16.5,-9.5; AH1 -16.5,-10.5; AH2 -15.5,-10.5; AH3 -14.5,-10.5; AH4 -13.5,-10.5; AH5 -12.5,-10.5; AH6 -11.5,-10.5; AH7 -10.5,-10.5; AH8 -9.5,-10.5; AH9 -8.5,-10.5; AH10 -7.5,-10.5; AH11 -6.5,-10.5; AH12 -5.5,-10.5; AH13 -4.5,-10.5; AH14 -3.5,-10.5; AH15 -2.5,-10.5; AH16 -1.5,-10.5; AH17 -0.5,-10.5; AH18 0.5,-10.5; AH19 1.5,-10.5; AH20 2.5,-10.5; AH21 3.5,-10.5; AH22 4.5,-10.5; AH23 5.5,-10.5; AH24 6.5,-10.5; AH25 7.5,-10.5; AH26 8.5,-10.5; AH27 9.5,-10.5; AH28 10.5,-10.5; AH29 11.5,-10.5; AH30 12.5,-10.5; AH31 13.5,-10.5; AH32 14.5,-10.5; AH33 15.5,-10.5; AH34 16.5,-10.5; AJ1 -16.5,-11.5; AJ2 -15.5,-11.5; AJ3 -14.5,-11.5; AJ4 -13.5,-11.5; AJ5 -12.5,-11.5; AJ6 -11.5,-11.5; AJ7 -10.5,-11.5; AJ8 -9.5,-11.5; AJ9 -8.5,-11.5; AJ10 -7.5,-11.5; AJ11 -6.5,-11.5; AJ12 -5.5,-11.5; AJ13 -4.5,-11.5; AJ14 -3.5,-11.5; AJ15 -2.5,-11.5; AJ16 -1.5,-11.5; AJ17 -0.5,-11.5; AJ18 0.5,-11.5; AJ19 1.5,-11.5; AJ20 2.5,-11.5; AJ21 3.5,-11.5; AJ22 4.5,-11.5; AJ23 5.5,-11.5; AJ24 6.5,-11.5; AJ25 7.5,-11.5; AJ26 8.5,-11.5; AJ27 9.5,-11.5; AJ28 10.5,-11.5; AJ29 11.5,-11.5; AJ30 12.5,-11.5; AJ31 13.5,-11.5; AJ32 14.5,-11.5; AJ33 15.5,-11.5; AJ34 16.5,-11.5; AK1 -16.5,-12.5; AK2 -15.5,-12.5; AK3 -14.5,-12.5; AK4 -13.5,-12.5; AK5 -12.5,-12.5; AK6 -11.5,-12.5; AK7 -10.5,-12.5; AK8 -9.5,-12.5; AK9 -8.5,-12.5; AK10 -7.5,-12.5; AK11 -6.5,-12.5; AK12 -5.5,-12.5; AK13 -4.5,-12.5; AK14 -3.5,-12.5; AK15 -2.5,-12.5; AK16 -1.5,-12.5; AK17 -0.5,-12.5; AK18 0.5,-12.5; AK19 1.5,-12.5; AK20 2.5,-12.5; AK21 3.5,-12.5; AK22 4.5,-12.5; AK23 5.5,-12.5; AK24 6.5,-12.5; AK25 7.5,-12.5; AK26 8.5,-12.5; AK27 9.5,-12.5; AK28 10.5,-12.5; AK29 11.5,-12.5; AK30 12.5,-12.5; AK31 13.5,-12.5; AK32 14.5,-12.5; AK33 15.5,-12.5; AK34 16.5,-12.5; AL1 -16.5,-13.5; AL2 -15.5,-13.5; AL3 -14.5,-13.5; AL4 -13.5,-13.5; AL5 -12.5,-13.5; AL6 -11.5,-13.5; AL7 -10.5,-13.5; AL8 -9.5,-13.5; AL9 -8.5,-13.5; AL10 -7.5,-13.5; AL11 -6.5,-13.5; AL12 -5.5,-13.5; AL13 -4.5,-13.5; AL14 -3.5,-13.5; AL15 -2.5,-13.5; AL16 -1.5,-13.5; AL17 -0.5,-13.5; AL18 0.5,-13.5; AL19 1.5,-13.5; AL20 2.5,-13.5; AL21 3.5,-13.5; AL22 4.5,-13.5; AL23 5.5,-13.5; AL24 6.5,-13.5; AL25 7.5,-13.5; AL26 8.5,-13.5; AL27 9.5,-13.5; AL28 10.5,-13.5; AL29 11.5,-13.5; AL30 12.5,-13.5; AL31 13.5,-13.5; AL32 14.5,-13.5; AL33 15.5,-13.5; AL34 16.5,-13.5; AM1 -16.5,-14.5; AM2 -15.5,-14.5; AM3 -14.5,-14.5; AM4 -13.5,-14.5; AM5 -12.5,-14.5; AM6 -11.5,-14.5; AM7 -10.5,-14.5; AM8 -9.5,-14.5; AM9 -8.5,-14.5; AM10 -7.5,-14.5; AM11 -6.5,-14.5; AM12 -5.5,-14.5; AM13 -4.5,-14.5; AM14 -3.5,-14.5; AM15 -2.5,-14.5; AM16 -1.5,-14.5; AM17 -0.5,-14.5; AM18 0.5,-14.5; AM19 1.5,-14.5; AM20 2.5,-14.5; AM21 3.5,-14.5; AM22 4.5,-14.5; AM23 5.5,-14.5; AM24 6.5,-14.5; AM25 7.5,-14.5; AM26 8.5,-14.5; AM27 9.5,-14.5; AM28 10.5,-14.5; AM29 11.5,-14.5; AM30 12.5,-14.5; AM31 13.5,-14.5; AM32 14.5,-14.5; AM33 15.5,-14.5; AM34 16.5,-14.5; AN1 -16.5,-15.5; AN2 -15.5,-15.5; AN3 -14.5,-15.5; AN4 -13.5,-15.5; AN5 -12.5,-15.5; AN6 -11.5,-15.5; AN7 -10.5,-15.5; AN8 -9.5,-15.5; AN9 -8.5,-15.5; AN10 -7.5,-15.5; AN11 -6.5,-15.5; AN12 -5.5,-15.5; AN13 -4.5,-15.5; AN14 -3.5,-15.5; AN15 -2.5,-15.5; AN16 -1.5,-15.5; AN17 -0.5,-15.5; AN18 0.5,-15.5; AN19 1.5,-15.5; AN20 2.5,-15.5; AN21 3.5,-15.5; AN22 4.5,-15.5; AN23 5.5,-15.5; AN24 6.5,-15.5; AN25 7.5,-15.5; AN26 8.5,-15.5; AN27 9.5,-15.5; AN28 10.5,-15.5; AN29 11.5,-15.5; AN30 12.5,-15.5; AN31 13.5,-15.5; AN32 14.5,-15.5; AN33 15.5,-15.5; AN34 16.5,-15.5; AP1 -16.5,-16.5; AP2 -15.5,-16.5; AP3 -14.5,-16.5; AP4 -13.5,-16.5; AP5 -12.5,-16.5; AP6 -11.5,-16.5; AP7 -10.5,-16.5; AP8 -9.5,-16.5; AP9 -8.5,-16.5; AP10 -7.5,-16.5; AP11 -6.5,-16.5; AP12 -5.5,-16.5; AP13 -4.5,-16.5; AP14 -3.5,-16.5; AP15 -2.5,-16.5; AP16 -1.5,-16.5; AP17 -0.5,-16.5; AP18 0.5,-16.5; AP19 1.5,-16.5; AP20 2.5,-16.5; AP21 3.5,-16.5; AP22 4.5,-16.5; AP23 5.5,-16.5; AP24 6.5,-16.5; AP25 7.5,-16.5; AP26 8.5,-16.5; AP27 9.5,-16.5; AP28 10.5,-16.5; AP29 11.5,-16.5; AP30 12.5,-16.5; AP31 13.5,-16.5; AP32 14.5,-16.5; AP33 15.5,-16.5; AP34 16.5,-16.5; B1 -16.5,15.5; B2 -15.5,15.5; B3 -14.5,15.5; B4 -13.5,15.5; B5 -12.5,15.5; B6 -11.5,15.5; B7 -10.5,15.5; B8 -9.5,15.5; B9 -8.5,15.5; B10 -7.5,15.5; B11 -6.5,15.5; B12 -5.5,15.5; B13 -4.5,15.5; B14 -3.5,15.5; B15 -2.5,15.5; B16 -1.5,15.5; B17 -0.5,15.5; B18 0.5,15.5; B19 1.5,15.5; B20 2.5,15.5; B21 3.5,15.5; B22 4.5,15.5; B23 5.5,15.5; B24 6.5,15.5; B25 7.5,15.5; B26 8.5,15.5; B27 9.5,15.5; B28 10.5,15.5; B29 11.5,15.5; B30 12.5,15.5; B31 13.5,15.5; B32 14.5,15.5; B33 15.5,15.5; B34 16.5,15.5; C1 -16.5,14.5; C2 -15.5,14.5; C3 -14.5,14.5; C4 -13.5,14.5; C5 -12.5,14.5; C6 -11.5,14.5; C7 -10.5,14.5; C8 -9.5,14.5; C9 -8.5,14.5; C10 -7.5,14.5; C11 -6.5,14.5; C12 -5.5,14.5; C13 -4.5,14.5; C14 -3.5,14.5; C15 -2.5,14.5; C16 -1.5,14.5; C17 -0.5,14.5; C18 0.5,14.5; C19 1.5,14.5; C20 2.5,14.5; C21 3.5,14.5; C22 4.5,14.5; C23 5.5,14.5; C24 6.5,14.5; C25 7.5,14.5; C26 8.5,14.5; C27 9.5,14.5; C28 10.5,14.5; C29 11.5,14.5; C30 12.5,14.5; C31 13.5,14.5; C32 14.5,14.5; C33 15.5,14.5; C34 16.5,14.5; D1 -16.5,13.5; D2 -15.5,13.5; D3 -14.5,13.5; D4 -13.5,13.5; D5 -12.5,13.5; D6 -11.5,13.5; D7 -10.5,13.5; D8 -9.5,13.5; D9 -8.5,13.5; D10 -7.5,13.5; D11 -6.5,13.5; D12 -5.5,13.5; D13 -4.5,13.5; D14 -3.5,13.5; D15 -2.5,13.5; D16 -1.5,13.5; D17 -0.5,13.5; D18 0.5,13.5; D19 1.5,13.5; D20 2.5,13.5; D21 3.5,13.5; D22 4.5,13.5; D23 5.5,13.5; D24 6.5,13.5; D25 7.5,13.5; D26 8.5,13.5; D27 9.5,13.5; D28 10.5,13.5; D29 11.5,13.5; D30 12.5,13.5; D31 13.5,13.5; D32 14.5,13.5; D33 15.5,13.5; D34 16.5,13.5; E1 -16.5,12.5; E2 -15.5,12.5; E3 -14.5,12.5; E4 -13.5,12.5; E5 -12.5,12.5; E6 -11.5,12.5; E7 -10.5,12.5; E8 -9.5,12.5; E9 -8.5,12.5; E10 -7.5,12.5; E11 -6.5,12.5; E12 -5.5,12.5; E13 -4.5,12.5; E14 -3.5,12.5; E15 -2.5,12.5; E16 -1.5,12.5; E17 -0.5,12.5; E18 0.5,12.5; E19 1.5,12.5; E20 2.5,12.5; E21 3.5,12.5; E22 4.5,12.5; E23 5.5,12.5; E24 6.5,12.5; E25 7.5,12.5; E26 8.5,12.5; E27 9.5,12.5; E28 10.5,12.5; E29 11.5,12.5; E30 12.5,12.5; E31 13.5,12.5; E32 14.5,12.5; E33 15.5,12.5; E34 16.5,12.5; F1 -16.5,11.5; F2 -15.5,11.5; F3 -14.5,11.5; F4 -13.5,11.5; F5 -12.5,11.5; F6 -11.5,11.5; F7 -10.5,11.5; F8 -9.5,11.5; F9 -8.5,11.5; F10 -7.5,11.5; F11 -6.5,11.5; F12 -5.5,11.5; F13 -4.5,11.5; F14 -3.5,11.5; F15 -2.5,11.5; F16 -1.5,11.5; F17 -0.5,11.5; F18 0.5,11.5; F19 1.5,11.5; F20 2.5,11.5; F21 3.5,11.5; F22 4.5,11.5; F23 5.5,11.5; F24 6.5,11.5; F25 7.5,11.5; F26 8.5,11.5; F27 9.5,11.5; F28 10.5,11.5; F29 11.5,11.5; F30 12.5,11.5; F31 13.5,11.5; F32 14.5,11.5; F33 15.5,11.5; F34 16.5,11.5; G1 -16.5,10.5; G2 -15.5,10.5; G3 -14.5,10.5; G4 -13.5,10.5; G5 -12.5,10.5; G6 -11.5,10.5; G7 -10.5,10.5; G8 -9.5,10.5; G9 -8.5,10.5; G10 -7.5,10.5; G11 -6.5,10.5; G12 -5.5,10.5; G13 -4.5,10.5; G14 -3.5,10.5; G15 -2.5,10.5; G16 -1.5,10.5; G17 -0.5,10.5; G18 0.5,10.5; G19 1.5,10.5; G20 2.5,10.5; G21 3.5,10.5; G22 4.5,10.5; G23 5.5,10.5; G24 6.5,10.5; G25 7.5,10.5; G26 8.5,10.5; G27 9.5,10.5; G28 10.5,10.5; G29 11.5,10.5; G30 12.5,10.5; G31 13.5,10.5; G32 14.5,10.5; G33 15.5,10.5; G34 16.5,10.5; H1 -16.5,9.5; H2 -15.5,9.5; H3 -14.5,9.5; H4 -13.5,9.5; H5 -12.5,9.5; H6 -11.5,9.5; H7 -10.5,9.5; H8 -9.5,9.5; H9 -8.5,9.5; H10 -7.5,9.5; H11 -6.5,9.5; H12 -5.5,9.5; H13 -4.5,9.5; H14 -3.5,9.5; H15 -2.5,9.5; H16 -1.5,9.5; H17 -0.5,9.5; H18 0.5,9.5; H19 1.5,9.5; H20 2.5,9.5; H21 3.5,9.5; H22 4.5,9.5; H23 5.5,9.5; H24 6.5,9.5; H25 7.5,9.5; H26 8.5,9.5; H27 9.5,9.5; H28 10.5,9.5; H29 11.5,9.5; H30 12.5,9.5; H31 13.5,9.5; H32 14.5,9.5; H33 15.5,9.5; H34 16.5,9.5; J1 -16.5,8.5; J2 -15.5,8.5; J3 -14.5,8.5; J4 -13.5,8.5; J5 -12.5,8.5; J6 -11.5,8.5; J7 -10.5,8.5; J8 -9.5,8.5; J9 -8.5,8.5; J10 -7.5,8.5; J11 -6.5,8.5; J12 -5.5,8.5; J13 -4.5,8.5; J14 -3.5,8.5; J15 -2.5,8.5; J16 -1.5,8.5; J17 -0.5,8.5; J18 0.5,8.5; J19 1.5,8.5; J20 2.5,8.5; J21 3.5,8.5; J22 4.5,8.5; J23 5.5,8.5; J24 6.5,8.5; J25 7.5,8.5; J26 8.5,8.5; J27 9.5,8.5; J28 10.5,8.5; J29 11.5,8.5; J30 12.5,8.5; J31 13.5,8.5; J32 14.5,8.5; J33 15.5,8.5; J34 16.5,8.5; K1 -16.5,7.5; K2 -15.5,7.5; K3 -14.5,7.5; K4 -13.5,7.5; K5 -12.5,7.5; K6 -11.5,7.5; K7 -10.5,7.5; K8 -9.5,7.5; K9 -8.5,7.5; K10 -7.5,7.5; K11 -6.5,7.5; K12 -5.5,7.5; K13 -4.5,7.5; K14 -3.5,7.5; K15 -2.5,7.5; K16 -1.5,7.5; K17 -0.5,7.5; K18 0.5,7.5; K19 1.5,7.5; K20 2.5,7.5; K21 3.5,7.5; K22 4.5,7.5; K23 5.5,7.5; K24 6.5,7.5; K25 7.5,7.5; K26 8.5,7.5; K27 9.5,7.5; K28 10.5,7.5; K29 11.5,7.5; K30 12.5,7.5; K31 13.5,7.5; K32 14.5,7.5; K33 15.5,7.5; K34 16.5,7.5; L1 -16.5,6.5; L2 -15.5,6.5; L3 -14.5,6.5; L4 -13.5,6.5; L5 -12.5,6.5; L6 -11.5,6.5; L7 -10.5,6.5; L8 -9.5,6.5; L9 -8.5,6.5; L10 -7.5,6.5; L11 -6.5,6.5; L12 -5.5,6.5; L13 -4.5,6.5; L14 -3.5,6.5; L15 -2.5,6.5; L16 -1.5,6.5; L17 -0.5,6.5; L18 0.5,6.5; L19 1.5,6.5; L20 2.5,6.5; L21 3.5,6.5; L22 4.5,6.5; L23 5.5,6.5; L24 6.5,6.5; L25 7.5,6.5; L26 8.5,6.5; L27 9.5,6.5; L28 10.5,6.5; L29 11.5,6.5; L30 12.5,6.5; L31 13.5,6.5; L32 14.5,6.5; L33 15.5,6.5; L34 16.5,6.5; M1 -16.5,5.5; M2 -15.5,5.5; M3 -14.5,5.5; M4 -13.5,5.5; M5 -12.5,5.5; M6 -11.5,5.5; M7 -10.5,5.5; M8 -9.5,5.5; M9 -8.5,5.5; M10 -7.5,5.5; M11 -6.5,5.5; M12 -5.5,5.5; M13 -4.5,5.5; M14 -3.5,5.5; M15 -2.5,5.5; M16 -1.5,5.5; M17 -0.5,5.5; M18 0.5,5.5; M19 1.5,5.5; M20 2.5,5.5; M21 3.5,5.5; M22 4.5,5.5; M23 5.5,5.5; M24 6.5,5.5; M25 7.5,5.5; M26 8.5,5.5; M27 9.5,5.5; M28 10.5,5.5; M29 11.5,5.5; M30 12.5,5.5; M31 13.5,5.5; M32 14.5,5.5; M33 15.5,5.5; M34 16.5,5.5; N1 -16.5,4.5; N2 -15.5,4.5; N3 -14.5,4.5; N4 -13.5,4.5; N5 -12.5,4.5; N6 -11.5,4.5; N7 -10.5,4.5; N8 -9.5,4.5; N9 -8.5,4.5; N10 -7.5,4.5; N11 -6.5,4.5; N12 -5.5,4.5; N13 -4.5,4.5; N14 -3.5,4.5; N15 -2.5,4.5; N16 -1.5,4.5; N17 -0.5,4.5; N18 0.5,4.5; N19 1.5,4.5; N20 2.5,4.5; N21 3.5,4.5; N22 4.5,4.5; N23 5.5,4.5; N24 6.5,4.5; N25 7.5,4.5; N26 8.5,4.5; N27 9.5,4.5; N28 10.5,4.5; N29 11.5,4.5; N30 12.5,4.5; N31 13.5,4.5; N32 14.5,4.5; N33 15.5,4.5; N34 16.5,4.5; P1 -16.5,3.5; P2 -15.5,3.5; P3 -14.5,3.5; P4 -13.5,3.5; P5 -12.5,3.5; P6 -11.5,3.5; P7 -10.5,3.5; P8 -9.5,3.5; P9 -8.5,3.5; P10 -7.5,3.5; P11 -6.5,3.5; P12 -5.5,3.5; P13 -4.5,3.5; P14 -3.5,3.5; P15 -2.5,3.5; P16 -1.5,3.5; P17 -0.5,3.5; P18 0.5,3.5; P19 1.5,3.5; P20 2.5,3.5; P21 3.5,3.5; P22 4.5,3.5; P23 5.5,3.5; P24 6.5,3.5; P25 7.5,3.5; P26 8.5,3.5; P27 9.5,3.5; P28 10.5,3.5; P29 11.5,3.5; P30 12.5,3.5; P31 13.5,3.5; P32 14.5,3.5; P33 15.5,3.5; P34 16.5,3.5; R1 -16.5,2.5; R2 -15.5,2.5; R3 -14.5,2.5; R4 -13.5,2.5; R5 -12.5,2.5; R6 -11.5,2.5; R7 -10.5,2.5; R8 -9.5,2.5; R9 -8.5,2.5; R10 -7.5,2.5; R11 -6.5,2.5; R12 -5.5,2.5; R13 -4.5,2.5; R14 -3.5,2.5; R15 -2.5,2.5; R16 -1.5,2.5; R17 -0.5,2.5; R18 0.5,2.5; R19 1.5,2.5; R20 2.5,2.5; R21 3.5,2.5; R22 4.5,2.5; R23 5.5,2.5; R24 6.5,2.5; R25 7.5,2.5; R26 8.5,2.5; R27 9.5,2.5; R28 10.5,2.5; R29 11.5,2.5; R30 12.5,2.5; R31 13.5,2.5; R32 14.5,2.5; R33 15.5,2.5; R34 16.5,2.5; T1 -16.5,1.5; T2 -15.5,1.5; T3 -14.5,1.5; T4 -13.5,1.5; T5 -12.5,1.5; T6 -11.5,1.5; T7 -10.5,1.5; T8 -9.5,1.5; T9 -8.5,1.5; T10 -7.5,1.5; T11 -6.5,1.5; T12 -5.5,1.5; T13 -4.5,1.5; T14 -3.5,1.5; T15 -2.5,1.5; T16 -1.5,1.5; T17 -0.5,1.5; T18 0.5,1.5; T19 1.5,1.5; T20 2.5,1.5; T21 3.5,1.5; T22 4.5,1.5; T23 5.5,1.5; T24 6.5,1.5; T25 7.5,1.5; T26 8.5,1.5; T27 9.5,1.5; T28 10.5,1.5; T29 11.5,1.5; T30 12.5,1.5; T31 13.5,1.5; T32 14.5,1.5; T33 15.5,1.5; T34 16.5,1.5; U1 -16.5,0.5; U2 -15.5,0.5; U3 -14.5,0.5; U4 -13.5,0.5; U5 -12.5,0.5; U6 -11.5,0.5; U7 -10.5,0.5; U8 -9.5,0.5; U9 -8.5,0.5; U10 -7.5,0.5; U11 -6.5,0.5; U12 -5.5,0.5; U13 -4.5,0.5; U14 -3.5,0.5; U15 -2.5,0.5; U16 -1.5,0.5; U17 -0.5,0.5; U18 0.5,0.5; U19 1.5,0.5; U20 2.5,0.5; U21 3.5,0.5; U22 4.5,0.5; U23 5.5,0.5; U24 6.5,0.5; U25 7.5,0.5; U26 8.5,0.5; U27 9.5,0.5; U28 10.5,0.5; U29 11.5,0.5; U30 12.5,0.5; U31 13.5,0.5; U32 14.5,0.5; U33 15.5,0.5; U34 16.5,0.5; V1 -16.5,-0.5; V2 -15.5,-0.5; V3 -14.5,-0.5; V4 -13.5,-0.5; V5 -12.5,-0.5; V6 -11.5,-0.5; V7 -10.5,-0.5; V8 -9.5,-0.5; V9 -8.5,-0.5; V10 -7.5,-0.5; V11 -6.5,-0.5; V12 -5.5,-0.5; V13 -4.5,-0.5; V14 -3.5,-0.5; V15 -2.5,-0.5; V16 -1.5,-0.5; V17 -0.5,-0.5; V18 0.5,-0.5; V19 1.5,-0.5; V20 2.5,-0.5; V21 3.5,-0.5; V22 4.5,-0.5; V23 5.5,-0.5; V24 6.5,-0.5; V25 7.5,-0.5; V26 8.5,-0.5; V27 9.5,-0.5; V28 10.5,-0.5; V29 11.5,-0.5; V30 12.5,-0.5; V31 13.5,-0.5; V32 14.5,-0.5; V33 15.5,-0.5; V34 16.5,-0.5; W1 -16.5,-1.5; W2 -15.5,-1.5; W3 -14.5,-1.5; W4 -13.5,-1.5; W5 -12.5,-1.5; W6 -11.5,-1.5; W7 -10.5,-1.5; W8 -9.5,-1.5; W9 -8.5,-1.5; W10 -7.5,-1.5; W11 -6.5,-1.5; W12 -5.5,-1.5; W13 -4.5,-1.5; W14 -3.5,-1.5; W15 -2.5,-1.5; W16 -1.5,-1.5; W17 -0.5,-1.5; W18 0.5,-1.5; W19 1.5,-1.5; W20 2.5,-1.5; W21 3.5,-1.5; W22 4.5,-1.5; W23 5.5,-1.5; W24 6.5,-1.5; W25 7.5,-1.5; W26 8.5,-1.5; W27 9.5,-1.5; W28 10.5,-1.5; W29 11.5,-1.5; W30 12.5,-1.5; W31 13.5,-1.5; W32 14.5,-1.5; W33 15.5,-1.5; W34 16.5,-1.5; Y1 -16.5,-2.5; Y2 -15.5,-2.5; Y3 -14.5,-2.5; Y4 -13.5,-2.5; Y5 -12.5,-2.5; Y6 -11.5,-2.5; Y7 -10.5,-2.5; Y8 -9.5,-2.5; Y9 -8.5,-2.5; Y10 -7.5,-2.5; Y11 -6.5,-2.5; Y12 -5.5,-2.5; Y13 -4.5,-2.5; Y14 -3.5,-2.5; Y15 -2.5,-2.5; Y16 -1.5,-2.5; Y17 -0.5,-2.5; Y18 0.5,-2.5; Y19 1.5,-2.5; Y20 2.5,-2.5; Y21 3.5,-2.5; Y22 4.5,-2.5; Y23 5.5,-2.5; Y24 6.5,-2.5; Y25 7.5,-2.5; Y26 8.5,-2.5; Y27 9.5,-2.5; Y28 10.5,-2.5; Y29 11.5,-2.5; Y30 12.5,-2.5; Y31 13.5,-2.5; Y32 14.5,-2.5; Y33 15.5,-2.5; Y34 16.5,-2.5
DCK5 = smd 0.85 x 0.35: 1 -1.1,0.65; 2 -1.1,0; 3 -1.1,-0.65; 4 1.1,-0.65; 5 1.1,0.65
WSON-8 = smd 0.8 x 0.25: 1 -0.8,0.75 | smd 0.7 x 0.25: 2 -0.85,0.25; 3 -0.85,-0.25; 4 -0.85,-0.75; 5 0.85,-0.75; 6 0.85,-0.25; 7 0.85,0.25; 8 0.85,0.75
FBGA96_NSMD_MICRON = smd 0.376 x 0.376: A1 -3.2,6; A2 -2.4,6; A3 -1.6,6; A7 1.6,6; A8 2.4,6; A9 3.2,6; B1 -3.2,5.2; B2 -2.4,5.2; B3 -1.6,5.2; B7 1.6,5.2; B8 2.4,5.2; B9 3.2,5.2; C1 -3.2,4.4; C2 -2.4,4.4; C3 -1.6,4.4; C7 1.6,4.4; C8 2.4,4.4; C9 3.2,4.4; D1 -3.2,3.6; D2 -2.4,3.6; D3 -1.6,3.6; D7 1.6,3.6; D8 2.4,3.6; D9 3.2,3.6; E1 -3.2,2.8; E2 -2.4,2.8; E3 -1.6,2.8; E7 1.6,2.8; E8 2.4,2.8; E9 3.2,2.8; F1 -3.2,2; F2 -2.4,2; F3 -1.6,2; F7 1.6,2; F8 2.4,2; F9 3.2,2; G1 -3.2,1.2; G2 -2.4,1.2; G3 -1.6,1.2; G7 1.6,1.2; G8 2.4,1.2; G9 3.2,1.2; H1 -3.2,0.4; H2 -2.4,0.4; H3 -1.6,0.4; H7 1.6,0.4; H8 2.4,0.4; H9 3.2,0.4; J1 -3.2,-0.4; J2 -2.4,-0.4; J3 -1.6,-0.4; J7 1.6,-0.4; J8 2.4,-0.4; J9 3.2,-0.4; K1 -3.2,-1.2; K2 -2.4,-1.2; K3 -1.6,-1.2; K7 1.6,-1.2; K8 2.4,-1.2; K9 3.2,-1.2; L1 -3.2,-2; L2 -2.4,-2; L3 -1.6,-2; L7 1.6,-2; L8 2.4,-2; L9 3.2,-2; M1 -3.2,-2.8; M2 -2.4,-2.8; M3 -1.6,-2.8; M7 1.6,-2.8; M8 2.4,-2.8; M9 3.2,-2.8; N1 -3.2,-3.6; N2 -2.4,-3.6; N3 -1.6,-3.6; N7 1.6,-3.6; N8 2.4,-3.6; N9 3.2,-3.6; P1 -3.2,-4.4; P2 -2.4,-4.4; P3 -1.6,-4.4; P7 1.6,-4.4; P8 2.4,-4.4; P9 3.2,-4.4; R1 -3.2,-5.2; R2 -2.4,-5.2; R3 -1.6,-5.2; R7 1.6,-5.2; R8 2.4,-5.2; R9 3.2,-5.2; T1 -3.2,-6; T2 -2.4,-6; T3 -1.6,-6; T7 1.6,-6; T8 2.4,-6; T9 3.2,-6
XQFN16 = smd 0.9 x 0.22: 1 -0.6,0.6 | smd 0.85 x 0.22: 2 -0.625,0.2; 3 -0.625,-0.2; 4 -0.625,-0.6; 9 0.625,-0.6; 10 0.625,-0.2; 11 0.625,0.2; 12 0.625,0.6 | smd 0.22 x 0.55: 5 -0.6,-1.175; 6 -0.2,-1.175; 7 0.2,-1.175; 8 0.6,-1.175; 13 0.6,1.175; 14 0.2,1.175; 15 -0.2,1.175; 16 -0.6,1.175
DSBGA-4_YZV = smd 0.27 x 0.27: A1 -0.25,0.25; A2 0.25,0.25; B1 -0.25,-0.25; B2 0.25,-0.25
SOIC14_D_TEX = smd 1.46 x 0.559: 1 -2.724,3.81; 2 -2.724,2.54; 3 -2.724,1.27; 4 -2.724,0; 5 -2.724,-1.27; 6 -2.724,-2.54; 7 -2.724,-3.81; 8 2.724,-3.81; 9 2.724,-2.54; 10 2.724,-1.27; 11 2.724,0; 12 2.724,1.27; 13 2.724,2.54; 14 2.724,3.81
TSSOP-16(TEXAS) = smd 0.45 x 1.5: 1 -2.275,-2.9; 2 -1.625,-2.9; 3 -0.975,-2.9; 4 -0.325,-2.9; 5 0.325,-2.9; 6 0.975,-2.9; 7 1.625,-2.9; 8 2.275,-2.9; 9 2.275,2.9; 10 1.625,2.9; 11 0.975,2.9; 12 0.325,2.9; 13 -0.325,2.9; 14 -0.975,2.9; 15 -1.625,2.9; 16 -2.275,2.9
VQFN-48 = smd 0.6 x 0.24: 1 -3.4,2.75; 2 -3.4,2.25; 3 -3.4,1.75; 4 -3.4,1.25; 5 -3.4,0.75; 6 -3.4,0.25; 7 -3.4,-0.25; 8 -3.4,-0.75; 9 -3.4,-1.25; 10 -3.4,-1.75; 11 -3.4,-2.25; 12 -3.4,-2.75; 25 3.4,-2.75; 26 3.4,-2.25; 27 3.4,-1.75; 28 3.4,-1.25; 29 3.4,-0.75; 30 3.4,-0.25; 31 3.4,0.25; 32 3.4,0.75; 33 3.4,1.25; 34 3.4,1.75; 35 3.4,2.25; 36 3.4,2.75 | smd 0.24 x 0.6: 13 -2.75,-3.4; 14 -2.25,-3.4; 15 -1.75,-3.4; 16 -1.25,-3.4; 17 -0.75,-3.4; 18 -0.25,-3.4; 19 0.25,-3.4; 20 0.75,-3.4; 21 1.25,-3.4; 22 1.75,-3.4; 23 2.25,-3.4; 24 2.75,-3.4; 37 2.75,3.4; 38 2.25,3.4; 39 1.75,3.4; 40 1.25,3.4; 41 0.75,3.4; 42 0.25,3.4; 43 -0.25,3.4; 44 -0.75,3.4; 45 -1.25,3.4; 46 -1.75,3.4; 47 -2.25,3.4; 48 -2.75,3.4 | smd 4.1 x 4.1: 49 0,0
LGA-138_NSMD = smd 1.6 x 1.6: A1 5.5,5.5; A13 5.5,-5.5; N1 -5.5,5.5; N13 -5.5,-5.5 | smd 0.6 x 0.6: A3 6,4; A4 6,3; A5 6,2; A6 6,1; A7 6,0; A8 6,-1; A9 6,-2; A10 6,-3; A11 6,-4; B3 5,4; B4 5,3; B5 5,2; B6 5,1; B7 5,0; B8 5,-1; B9 5,-2; B10 5,-3; B11 5,-4; C1 4,6; C2 4,5; C3 4,4; C4 4,3; C5 4,2; C6 4,1; C7 4,0; C8 4,-1; C9 4,-2; C10 4,-3; C11 4,-4; C12 4,-5; C13 4,-6; D1 3,6; D2 3,5; D3 3,4; D4 3,3; D5 3,2; D6 3,1; D7 3,0; D8 3,-1; D9 3,-2; D10 3,-3; D11 3,-4; D12 3,-5; D13 3,-6; E1 2,6; E2 2,5; E3 2,4; E4 2,3; E5 2,2; E6 2,1; E7 2,0; E8 2,-1; E9 2,-2; E10 2,-3; E11 2,-4; E12 2,-5; E13 2,-6; F1 1,6; F2 1,5; F3 1,4; F4 1,3; F10 1,-3; F11 1,-4; F12 1,-5; F13 1,-6; G1 0,6; G2 0,5; G3 0,4; G4 0,3; G10 0,-3; G11 0,-4; G12 0,-5; G13 0,-6; H1 -1,6; H2 -1,5; H3 -1,4; H4 -1,3; H10 -1,-3; H11 -1,-4; H12 -1,-5; H13 -1,-6; J1 -2,6; J2 -2,5; J3 -2,4; J4 -2,3; J5 -2,2; J6 -2,1; J7 -2,0; J8 -2,-1; J9 -2,-2; J10 -2,-3; J11 -2,-4; J12 -2,-5; J13 -2,-6; K1 -3,6; K2 -3,5; K3 -3,4; K4 -3,3; K5 -3,2; K6 -3,1; K7 -3,0; K8 -3,-1; K9 -3,-2; K10 -3,-3; K11 -3,-4; K12 -3,-5; K13 -3,-6; L1 -4,6; L2 -4,5; L3 -4,4; L4 -4,3; L5 -4,2; L6 -4,1; L7 -4,0; L8 -4,-1; L9 -4,-2; L10 -4,-3; L11 -4,-4; L12 -4,-5; L13 -4,-6; M3 -6,4; M4 -5,3; M5 -5,2; M6 -5,1; M7 -5,0; M8 -5,-1; M9 -5,-2; M10 -5,-3; M11 -5,-4; N3 -5,4; N4 -6,3; N5 -6,2; N6 -6,1; N7 -6,0; N8 -6,-1; N9 -6,-2; N10 -6,-3; N11 -6,-4
BMI088 = smd 0.25 x 0.675: 1 -1.5,1.262; 2 -1,1.262; 3 -0.5,1.262; 4 0,1.262; 5 0.5,1.262; 6 1,1.262; 7 1.5,1.262; 9 1.5,-1.262; 10 1,-1.262; 11 0.5,-1.262; 12 0,-1.262; 13 -0.5,-1.262; 14 -1,-1.262; 15 -1.5,-1.262 | smd 0.675 x 0.25: 8 2.013,0; 16 -2.013,0
VQFN-32 = smd 0.6 x 0.25: 1 -2.4,1.75; 2 -2.4,1.25; 3 -2.4,0.75; 4 -2.4,0.25; 5 -2.4,-0.25; 6 -2.4,-0.75; 7 -2.4,-1.25; 8 -2.4,-1.75; 17 2.4,-1.75; 18 2.4,-1.25; 19 2.4,-0.75; 20 2.4,-0.25; 21 2.4,0.25; 22 2.4,0.75; 23 2.4,1.25; 24 2.4,1.75 | smd 0.25 x 0.6: 9 -1.75,-2.4; 10 -1.25,-2.4; 11 -0.75,-2.4; 12 -0.25,-2.4; 13 0.25,-2.4; 14 0.75,-2.4; 15 1.25,-2.4; 16 1.75,-2.4; 25 1.75,2.4; 26 1.25,2.4; 27 0.75,2.4; 28 0.25,2.4; 29 -0.25,2.4; 30 -0.75,2.4; 31 -1.25,2.4; 32 -1.75,2.4 | smd 3.7 x 3.7: 33 0,0
NLCV32T-100K-EFRD = smd 1.2 x 2: 1 -1.6,0; 2 1.6,0
XAL7030-472 = smd 1.58 x 6.5: 1 -2.26,0; 2 2.26,0
XAL50XX = smd 1.18 x 4.7: 1 -1.655,0; 2 1.655,0
L1210 = smd 0.8 x 2.5: 1 -1.4,0; 2 1.4,0
XAL4020 = smd 0.98 x 3.4: 1 -1.185,0; 2 1.185,0
L201610 = smd 0.6 x 1.6: 1 -0.9,0; 2 0.9,0
1812CAN = smd 1 x 1.15: 1 -1.84,-0.865; 2 1.84,-0.865; 3 1.84,0.865; 4 -1.84,0.865
WP-SMRA_746630200 = smd 2.45 x 2.95: 1 -1.35,-1.6; 2 -1.35,1.6; 3 1.35,1.6; 4 1.35,-1.6
WA-SMST_9774050943 = smd 5.3 x 5.3: 1 0,0 | hole 3: 0,0
VSON-4 = smd 0.55 x 1: 1 0.4,0.875; 2 -0.4,0.875; 3 -0.4,-0.875; 4 0.4,-0.875
SO-8L = smd 0.82 x 0.41: 1 -2.75,1.905; 2 -2.75,0.635; 3 -2.75,-0.635; 4 -2.75,-1.905 | smd 4.14 x 4.061: 5 1.02,0 | smd 0.51 x 5: EP1 2.835,0 | smd 0.61 x 5.251: EP2 -0.035,0
SOT23-3 = smd 1 x 1.4: 1 -0.95,-1.1; 2 0.95,-1.1; 3 0,1.1
POWERDI3333-8 = smd 0.42 x 0.7: 1 -0.975,-1.5; 2 -0.325,-1.5; 3 0.325,-1.5; 4 0.975,-1.5 | smd 0.42 x 0.74: 5 0.975,1.48; 6 0.325,1.48; 7 -0.325,1.48; 8 -0.975,1.48 | smd 2.37 x 1.71: EP 0,0.455
SOT-523 = smd 0.4 x 0.51: 1 -0.5,-0.645; 2 0.5,-0.645; 3 0,0.645
R1206 = smd 1.3 x 1.6: 1 -1.524,0; 2 1.524,0
R0805 = smd 1.2 x 1.3: 1 -1.016,0; 2 1.016,0
R0402 = smd 0.5 x 0.5: 1 -0.508,0; 2 0.508,0
MELF0207 = smd 1.7 x 2.4: 1 -2.45,0; 2 2.45,0
R0603 = smd 0.8 x 0.8: 1 -0.762,0; 2 0.762,0
HX5008NL = smd 1.905 x 0.64: 1 -8.828,5.445; 2 -8.828,4.455; 3 -8.828,3.465; 4 -8.828,2.475; 5 -8.828,1.485; 6 -8.828,0.495; 7 -8.828,-0.495; 8 -8.828,-1.485; 9 -8.828,-2.475; 10 -8.828,-3.465; 11 -8.828,-4.455; 12 -8.828,-5.445; 13 8.828,-5.445; 14 8.828,-4.455; 15 8.828,-3.465; 16 8.828,-2.475; 17 8.828,-1.485; 18 8.828,-0.495; 19 8.828,0.495; 20 8.828,1.485; 21 8.828,2.475; 22 8.828,3.465; 23 8.828,4.455; 24 8.828,5.445
3.2X1.5 = smd 1.1 x 1.9: 1 -1.25,0; 2 1.25,0
2.5X2 = smd 1 x 1.1: 1 0.75,-0.95; 2 0.75,0.95; 3 -0.75,0.95; 4 -0.75,-0.95
ECS-2520MVQ = smd 0.9 x 0.8: 1 -0.925,-0.725; 2 0.925,-0.725; 3 0.95,0.725; 4 -0.925,0.725
3.2X2.5 = smd 1.2 x 1.4: 1 0.95,-1.1; 2 0.95,1.1; 3 -0.95,1.1; 4 -0.95,-1.1

## Placement (x,y rotation side)
C1  1nF,10%,1206,2KV  [C1206]  19.4,62.5 180 top
C2  10uF,10%,1206,35V  [C1206]  65.9,169.3 90 top
C3  100nF,10%,0603,100V  [C0603]  64.1,169.9 90 top
C4  1uF,10%,0402,25V  [C0402]  70.1,35.9 270 top
C5  2.2uF,10%,0603,16V  [C0603]  61.8,31.6 270 top
C6  10uF,10%,2220,100V  [C2220K]  56.4,42.2 0 bottom
C7  10uF,10%,2220,100V  [C2220K]  56.4,35.7 0 bottom
C8  10uF,10%,2220,100V  [C2220K]  56.4,29.5 0 bottom
C9  4.7uF,20%,1206,100V  [C1206]  58.7,23.3 90 bottom
C10  4.7uF,20%,1206,100V  [C1206]  66.3,23.3 270 bottom
C11  100nF,10%,0603,100V  [C0603]  65.4,24.2 0 top
C12  56nF,10%,0402,16V  [C0402]  60,21 180 top
C13  390pF,10%,0402,50V  [C0402]  59.5,16.5 90 top
C14  8.2nF,10%,0402,16V  [C0402]  60,20 180 top
C15  820pF,10%,0402,50V  [C0402]  60,19 180 top
C16  100nF,10%,0603,100V  [C0603]  66.9,22 270 top
C17  6.8pF,5%,0603,100V  [C0603]  68.3,19.3 270 top
C18  2.2uF,10%,0603,16V  [C0603]  66.9,19.3 270 top
C19  6.8uF,20%,1210,50V  [C1210]  76.3,13 0 bottom
C20  6.8uF,20%,1210,50V  [C1210]  76.3,16.1 0 bottom
C21  47uF,10%,1210,10V  [C1210]  60.1,15.4 180 bottom
C22  47uF,10%,1210,10V  [C1210]  60.1,18.6 180 bottom
C23  2.7nF,5%,0603,50V  [C0603]  60.7,12.7 90 top
C24  2.7nF,5%,0603,50V  [C0603]  64.2,11.8 90 bottom
C25  120pF,5%,0402,50V  [C0402]  62.5,12.7 180 bottom
C26  100nF,10%,0402,50V  [C0402]  57.5,9.3 0 bottom
C27  NOPOP  [C0402]  62,12.2 90 top
C28  47uF,10%,1210,10V  [C1210]  61.6,5.8 90 bottom
C29  10uF,10%,0805,16V  [C0805]  95.9,36.9 180 bottom
C30  10uF,10%,0805,16V  [C0805]  88.6,31.4 270 bottom
C31  22uF,10%,1206,16V  [C1206]  88.2,44 90 top
C32  10uF,10%,0805,16V  [C0805]  95.9,38.9 180 bottom
C33  2.2uF,10%,0603,16V  [C0603]  91.7,44 90 bottom
C34  1uF,10%,0603,16V  [C0603]  87.9,40.9 0 top
C35  10uF,10%,0805,16V  [C0805]  82.5,36.9 0 bottom
C36  2.2uF,10%,0603,16V  [C0603]  93.1,44 90 bottom
C37  2.2uF,10%,0603,16V  [C0603]  86.1,44 90 bottom
C38  10uF,10%,0805,16V  [C0805]  82.5,38.9 0 bottom
C39  2.2uF,10%,0603,16V  [C0603]  90.3,44 90 bottom
C40  2.2uF,10%,0603,16V  [C0603]  86.1,44 90 top
C41  2.2uF,10%,0603,16V  [C0603]  88.9,44 90 bottom
C42  470nF,10%,0402,16V  [C0402]  87.9,36.1 0 top
C43  12pF,5%,0402,50V  [C0402]  86.4,31.4 0 bottom
C44  12pF,5%,0402,50V  [C0402]  84.4,31.4 180 bottom
C45  100nF,10%,0402,50V  [C0402]  82.6,30.9 270 bottom
C46  2.2uF,10%,0603,16V  [C0603]  87.5,44 90 bottom
C47  2.2uF,10%,0603,16V  [C0603]  90.3,44 90 top
C48  2.2uF,10%,0603,16V  [C0603]  91.7,44 90 top
C49  2.2uF,10%,0603,16V  [C0603]  93.1,44 90 top
C50  47uF,10%,1210,10V  [C1210]  95.9,30.1 90 bottom
C51  47uF,10%,1210,10V  [C1210]  75.7,35.3 90 bottom
C52  47uF,10%,1210,10V  [C1210]  92,29 0 bottom
C53  47uF,10%,1210,10V  [C1210]  78.8,35.3 90 bottom
C54  47uF,10%,1210,10V  [C1210]  96,24.6 270 bottom
C55  10uF,20%,0603,4V,3L  [NFM18HC106]  59.9,158.3 270 top
C56  47uF,10%,1210,10V  [C1210]  92,26 0 bottom
C57  10uF,20%,0603,4V,3L  [NFM18HC106]  76.1,67.4 180 bottom
C58  10uF,20%,0603,4V,3L  [NFM18HC106]  95.7,77.6 90 bottom
C59  10uF,20%,0603,4V,3L  [NFM18HC106]  78.7,67.4 0 bottom
C60  47uF,10%,1210,10V  [C1210]  100.4,41.7 180 bottom
C61  47uF,10%,1210,10V  [C1210]  100.4,44.8 180 bottom
C62  47uF,10%,1210,10V  [C1210]  72.3,43.1 90 bottom
C63  10uF,20%,0603,4V,3L  [NFM18HC106]  55.3,115.8 0 top
C64  47uF,10%,1210,10V  [C1210]  72.3,38.4 270 bottom
C65  47uF,10%,1210,10V  [C1210]  78.5,43.1 90 bottom
C66  10uF,20%,0603,4V,3L  [NFM18HC106]  52.7,100.3 0 bottom
C67  47uF,10%,1210,10V  [C1210]  75.4,43.1 90 bottom
C68  47uF,10%,1210,10V  [C1210]  100.4,34.1 180 bottom
C69  10uF,20%,0603,4V,3L  [NFM18HC106]  95.4,68.4 90 top
C70  47uF,10%,1210,10V  [C1210]  100.4,31 180 bottom
C71  47uF,10%,1210,10V  [C1210]  100.4,28 180 bottom
C72  10uF,20%,0603,4V,3L  [NFM18HC106]  57.8,159.9 90 top
C73  47uF,10%,1210,10V  [C1210]  100.4,25 180 bottom
C74  10uF,20%,0603,4V,3L  [NFM18HC106]  57.3,126.8 270 top
C75  10uF,20%,0603,4V,3L  [NFM18HC106]  71.3,127.8 270 top
C76  100nF,10%,0402,50V  [C0402]  97.7,8.8 270 top
C77  100nF,10%,0402,50V  [C0402]  93.1,5.3 90 bottom
C78  100nF,10%,0402,50V  [C0402]  97.7,5.4 90 top
C79  4.7uF,20%,1206,100V  [C1206]  88.5,11.6 270 bottom
C80  4.7uF,20%,1206,100V  [C1206]  79.9,10.7 270 bottom
C81  100nF,10%,0603,100V  [C0603]  81.7,10.7 270 bottom
C82  100nF,10%,0603,100V  [C0603]  86.7,10.7 270 bottom
C83  NOPOP  [C0402]  91.5,14.2 0 top
C84  4.7nF,20%,0402,100V  [C0402]  85.7,12 0 top
C85  10pF,1%,0402,50V  [C0402]  86.2,13.5 270 top
C86  100uF,20%,1210,6.3V  [C1210]  87.6,6.7 90 bottom
C87  47uF,10%,1210,10V  [C1210]  82.6,17.3 270 bottom
C88  10uF,20%,0603,10V  [C0603]  95.1,21.6 180 bottom
C89  10uF,20%,0603,10V  [C0603]  86.7,18.3 270 bottom
C90  100nF,10%,0603,100V  [C0603]  85.1,18.3 270 bottom
C91  47uF,10%,1210,10V  [C1210]  67.5,14.5 0 bottom
C92  100nF,10%,0603,100V  [C0603]  66.5,12 0 bottom
C93  NOPOP  [C0402]  69.9,14 0 top
C94  1uF,10%,0603,16V  [C0603]  90,22.1 270 top
C95  3.3nF,10%,0402,50V  [C0402]  90,17.8 90 top
C96  2.7nF,5%,0603,50V  [C0603]  88.8,15.2 270 top
C97  22pF,0.25pF,0402,50V  [C0402]  90.5,15.3 180 top
C98  3.3nF,10%,0402,50V  [C0402]  73.4,7.8 180 bottom
C99  8.2nF,10%,0402,16V  [C0402]  71.4,12.5 270 top
C100  22pF,0.25pF,0402,50V  [C0402]  72.9,12 180 top
C101  100nF,10%,0402,50V  [C0402]  89.5,23 180 bottom
C102  100nF,10%,0402,50V  [C0402]  68.7,8.5 0 bottom
C103  220nF,10%,0402,35V  [C0402]  92.5,19.3 180 top
C104  10uF,20%,0603,10V  [C0603]  95.7,19.4 270 bottom
C105  10uF,20%,0603,10V  [C0603]  94.4,19.4 270 bottom
C106  330pF,10%,0402,50V  [C0402]  92.5,17.3 180 top
C107  NOPOP  [C0402]  73.9,10.3 90 bottom
C108  100uF,20%,1210,6.3V  [C1210]  66.1,5.8 90 bottom
C109  100uF,20%,1210,6.3V  [C1210]  82.6,23.5 270 bottom
C110  10uF,10%,1206,35V  [C1206]  71.2,167 180 bottom
C111  10uF,10%,1206,35V  [C1206]  70.5,158.5 180 bottom
C112  10uF,10%,1206,35V  [C1206]  74.1,161.8 270 bottom
C113  10uF,10%,0805,16V  [C0805]  69.5,165.1 270 top
C114  10uF,10%,0805,16V  [C0805]  66.7,164.4 90 top
C115  1uF,10%,0402,25V  [C0402]  72.2,161.8 180 top
C116  2.2uF,10%,0603,16V  [C0603]  69.6,160.6 90 top
C117  100nF,10%,0402,50V  [C0402]  71.7,165.4 180 bottom
C118  2.2uF,10%,0603,16V  [C0603]  67.2,158.8 180 top
C119  10uF,10%,0805,16V  [C0805]  75.6,165.2 0 bottom
C120  10uF,10%,0805,16V  [C0805]  74.1,157.4 90 bottom
C121  10uF,10%,0805,16V  [C0805]  74.6,166 90 top
C122  10uF,10%,0805,16V  [C0805]  74.6,168 270 bottom
C123  2.2uF,10%,0603,16V  [C0603]  78.7,30.9 180 top
C124  NOPOP  [C0402]  76.4,30.6 270 top
C125  NOPOP  [C0402]  79.2,26.6 0 bottom
C126  2.2uF,10%,0603,16V  [C0603]  78.7,29.2 180 top
C127  47uF,20%,0603,4V  [C0603]  63.8,130.3 180 top
C128  10uF,20%,0402,4V  [C0402]  71.3,129.3 180 top
C129  330uF,20%,1210,2.5V  [C1210]  68.6,140.3 270 top
C130  100uF,20%,0805,4V  [C0805]  66.2,139.8 270 top
C131  100uF,20%,0805,4V  [C0805]  63.3,132.8 90 top
C132  100uF,20%,0805,4V  [C0805]  57.3,123.8 270 top
C133  100uF,20%,0805,4V  [C0805]  67.3,134.8 270 top
C134  470nF,10%,0402,16V  [C0402]  70.8,124.8 270 top
C135  4.7uF,20%,0402,10V  [C0402]  61.8,114.8 90 top
C136  100uF,20%,0805,4V  [C0805]  65.3,132.8 90 top
C137  100nF,10%,0402,50V  [C0402]  69.8,124.8 270 top
C138  4.7uF,20%,0402,10V  [C0402]  65.8,110.8 270 top
C139  4.7uF,20%,0402,10V  [C0402]  63.8,114.8 270 top
C140  47uF,20%,0603,4V  [C0603]  74.8,124.8 0 top
C141  10uF,20%,0402,4V  [C0402]  67.8,126.8 270 top
C142  10uF,20%,0402,4V  [C0402]  79.8,127.8 90 top
C143  10uF,20%,0402,4V  [C0402]  74.3,133.3 0 top
C144  4.7uF,20%,0402,10V  [C0402]  61.3,137.3 0 top
C145  10uF,20%,0402,4V  [C0402]  59.3,121.3 180 top
C146  10uF,20%,0402,4V  [C0402]  83.8,132.8 270 top
C147  10uF,20%,0402,4V  [C0402]  60.3,127.3 180 top
C148  10uF,20%,0402,4V  [C0402]  74.3,132.3 180 top
C149  4.7uF,20%,0402,10V  [C0402]  58.3,138.3 180 top
C150  4.7uF,20%,0402,10V  [C0402]  59.8,133.8 90 top
C151  10uF,20%,0402,4V  [C0402]  61.8,129.8 270 top
C152  47uF,20%,0603,4V  [C0603]  81.8,134.8 0 top
C153  10uF,20%,0402,4V  [C0402]  74.8,128.8 90 top
C154  10uF,20%,0402,4V  [C0402]  60.3,125.3 180 top
C155  47uF,20%,0603,4V  [C0603]  66.3,124.8 0 top
C156  47uF,20%,0603,4V  [C0603]  70.5,135.3 270 top
C157  10uF,20%,0402,4V  [C0402]  70.3,133.3 180 top
C158  47uF,20%,0603,4V  [C0603]  66.8,131.3 270 top
C159  47uF,20%,0603,4V  [C0603]  69.1,135.3 270 top
C160  330uF,20%,1210,2.5V  [C1210]  58.7,130.2 180 top
C161  100uF,20%,0805,4V  [C0805]  54.3,130.8 0 top
C162  10uF,20%,0402,4V  [C0402]  74.3,117.3 0 top
C163  47uF,20%,0603,4V  [C0603]  74.3,114.3 90 top
C164  100uF,20%,0805,4V  [C0805]  62.6,139.8 270 top
C165  10uF,20%,0402,4V  [C0402]  74.3,118.3 0 top
C166  10uF,20%,0402,4V  [C0402]  77.3,119.3 180 top
C167  100uF,20%,0805,4V  [C0805]  60.8,139.8 270 top
C168  100uF,20%,0805,4V  [C0805]  54.3,110.7 180 top
C169  10uF,20%,0402,4V  [C0402]  78.8,116.8 90 top
C170  10uF,20%,0402,4V  [C0402]  72.3,118.3 0 top
C171  470nF,10%,0402,16V  [C0402]  76.8,116.8 270 top
C172  100uF,20%,0805,4V  [C0805]  64.4,139.8 270 top
C173  100nF,10%,0402,50V  [C0402]  75.8,117.8 270 top
C174  10uF,20%,0402,4V  [C0402]  78.8,120.8 270 top
C175  NOPOP  [C0402]  75.3,120.3 180 top
C176  10uF,20%,0402,4V  [C0402]  73.3,110.3 180 top
C177  10uF,20%,0402,4V  [C0402]  70.8,119.8 90 top
C178  10uF,20%,0402,4V  [C0402]  72.3,114.3 180 top
C179  100uF,20%,0805,4V  [C0805]  54.3,121.8 0 top
C180  10uF,20%,0402,4V  [C0402]  57.8,119.8 270 top
C181  10uF,20%,0402,4V  [C0402]  82.8,114.8 270 top
C182  100uF,20%,0805,4V  [C0805]  54.3,127.2 0 top
C183  100uF,20%,0805,4V  [C0805]  98.9,97.8 90 top
C184  100uF,20%,0805,4V  [C0805]  100.7,97.8 90 top
C185  10uF,20%,0402,4V  [C0402]  66.3,120.3 180 top
C186  100uF,20%,0805,4V  [C0805]  54.3,129 0 top
C187  10uF,20%,0402,4V  [C0402]  79.3,126.3 180 top
C188  100uF,20%,0805,4V  [C0805]  54.3,123.6 0 top
C189  100uF,20%,0805,4V  [C0805]  54.3,125.4 0 top
C190  100uF,20%,0805,4V  [C0805]  54.3,120 0 top
C191  33pF,5%,0402,50V  [C0402]  52.7,101.4 0 bottom
C192  100nF,10%,0402,50V  [C0402]  52.7,104.4 0 bottom
C193  100nF,10%,0402,50V  [C0402]  52.2,102.9 270 bottom
C194  22pF,0.25pF,0402,50V  [C0402]  73.3,120.3 0 top
C195  22pF,0.25pF,0402,50V  [C0402]  72.8,121.8 90 top
C196  100nF,10%,0402,50V  [C0402]  59.8,122.8 270 top
C197  100nF,10%,0402,50V  [C0402]  56.5,94.9 0 bottom
C198  100pF,5%,0402,50V  [C0402]  54.1,97.7 180 top
C199  100nF,10%,0402,50V  [C0402]  54.1,97.7 0 bottom
C200  NOPOP  [C0402]  56,99.6 270 bottom
C201  4.7uF,20%,0402,10V  [C0402]  97.2,141.3 180 top
C202  4.7uF,20%,0402,10V  [C0402]  95,141.3 0 top
C203  4.7uF,20%,0402,10V  [C0402]  101.2,137.3 0 top
C204  4.7uF,20%,0402,10V  [C0402]  97.2,130.9 180 top
C205  4.7uF,20%,0402,10V  [C0402]  95,130.9 0 top
C206  4.7uF,20%,0402,10V  [C0402]  101.2,126.9 0 top
C207  4.7uF,20%,0402,10V  [C0402]  91,133.3 0 top
C208  4.7uF,20%,0402,10V  [C0402]  93,133.3 0 top
C209  1uF,10%,0402,25V  [C0402]  91,141.3 0 top
C210  4.7uF,20%,0402,10V  [C0402]  91,122.9 0 top
C211  4.7uF,20%,0402,10V  [C0402]  93,122.9 0 top
C212  1uF,10%,0402,25V  [C0402]  91,130.9 0 top
C213  2.2uF,10%,0402,16V  [C0402]  93,141.3 0 top
C214  2.2uF,10%,0402,16V  [C0402]  93,137.3 180 top
C215  1uF,10%,0402,25V  [C0402]  101.2,133.3 0 top
C216  2.2uF,10%,0402,16V  [C0402]  93,130.9 0 top
C217  2.2uF,10%,0402,16V  [C0402]  93,126.8 180 top
C218  1uF,10%,0402,25V  [C0402]  101.2,122.9 0 top
C219  1uF,10%,0402,25V  [C0402]  97.2,133.3 180 top
C220  1uF,10%,0402,25V  [C0402]  91,137.3 0 top
C221  100nF,10%,0402,50V  [C0402]  99.2,141.3 0 top
C222  1uF,10%,0402,25V  [C0402]  97.2,122.9 0 top
C223  1uF,10%,0402,25V  [C0402]  91,126.8 0 top
C224  100nF,10%,0402,50V  [C0402]  99.2,130.9 0 top
C225  100nF,10%,0402,50V  [C0402]  101.2,141.3 0 top
C226  100nF,10%,0402,50V  [C0402]  97,137.3 0 top
C227  100nF,10%,0402,50V  [C0402]  101.2,130.9 0 top
C228  100nF,10%,0402,50V  [C0402]  97,126.8 0 top
C229  4.7uF,20%,0402,10V  [C0402]  97.2,120.5 180 top
C230  4.7uF,20%,0402,10V  [C0402]  95,120.5 0 top
C231  4.7uF,20%,0402,10V  [C0402]  101.2,116.5 0 top
C232  4.7uF,20%,0402,10V  [C0402]  97.2,110.1 180 top
C233  4.7uF,20%,0402,10V  [C0402]  95,110.1 0 top
C234  4.7uF,20%,0402,10V  [C0402]  101.2,106.1 0 top
C235  4.7uF,20%,0402,10V  [C0402]  91,112.5 0 top
C236  4.7uF,20%,0402,10V  [C0402]  93,112.5 0 top
C237  1uF,10%,0402,25V  [C0402]  91,120.5 0 top
C238  4.7uF,20%,0402,10V  [C0402]  91,102.1 0 top
C239  4.7uF,20%,0402,10V  [C0402]  93,102.1 0 top
C240  1uF,10%,0402,25V  [C0402]  91,110.1 0 top
C241  2.2uF,10%,0402,16V  [C0402]  93,120.5 0 top
C242  2.2uF,10%,0402,16V  [C0402]  93.2,116.5 180 top
C243  1uF,10%,0402,25V  [C0402]  101.2,112.5 0 top
C244  2.2uF,10%,0402,16V  [C0402]  93,110.1 0 top
C245  2.2uF,10%,0402,16V  [C0402]  93,106.1 180 top
C246  1uF,10%,0402,25V  [C0402]  101.2,102.1 0 top
C247  1uF,10%,0402,25V  [C0402]  97.2,112.5 0 top
C248  1uF,10%,0402,25V  [C0402]  91,116.5 0 top
C249  100nF,10%,0402,50V  [C0402]  99.2,120.5 0 top
C250  1uF,10%,0402,25V  [C0402]  97.2,102.1 0 top
C251  1uF,10%,0402,25V  [C0402]  91,106.1 0 top
C252  100nF,10%,0402,50V  [C0402]  99.2,110.1 0 top
C253  100nF,10%,0402,50V  [C0402]  101.2,120.5 0 top
C254  100nF,10%,0402,50V  [C0402]  97.2,116.5 0 top
C255  470nF,10%,0402,16V  [C0402]  95,142.3 0 top
C256  68nF,10%,0402,50V  [C0402]  95,137.3 180 top
C257  1uF,10%,0402,25V  [C0402]  74.5,104 0 bottom